# EAGLE schematic debug_backplane (EAGLE 8.3.1), part 1 of 2
AUTHOR: Joshua Adkins and Pat Pannuto; REV: D; TITLE: Signpost Debug Backplane

## Sheet 1 of 18: Controller Module & Misc
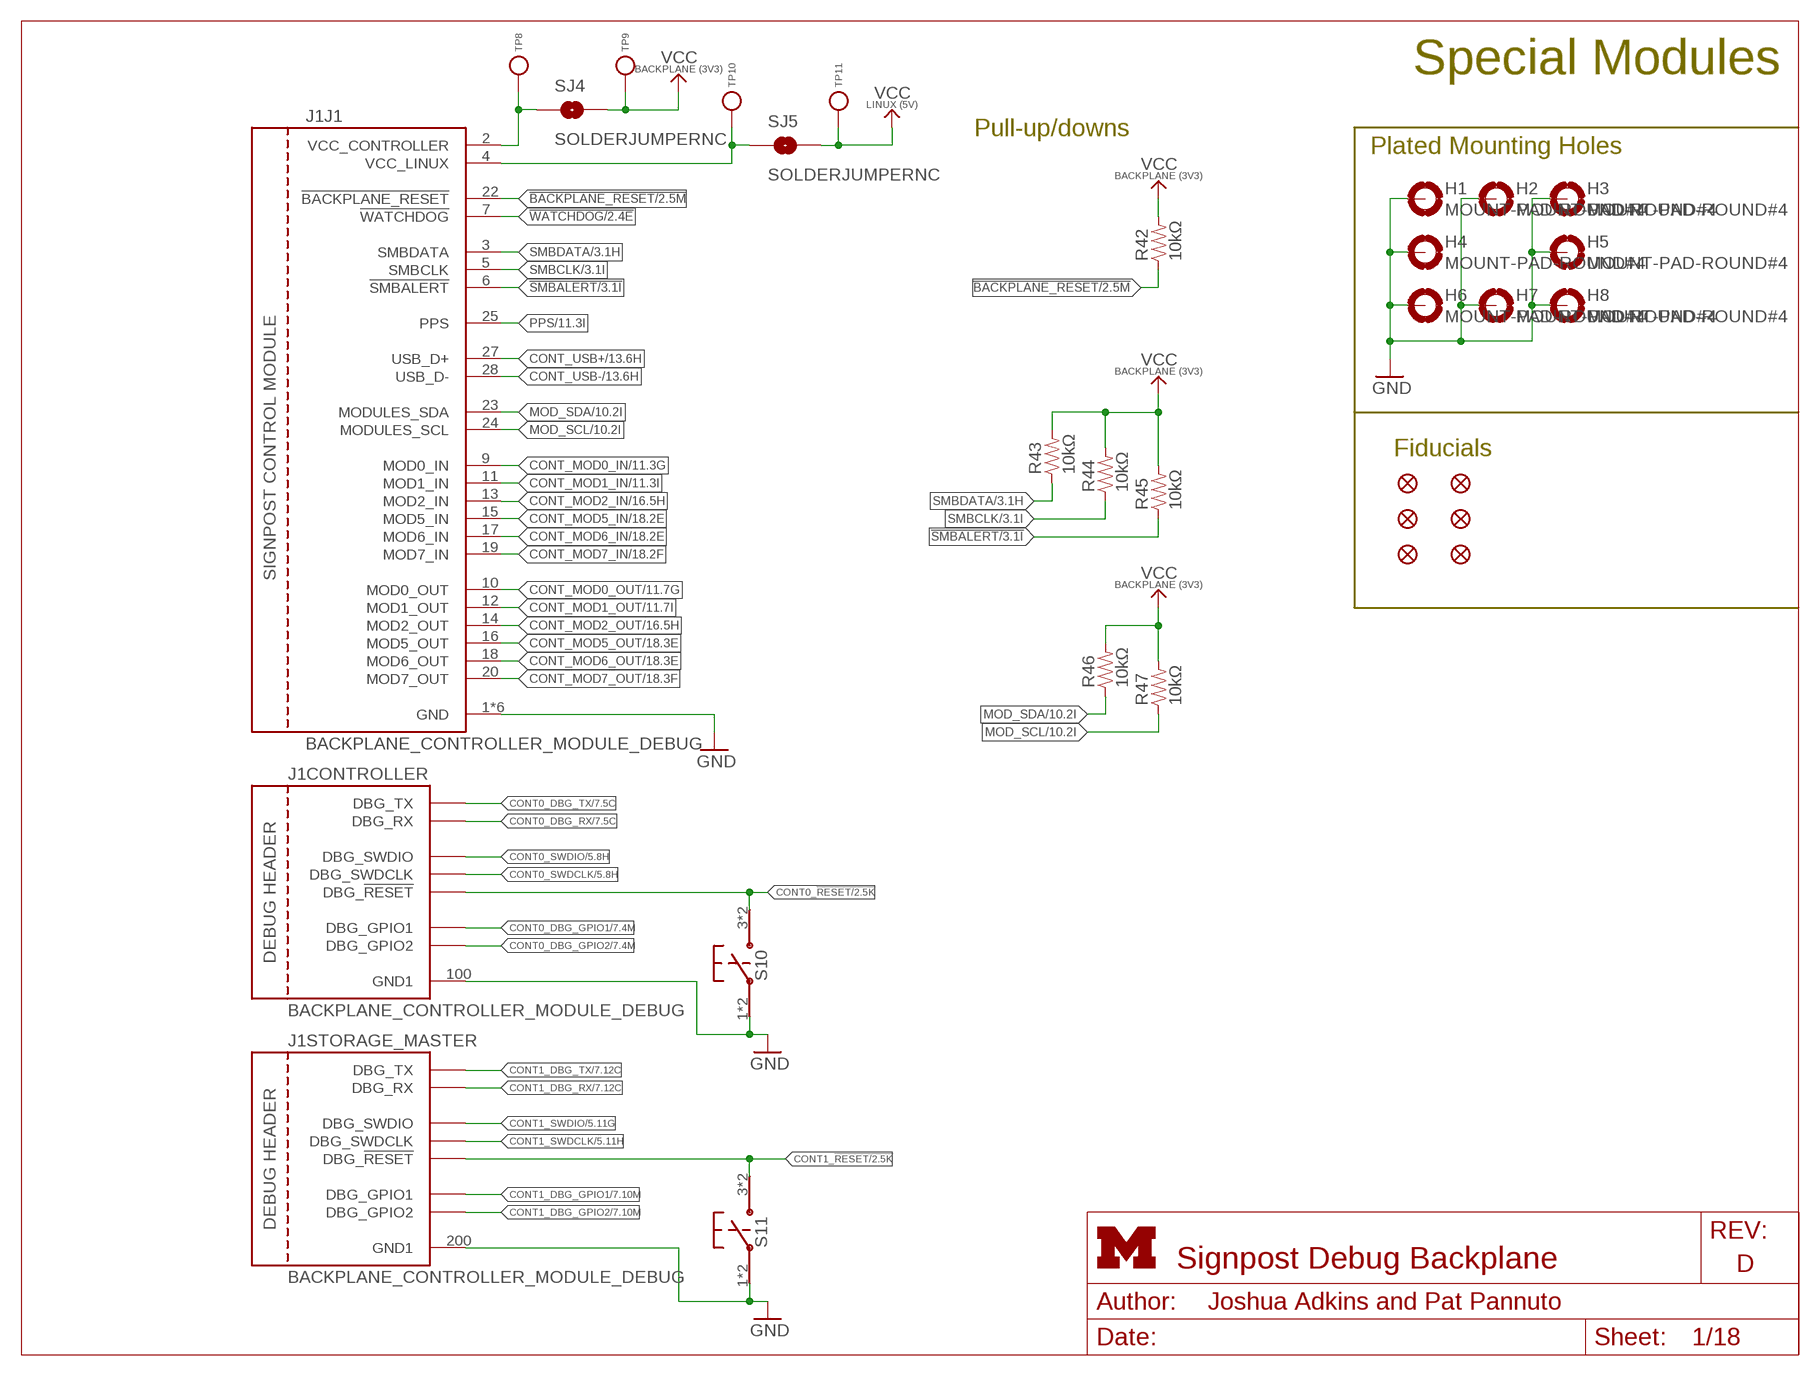
[diagram p0: schematic, sheet 1]
FRAME1 (LETTER_L_UMICH): HEIGHT: 8.5in; WIDTH: 11in

### Parts
H1  MOUNT-PAD-ROUND#4  [#4-PAD]
H2  MOUNT-PAD-ROUND#4  [#4-PAD]
H3  MOUNT-PAD-ROUND#4  [#4-PAD]
H4  MOUNT-PAD-ROUND#4  [#4-PAD]
H5  MOUNT-PAD-ROUND#4  [#4-PAD]
H6  MOUNT-PAD-ROUND#4  [#4-PAD]
H7  MOUNT-PAD-ROUND#4  [#4-PAD]
H8  MOUNT-PAD-ROUND#4  [#4-PAD]
J1  BACKPLANE_CONTROLLER_MODULE_DEBUG  [BACKPLANE_MODULE_20PIN_10PIN_DEBUG]
JP15  FIDUCIAL1X2  [FIDUCIAL-1X2]
JP21  FIDUCIAL1X2  [FIDUCIAL-1X2]
JP22  FIDUCIAL1X2  [FIDUCIAL-1X2]
JP23  FIDUCIAL1X2  [FIDUCIAL-1X2]
JP24  FIDUCIAL1X2  [FIDUCIAL-1X2]
JP25  FIDUCIAL1X2  [FIDUCIAL-1X2]
R42  10kΩ  RESISTOR0603_RES  [0603-RES]
R43  10kΩ  RESISTOR0603_RES  [0603-RES]
R44  10kΩ  RESISTOR0603_RES  [0603-RES]
R45  10kΩ  RESISTOR0603_RES  [0603-RES]
R46  10kΩ  RESISTOR0603_RES  [0603-RES]
R47  10kΩ  RESISTOR0603_RES  [0603-RES]
S10  PTS645SM43SMTR92  [PTS645]
S11  PTS645SM43SMTR92  [PTS645]
SJ4  SOLDERJUMPERNC  [SJ_2S]
SJ5  SOLDERJUMPERNC  [SJ_2S]
TP8  TEST_POINT_0.040IN  [TESTPOINT_0.040IN]
TP9  TEST_POINT_0.040IN  [TESTPOINT_0.040IN]
TP10  TEST_POINT_0.040IN  [TESTPOINT_0.040IN]
TP11  TEST_POINT_0.040IN  [TESTPOINT_0.040IN]

### Nets
!BACKPLANE_RESET: J1.22(J1:!BACKPLANE_RESET) R42.1 ; also sheet 2,9,12,18
!SMBALERT: J1.6(J1:!SMBALERT) R45.1 ; also sheet 3,18
!WATCHDOG: J1.7(J1:!WATCHDOG) ; also sheet 2,18
CONT0_!RESET: J1.105(CONTROLLER:DBG_!RESET) S10.3 S10.4 ; also sheet 2,5,18
CONT0_DBG_GPIO1: J1.101(CONTROLLER:DBG_GPIO1) ; also sheet 7,18
CONT0_DBG_GPIO2: J1.104(CONTROLLER:DBG_GPIO2) ; also sheet 7,18
CONT0_DBG_RX: J1.103(CONTROLLER:DBG_RX) ; also sheet 7,18
CONT0_DBG_TX: J1.102(CONTROLLER:DBG_TX) ; also sheet 7,18
CONT0_SWDCLK: J1.106(CONTROLLER:DBG_SWDCLK) ; also sheet 5
CONT0_SWDIO: J1.107(CONTROLLER:DBG_SWDIO) ; also sheet 5
CONT1_!RESET: J1.205(STORAGE_MASTER:DBG_!RESET) S11.3 S11.4 ; also sheet 2,5,18
CONT1_DBG_GPIO1: J1.201(STORAGE_MASTER:DBG_GPIO1) ; also sheet 7,18
CONT1_DBG_GPIO2: J1.204(STORAGE_MASTER:DBG_GPIO2) ; also sheet 7,18
CONT1_DBG_RX: J1.203(STORAGE_MASTER:DBG_RX) ; also sheet 7,18
CONT1_DBG_TX: J1.202(STORAGE_MASTER:DBG_TX) ; also sheet 7,18
CONT1_SWDCLK: J1.206(STORAGE_MASTER:DBG_SWDCLK) ; also sheet 5
CONT1_SWDIO: J1.207(STORAGE_MASTER:DBG_SWDIO) ; also sheet 5
CONT_MOD0_IN: J1.9(J1:MOD0_IN) ; also sheet 11,18
CONT_MOD0_OUT: J1.10(J1:MOD0_OUT) ; also sheet 11,18
CONT_MOD1_IN: J1.11(J1:MOD1_IN) ; also sheet 11,18
CONT_MOD1_OUT: J1.12(J1:MOD1_OUT) ; also sheet 11,18
CONT_MOD2_IN: J1.13(J1:MOD2_IN) ; also sheet 16,18
CONT_MOD2_OUT: J1.14(J1:MOD2_OUT) ; also sheet 16,18
CONT_MOD5_IN: J1.15(J1:MOD5_IN) ; also sheet 18
CONT_MOD5_OUT: J1.16(J1:MOD5_OUT) ; also sheet 18
CONT_MOD6_IN: J1.17(J1:MOD6_IN) ; also sheet 18
CONT_MOD6_OUT: J1.18(J1:MOD6_OUT) ; also sheet 18
CONT_MOD7_IN: J1.19(J1:MOD7_IN) ; also sheet 18
CONT_MOD7_OUT: J1.20(J1:MOD7_OUT) ; also sheet 18
CONT_USB+: J1.27(J1:USB_D+) ; also sheet 13
CONT_USB-: J1.28(J1:USB_D-) ; also sheet 13
GND: H1.B#4(MOUNT) H2.B#4(MOUNT) H3.B#4(MOUNT) H4.B#4(MOUNT) H5.B#4(MOUNT) H6.B#4(MOUNT) H7.B#4(MOUNT) H8.B#4(MOUNT) J1.1(J1:GND) J1.21(J1:GND) J1.100(CONTROLLER:GND1) J1.200(STORAGE_MASTER:GND1) J1.MNT1(J1:GND) J1.MNT2(J1:GND) J1.MNT3(J1:GND) J1.MNT4(J1:GND) S10.1 S10.2 S11.1 S11.2 ; also sheet 2,3,4,5,6,7,8,9,10,11,12,13,14,15,16,17,18
MOD_SCL: J1.24(J1:MODULES_SCL) R47.1 ; also sheet 10,16,18
MOD_SDA: J1.23(J1:MODULES_SDA) R46.1 ; also sheet 10,16,18
PPS: J1.25(J1:PPS) ; also sheet 11,16,18
SMBCLK: J1.5(J1:SMBCLK) R44.1 ; also sheet 3,9,12,17,18
SMBDATA: J1.3(J1:SMBDATA) R43.1 ; also sheet 3,9,12,17,18
VCC_BACKPLANE: R42.2 R43.2 R44.2 R45.2 R46.2 R47.2 SJ4.2 TP9.TESTPOINT ; also sheet 3,7,9,10,11,12,14,15,17,18
VCC_CONTROLLER_HEADER: J1.2(J1:VCC_CONTROLLER) SJ4.1 TP8.TESTPOINT
VCC_LINUX: SJ5.2 TP11.TESTPOINT ; also sheet 3,18
VCC_LINUX_HEADER: J1.4(J1:VCC_LINUX) SJ5.1 TP10.TESTPOINT

### Notes on the sheet
- Special Modules
- Pull-up/downs
- Plated Mounting Holes
- Fiducials

## Sheet 2 of 18: Watchdog & Reset Network
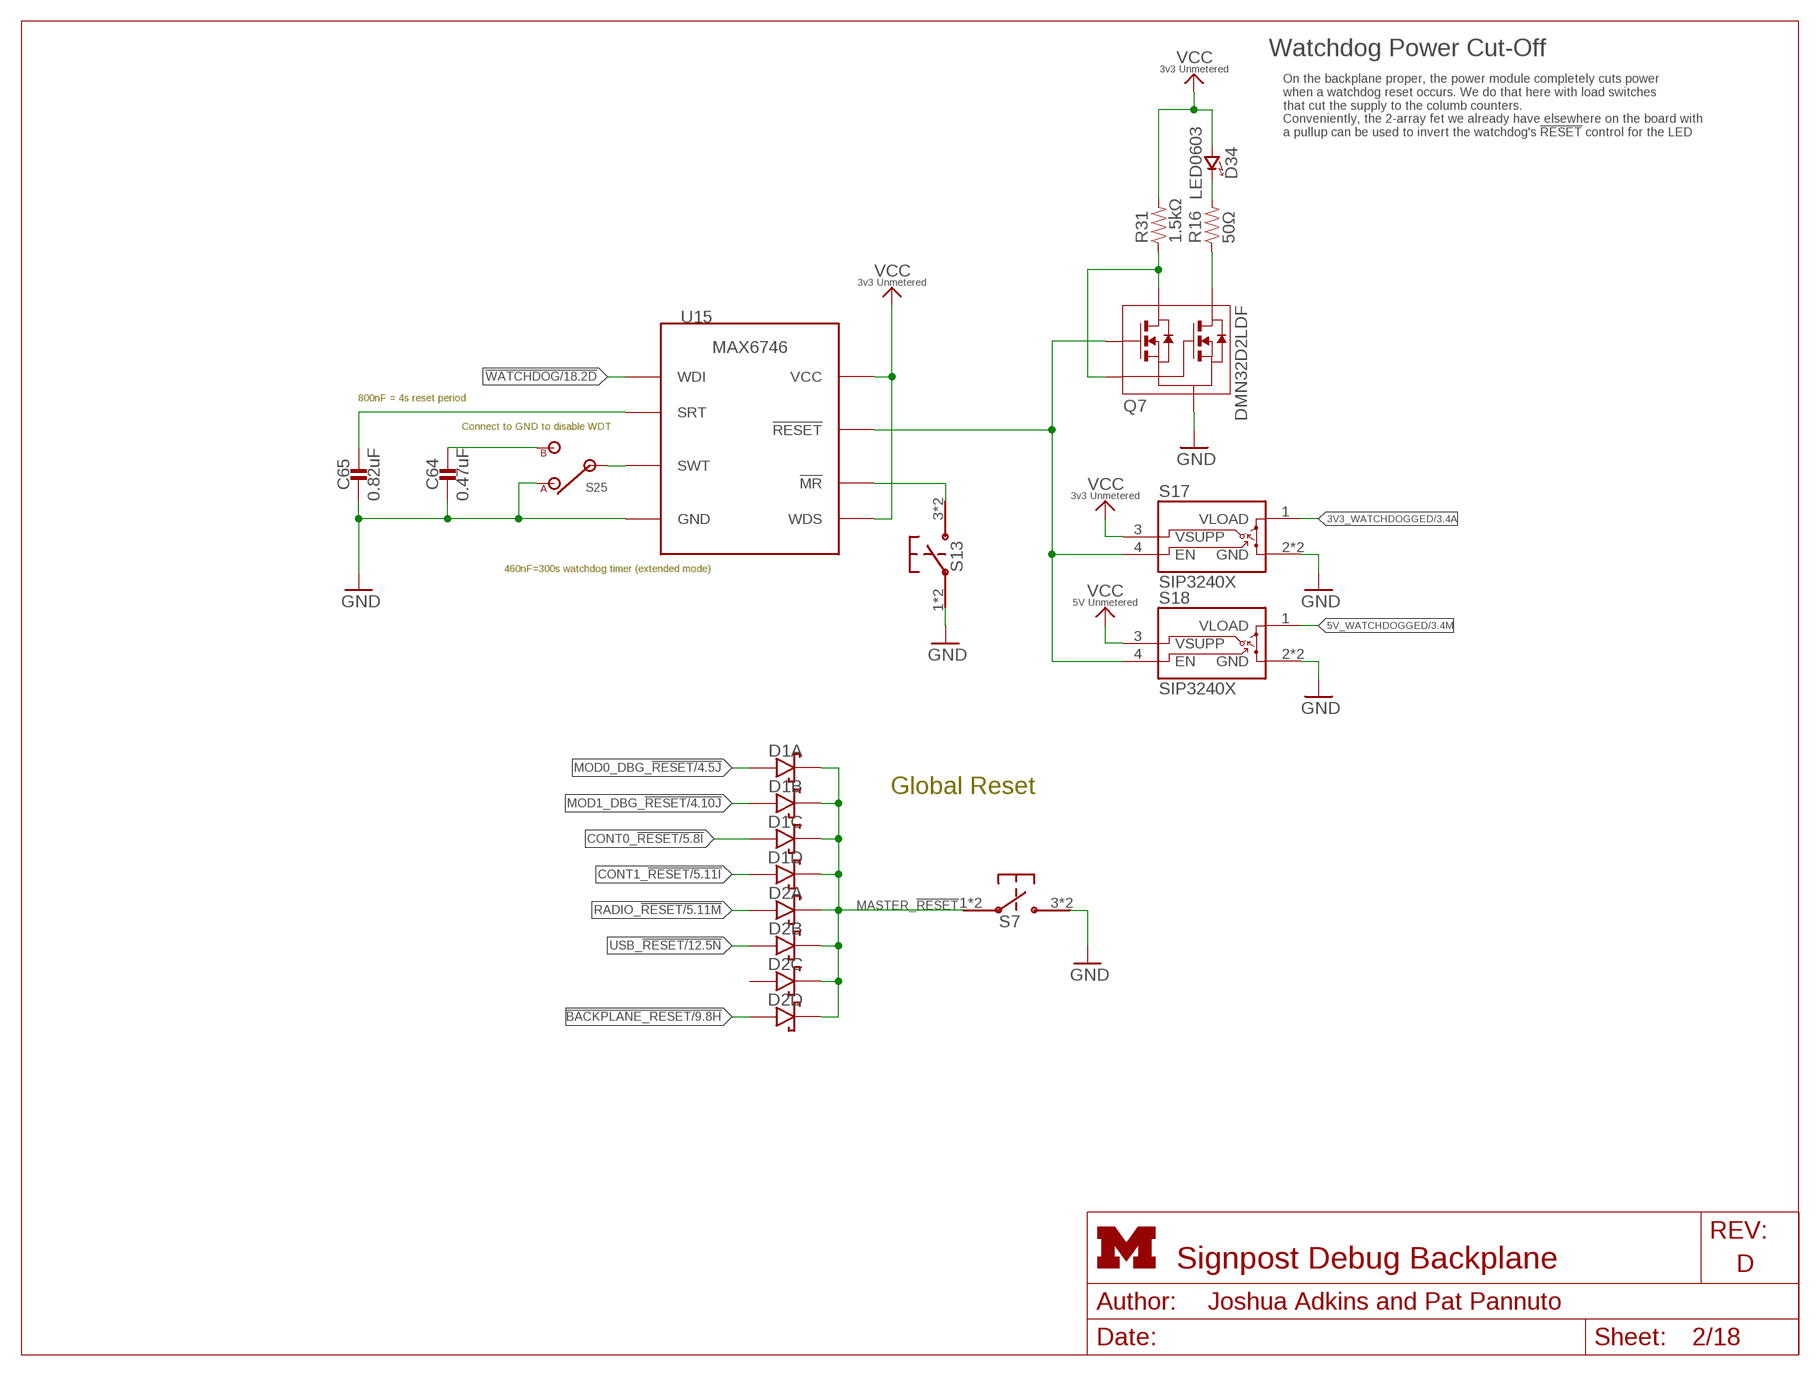
[diagram p1: schematic, sheet 2]
FRAME18 (LETTER_L_UMICH): HEIGHT: 8.5in; WIDTH: 11in

### Parts
C64  0.47uF  CAPACITOR0603_CAP  [0603_CAP]
C65  0.82uF  CAPACITOR0603_CAP  [0603_CAP]
D1  DIODE_SCHOTTKY_ARRAY-4HMD8  [HMD8]
D2  DIODE_SCHOTTKY_ARRAY-4HMD8  [HMD8]
D34  LED0603  [LED-0603]
Q7  DMN32D2LDF  [SOT353]
R16  50Ω  RESISTOR0603_RES  [0603-RES]
R31  1.5kΩ  RESISTOR0603_RES  [0603-RES]
S7  PTS645SM43SMTR92  [PTS645]
S13  PTS645SM43SMTR92  [PTS645]
S17  SIP3240X  [TDFN4]
S18  SIP3240X  [TDFN4]
S25  TE_SSA12/SPDT  [TE_SSA12/SPDT]
U15  MAX6746  [SOT-23-8]

### Nets
3V3_UNMETERED: D34.A(ANODE) R31.2 S17.3(VSUPP) U15.5(WDS) U15.8(VCC) ; supply symbol labelled VCC_3V3_UNMETERED ; also sheet 3,5,6,7,8,9,13,16,18
3V3_WATCHDOGGED: S17.1(VLOAD) ; also sheet 3
5V_UNMETERED: S18.3(VSUPP) ; supply symbol labelled VCC_5V_UNMETERED ; also sheet 3,6,7,16,18
5V_WATCHDOGGED: S18.1(VLOAD) ; also sheet 3
!BACKPLANE_RESET: D2.4A(D:ANODE) ; also sheet 1,9,12,18
!WATCHDOG: U15.6(WDI) ; also sheet 1,18
CONT0_!RESET: D1.3A(C:ANODE) ; also sheet 1,5,18
CONT1_!RESET: D1.4A(D:ANODE) ; also sheet 1,5,18
GND: C64.2 C65.2 Q7.S S7.3 S7.4 S13.1 S13.2 S17.2(GND) S17.PAD(GND) S18.2(GND) S18.PAD(GND) S25.1(A) U15.4(GND) ; also sheet 1,3,4,5,6,7,8,9,10,11,12,13,14,15,16,17,18
MASTER_!RESET: D1.1K(A:CATHODE) D1.2K(B:CATHODE) D1.3K(C:CATHODE) D1.4K(D:CATHODE) D2.1K(A:CATHODE) D2.2K(B:CATHODE) D2.3K(C:CATHODE) D2.4K(D:CATHODE) S7.1 S7.2
MOD0_DBG_!RESET: D1.1A(A:ANODE) ; also sheet 4,5,18
MOD1_DBG_!RESET: D1.2A(B:ANODE) ; also sheet 4,5,18
N$65: C65.1 U15.3(SRT)
N$78: Q7.D1 Q7.G2 R31.1
N$79: S13.3 S13.4 U15.1(!MR)
N$80: D34.C(CATHODE) R16.2
N$82: Q7.D2 R16.1
RADIO_!RESET: D2.1A(A:ANODE) ; also sheet 5,16
USB_!RESET: D2.2A(B:ANODE) ; also sheet 12,18
WATCHDOG_!RESET: Q7.G1 S17.4(EN) S18.4(EN) U15.7(!RESET)
WDT_CTRL: S25.IN U15.2(SWT)
WDT_ON: C64.1 S25.2(B)
Unconnected: D2.3A(C:ANODE)

### Notes on the sheet
- Watchdog Power Cut-Off
- On the backplane proper, the power module completely cuts power
  when a watchdog reset occurs. We do that here with load switches
  that cut the supply to the columb counters.
  Conveniently, the 2-array fet we already have elsewhere on the board with
  a pullup can be used to invert the watchdog's !RESET! control for the LED
- 800nF = 4s reset period
- Connect to GND to disable WDT
- 460nF=300s watchdog timer (extended mode)
- Global Reset

## Sheet 3 of 18: Power Module
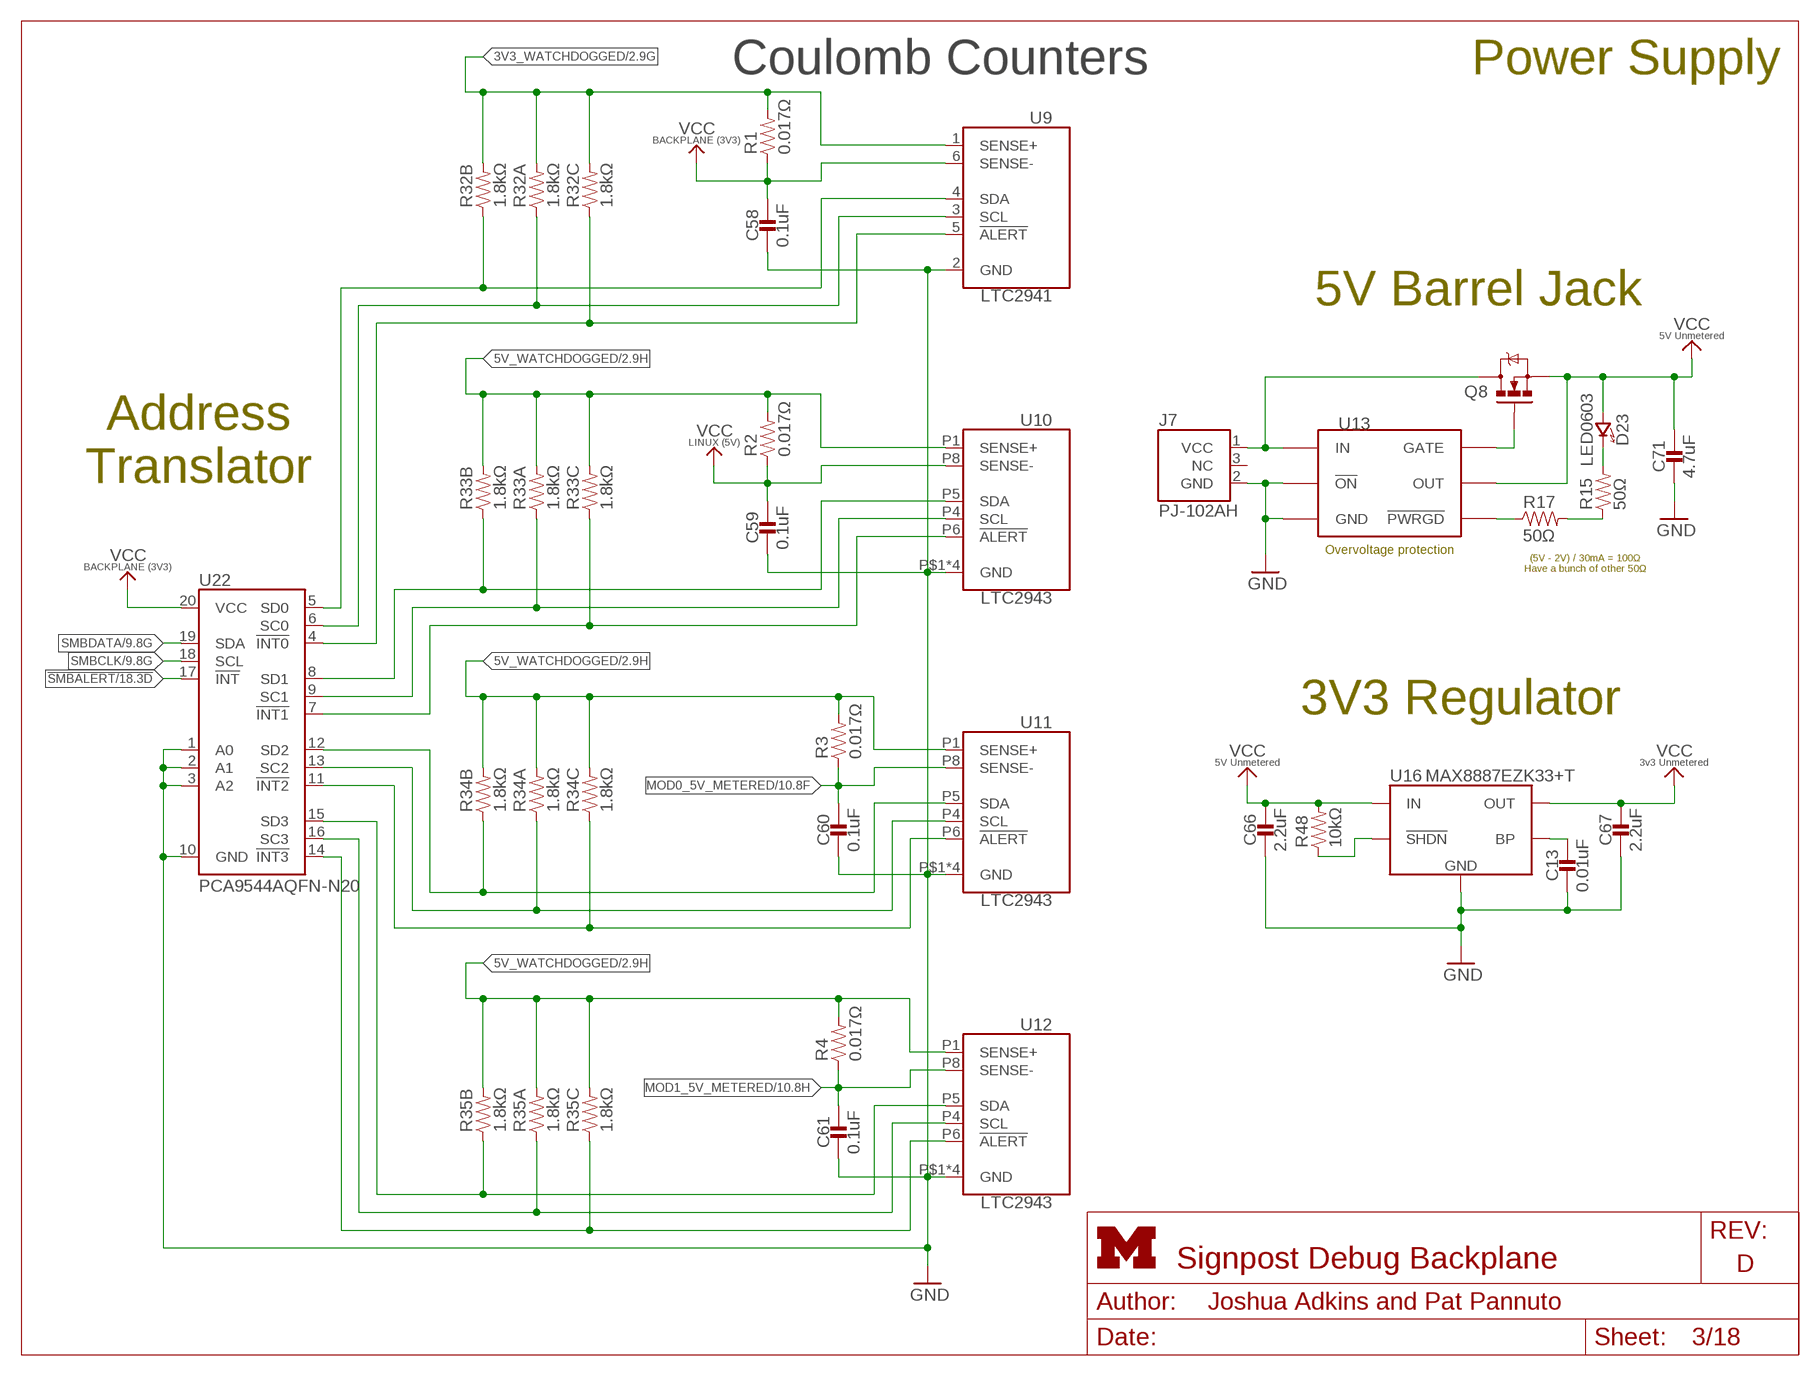
[diagram p2: schematic, sheet 3]
FRAME10 (LETTER_L_UMICH): HEIGHT: 8.5in; WIDTH: 11in

### Parts
C13  0.01uF  CAPACITOR0603_CAP  [0603_CAP]
C58  0.1uF  CAPACITOR0603_CAP  [0603_CAP]
C59  0.1uF  CAPACITOR0603_CAP  [0603_CAP]
C60  0.1uF  CAPACITOR0603_CAP  [0603_CAP]
C61  0.1uF  CAPACITOR0603_CAP  [0603_CAP]
C66  2.2uF  CAPACITOR0603_CAP  [0603_CAP]
C67  2.2uF  CAPACITOR0603_CAP  [0603_CAP]
C71  4.7uF  CAPACITOR0603_CAP  [0603_CAP]
D23  LED0603  [LED-0603]
J7  PJ-102AH  [PJ-102AH]
Q8  MOSFET-NCHANNELSMD  [SOT23-3]
R1  0.017Ω  RESISTOR0805_RES  [0805_RES]
R2  0.017Ω  RESISTOR0805_RES  [0805_RES]
R3  0.017Ω  RESISTOR0805_RES  [0805_RES]
R4  0.017Ω  RESISTOR0805_RES  [0805_RES]
R15  50Ω  RESISTOR0603_RES  [0603-RES]
R17  50Ω  RESISTOR0603_RES  [0603-RES]
R32  1.8kΩ  RESISTOR-ARRAY-41206  [ARRAY-CONVEX-0603-4]
R33  1.8kΩ  RESISTOR-ARRAY-41206  [ARRAY-CONVEX-0603-4]
R34  1.8kΩ  RESISTOR-ARRAY-41206  [ARRAY-CONVEX-0603-4]
R35  1.8kΩ  RESISTOR-ARRAY-41206  [ARRAY-CONVEX-0603-4]
R48  10kΩ  RESISTOR0603_RES  [0603-RES]
U9  LTC2941  [DFN-6-2MMX3MM]
U10  LTC2943  [DFN-8]
U11  LTC2943  [DFN-8]
U12  LTC2943  [DFN-8]
U13  LTC4360  [SC70-8]
U16  MAX8887EZK33+T  [SOT-23-5]
U22  PCA9544AQFN-N20  [QFN-N20]

### Nets
3V3_UNMETERED: C67.1 U16.5(OUT) ; supply symbol labelled VCC_3V3_UNMETERED ; also sheet 2,5,6,7,8,9,13,16,18
3V3_WATCHDOGGED: R1.2 R32.A2 R32.B2 R32.C2 U9.1(SENSE+) ; also sheet 2
5V_UNMETERED: C66.1 C71.1 D23.A(ANODE) Q8.2(S) R48.2 U13.7(OUT) U16.1(IN) ; supply symbol labelled VCC_5V_UNMETERED ; also sheet 2,6,7,16,18
5V_WATCHDOGGED: R2.2 R3.2 R4.2 R33.A2 R33.B2 R33.C2 R34.A2 R34.B2 R34.C2 R35.A2 R35.B2 R35.C2 U10.P1(SENSE+) U11.P1(SENSE+) U12.P1(SENSE+) ; also sheet 2
!SMBALERT: U22.17(!INT) ; also sheet 1,18
GND: C13.2 C58.2 C59.2 C60.2 C61.2 C66.2 C67.2 C71.2 J7.2(GND) U9.2(GND) U10.P2(GND) U10.P3(GND) U10.P7(GND) U10.P$1(GND) U11.P2(GND) U11.P3(GND) U11.P7(GND) U11.P$1(GND) U12.P2(GND) U12.P3(GND) U12.P7(GND) U12.P$1(GND) U13.2(GND) U13.3(GND) U13.4(GND) U13.6(!ON) U16.2(GND) U22.1(A0) U22.2(A1) U22.3(A2) U22.10(GND) ; also sheet 1,2,4,5,6,7,8,9,10,11,12,13,14,15,16,17,18
MOD0_5V_METERED: C60.1 R3.1 U11.P8(SENSE-) ; also sheet 10,15,18
MOD1_5V_METERED: C61.1 R4.1 U12.P8(SENSE-) ; also sheet 10,15,18
N$4: R48.1 U16.3(!SHDN)
N$7: C13.1 U16.4(BP)
N$43: R32.B1 U9.4(SDA) U22.5(SD0)
N$47: R32.A1 U9.3(SCL) U22.6(SC0)
N$52: R34.B1 U11.P5(SDA) U22.12(SD2)
N$53: R34.A1 U11.P4(SCL) U22.13(SC2)
N$54: R34.C1 U11.P6(!ALERT) U22.11(!INT2)
N$55: R35.B1 U12.P5(SDA) U22.15(SD3)
N$56: R35.A1 U12.P4(SCL) U22.16(SC3)
N$57: R35.C1 U12.P6(!ALERT) U22.14(!INT3)
N$67: R32.C1 U9.5(!ALERT) U22.4(!INT0)
N$68: R33.B1 U10.P5(SDA) U22.8(SD1)
N$70: R33.A1 U10.P4(SCL) U22.9(SC1)
N$71: R33.C1 U10.P6(!ALERT) U22.7(!INT1)
N$83: R17.1 U13.5(!PWRGD)
N$84: R15.1 R17.2
N$85: D23.C(CATHODE) R15.2
OVERVOLT_PROT_CTL: Q8.1(G) U13.8(GATE)
SMBCLK: U22.18(SCL) ; also sheet 1,9,12,17,18
SMBDATA: U22.19(SDA) ; also sheet 1,9,12,17,18
VCC_BACKPLANE: C58.1 R1.1 U9.6(SENSE-) U22.20(VCC) ; also sheet 1,7,9,10,11,12,14,15,17,18
VCC_BARRELJACK: J7.1(VCC) Q8.3(D) U13.1(IN)
VCC_LINUX: C59.1 R2.1 U10.P8(SENSE-) ; also sheet 1,18
Unconnected: J7.3(NC) R32.D1 R32.D2 R33.D1 R33.D2 R34.D1 R34.D2 R35.D1 R35.D2

### Notes on the sheet
- Power Supply
- Coulomb Counters
- 5V Barrel Jack
- Address
  Translator
- Overvoltage protection
- (5V - 2V) / 30mA = 100Ω
  Have a bunch of other 50Ω
- 3V3 Regulator

## Sheet 4 of 18: Generic Module Headers
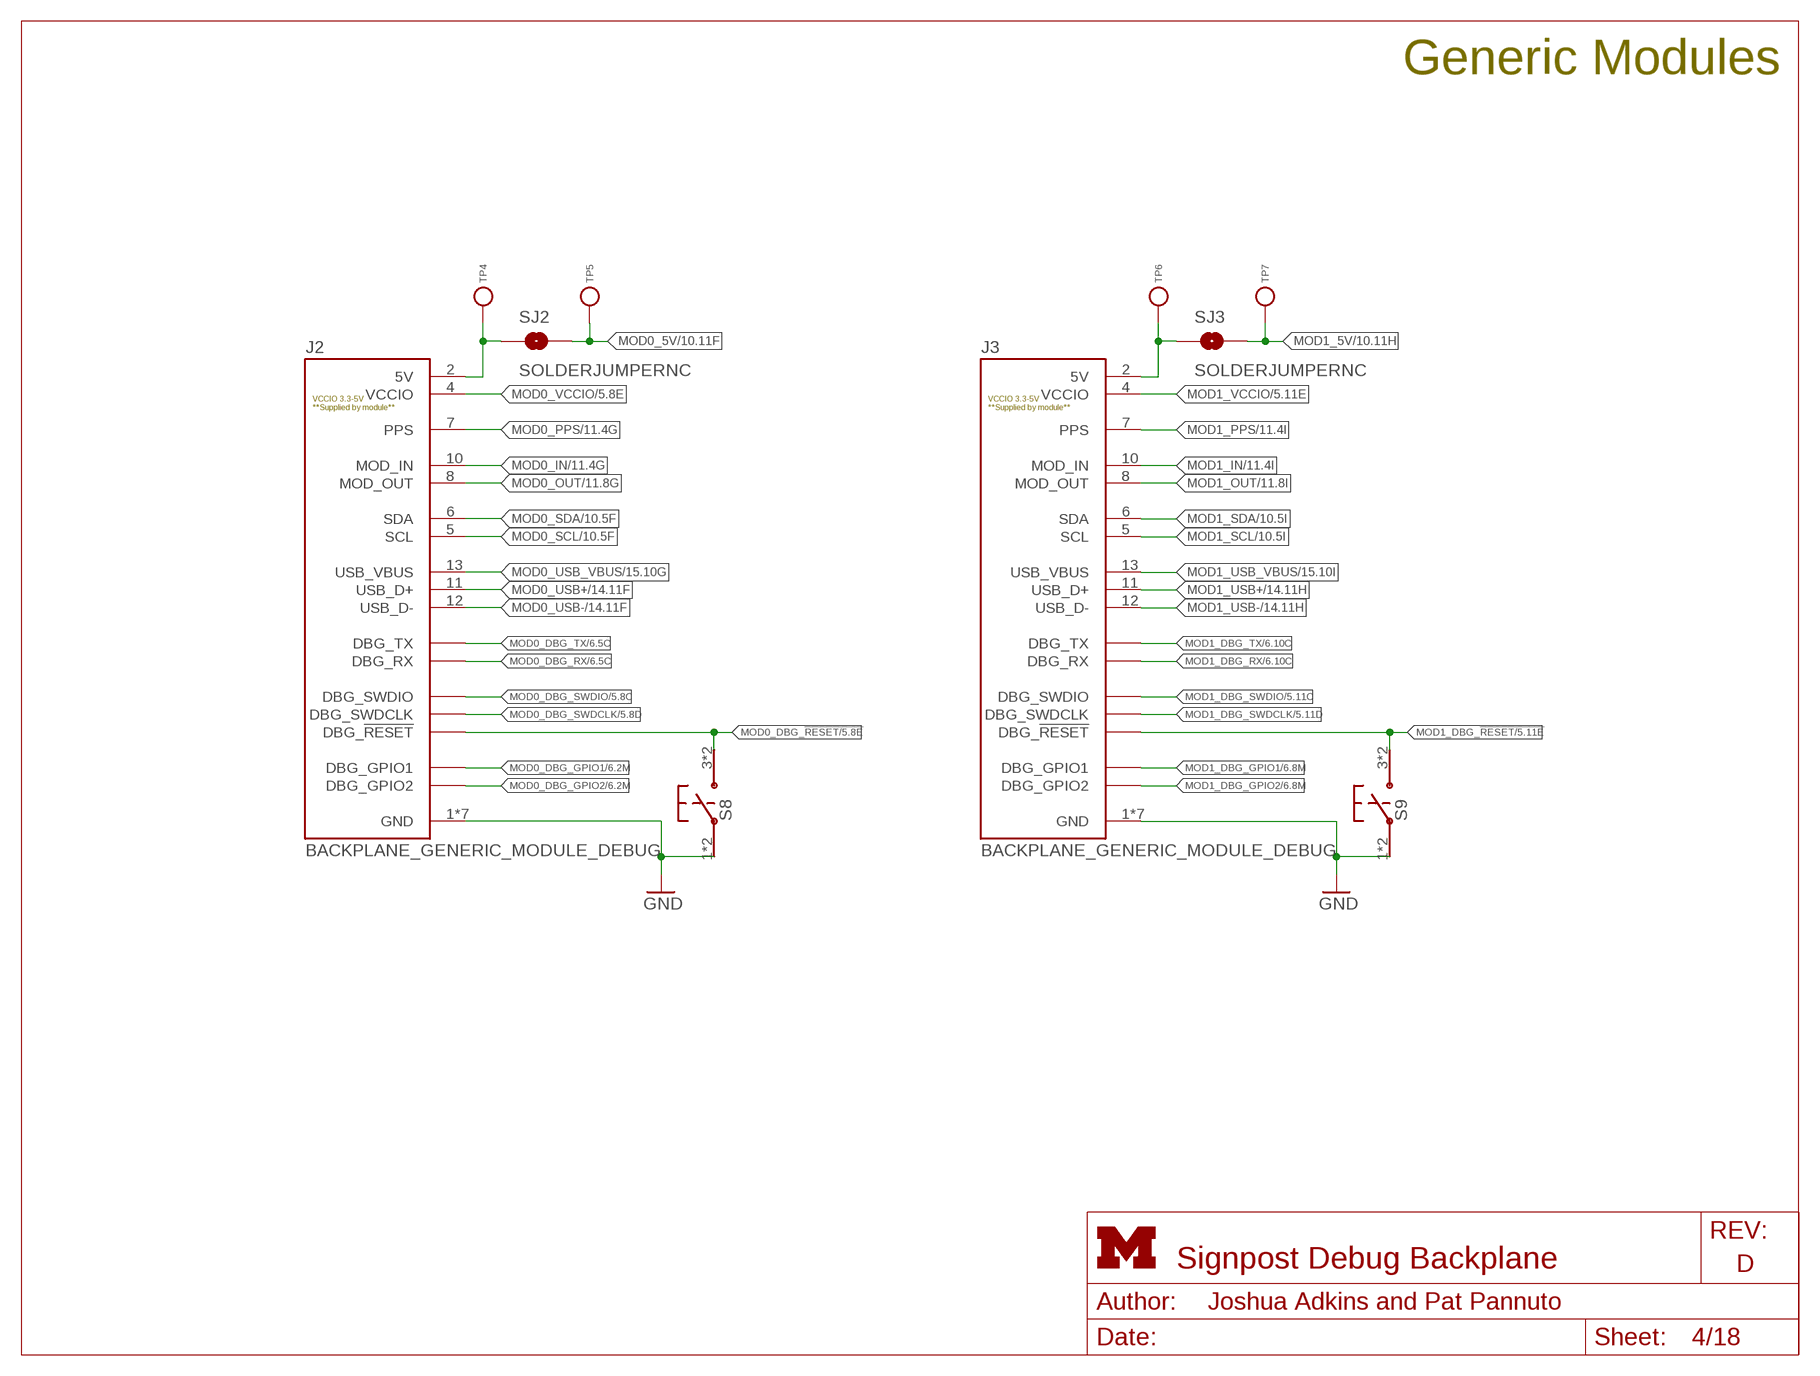
[diagram p3: schematic, sheet 4]
FRAME2 (LETTER_L_UMICH): HEIGHT: 8.5in; WIDTH: 11in

### Parts
J2  BACKPLANE_GENERIC_MODULE_DEBUG  [BACKPLANE_MODULE_14PIN_8PIN]
J3  BACKPLANE_GENERIC_MODULE_DEBUG  [BACKPLANE_MODULE_14PIN_8PIN]
S8  PTS645SM43SMTR92  [PTS645]
S9  PTS645SM43SMTR92  [PTS645]
SJ2  SOLDERJUMPERNC  [SJ_2S]
SJ3  SOLDERJUMPERNC  [SJ_2S]
TP4  TEST_POINT_0.040IN  [TESTPOINT_0.040IN]
TP5  TEST_POINT_0.040IN  [TESTPOINT_0.040IN]
TP6  TEST_POINT_0.040IN  [TESTPOINT_0.040IN]
TP7  TEST_POINT_0.040IN  [TESTPOINT_0.040IN]

### Nets
GND: J2.1(GND) J2.14(GND) J2.15(GND) J2.MNT1(GND) J2.MNT2(GND) J2.MNT3(GND) J2.MNT4(GND) J3.1(GND) J3.14(GND) J3.15(GND) J3.MNT1(GND) J3.MNT2(GND) J3.MNT3(GND) J3.MNT4(GND) S8.1 S8.2 S9.1 S9.2 ; also sheet 1,2,3,5,6,7,8,9,10,11,12,13,14,15,16,17,18
MOD0_5V: SJ2.2 TP5.TESTPOINT ; also sheet 10,18
MOD0_5V_HEADER: J2.2(5V) SJ2.1 TP4.TESTPOINT
MOD0_DBG_!RESET: J2.20(DBG_!RESET) S8.3 S8.4 ; also sheet 2,5,18
MOD0_DBG_GPIO1: J2.16(DBG_GPIO1) ; also sheet 6,18
MOD0_DBG_GPIO2: J2.19(DBG_GPIO2) ; also sheet 6,18
MOD0_DBG_RX: J2.18(DBG_RX) ; also sheet 6,18
MOD0_DBG_SWDCLK: J2.21(DBG_SWDCLK) ; also sheet 5
MOD0_DBG_SWDIO: J2.22(DBG_SWDIO) ; also sheet 5
MOD0_DBG_TX: J2.17(DBG_TX) ; also sheet 6,18
MOD0_IN: J2.10(MOD_IN) ; also sheet 11,18
MOD0_OUT: J2.8(MOD_OUT) ; also sheet 11,18
MOD0_PPS: J2.7(PPS) ; also sheet 11,18
MOD0_SCL: J2.5(SCL) ; also sheet 10,18
MOD0_SDA: J2.6(SDA) ; also sheet 10,18
MOD0_USB+: J2.11(USB_D+) ; also sheet 14
MOD0_USB-: J2.12(USB_D-) ; also sheet 14
MOD0_USB_VBUS: J2.13(USB_VBUS) ; also sheet 15,18
MOD0_VCCIO: J2.4(VCCIO) ; also sheet 5,6,10,11,18
MOD1_5V: SJ3.2 TP7.TESTPOINT ; also sheet 10,18
MOD1_5V_HEADER: J3.2(5V) SJ3.1 TP6.TESTPOINT
MOD1_DBG_!RESET: J3.20(DBG_!RESET) S9.3 S9.4 ; also sheet 2,5,18
MOD1_DBG_GPIO1: J3.16(DBG_GPIO1) ; also sheet 6,18
MOD1_DBG_GPIO2: J3.19(DBG_GPIO2) ; also sheet 6,18
MOD1_DBG_RX: J3.18(DBG_RX) ; also sheet 6,18
MOD1_DBG_SWDCLK: J3.21(DBG_SWDCLK) ; also sheet 5
MOD1_DBG_SWDIO: J3.22(DBG_SWDIO) ; also sheet 5
MOD1_DBG_TX: J3.17(DBG_TX) ; also sheet 6,18
MOD1_IN: J3.10(MOD_IN) ; also sheet 11,18
MOD1_OUT: J3.8(MOD_OUT) ; also sheet 11,18
MOD1_PPS: J3.7(PPS) ; also sheet 11,18
MOD1_SCL: J3.5(SCL) ; also sheet 10,18
MOD1_SDA: J3.6(SDA) ; also sheet 10,18
MOD1_USB+: J3.11(USB_D+) ; also sheet 14
MOD1_USB-: J3.12(USB_D-) ; also sheet 14
MOD1_USB_VBUS: J3.13(USB_VBUS) ; also sheet 15,18
MOD1_VCCIO: J3.4(VCCIO) ; also sheet 5,6,10,11,18

### Notes on the sheet
- Generic Modules

## Sheet 5 of 18: Octo-Prog
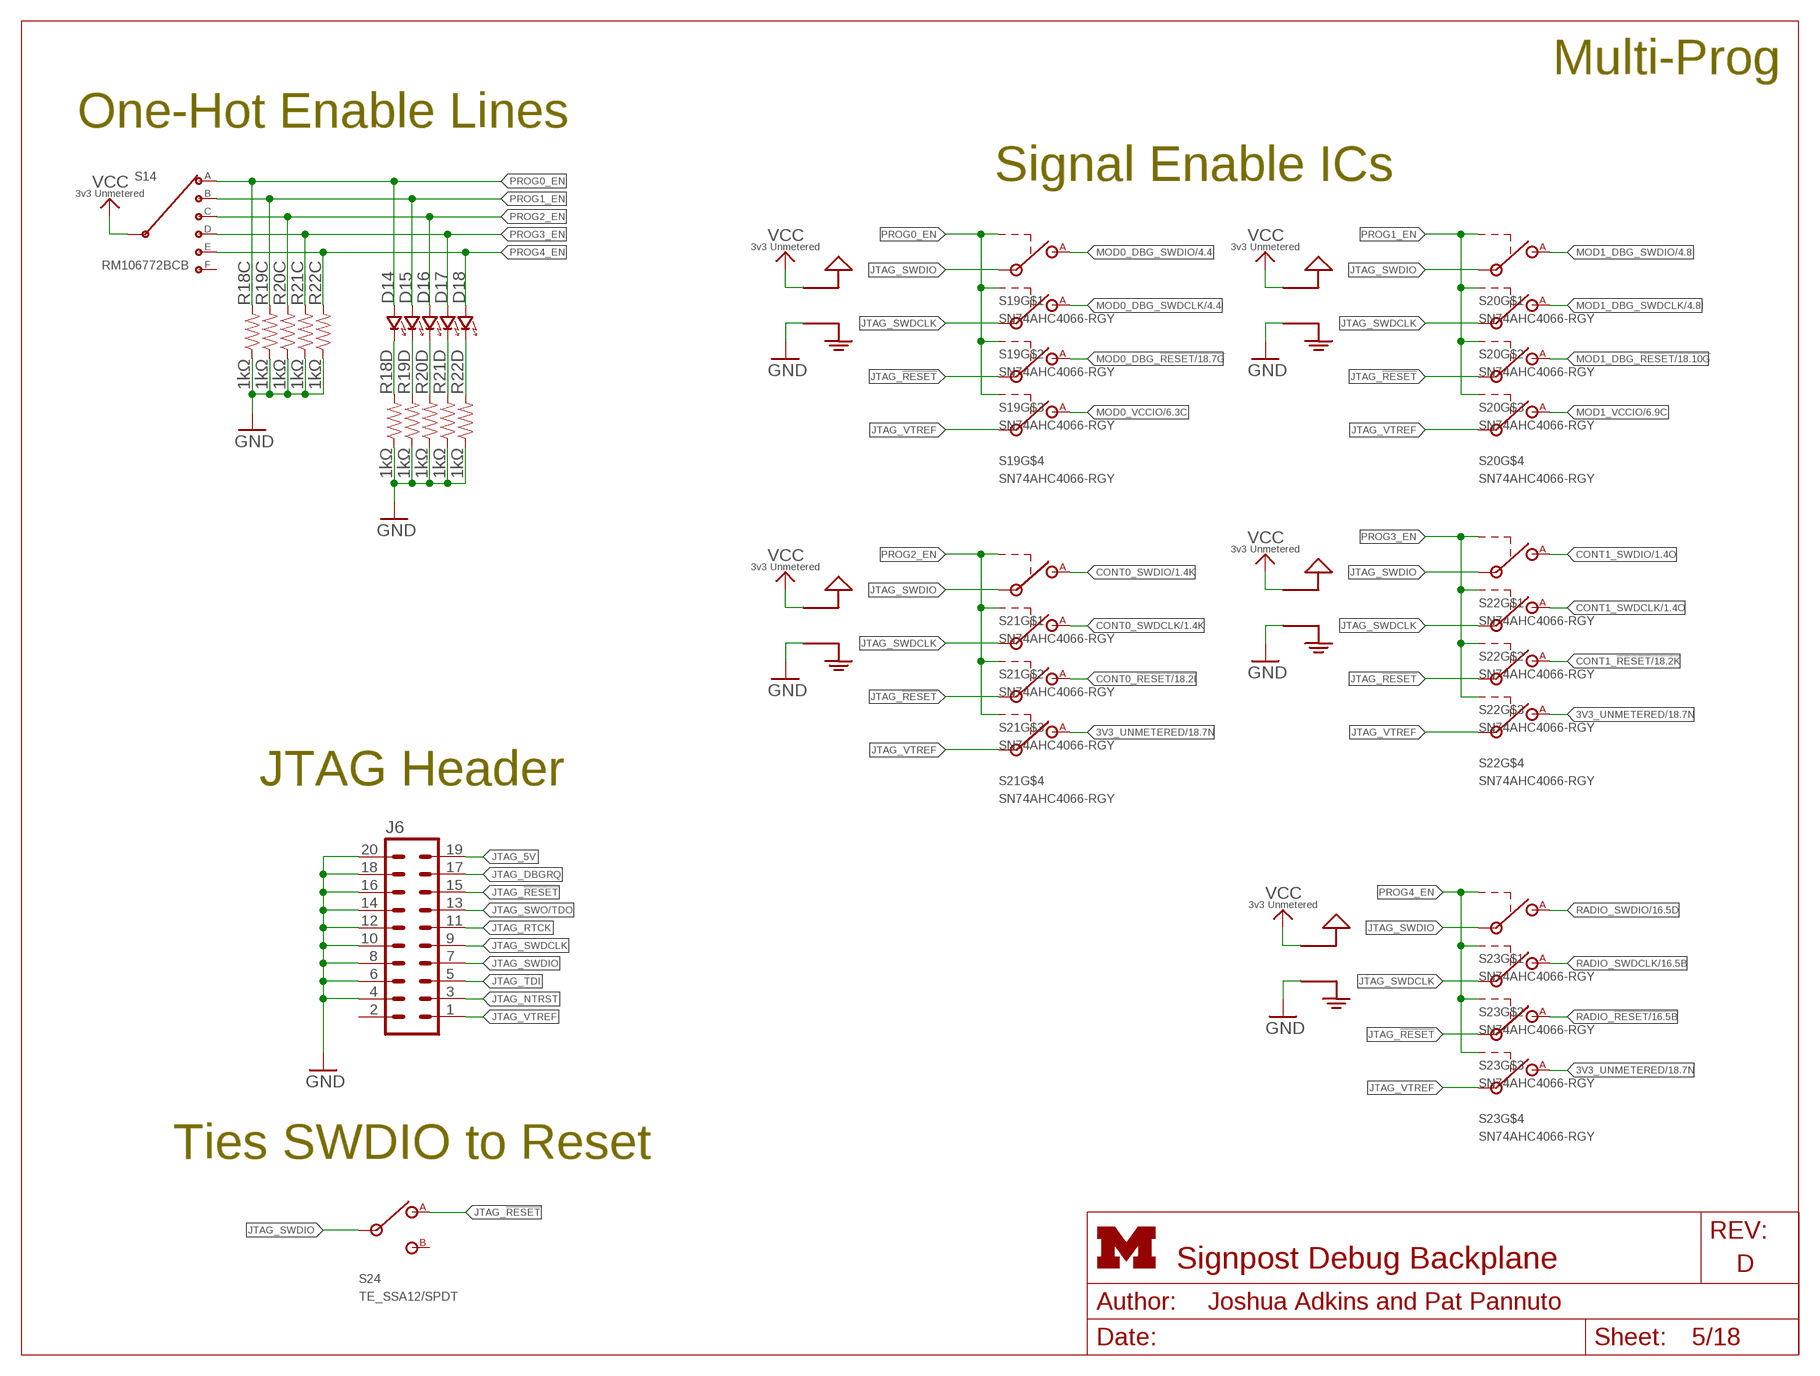
[diagram p4: schematic, sheet 5]
FRAME15 (LETTER_L_UMICH): HEIGHT: 8.5in; WIDTH: 11in

### Parts
D14  LED0603  [LED-0603]
D15  LED0603  [LED-0603]
D16  LED0603  [LED-0603]
D17  LED0603  [LED-0603]
D18  LED0603  [LED-0603]
J6  ML20  [ML20]
R18  1kΩ  RESISTOR-ARRAY-41206  [ARRAY-CONVEX-0603-4]
R19  1kΩ  RESISTOR-ARRAY-41206  [ARRAY-CONVEX-0603-4]
R20  1kΩ  RESISTOR-ARRAY-41206  [ARRAY-CONVEX-0603-4]
R21  1kΩ  RESISTOR-ARRAY-41206  [ARRAY-CONVEX-0603-4]
R22  1kΩ  RESISTOR-ARRAY-41206  [ARRAY-CONVEX-0603-4]
S14  RM106772BCB  [RM-SWITCH]
S19  SN74AHC4066-RGY  [S-PVQFN-N14-3.5MM]
S20  SN74AHC4066-RGY  [S-PVQFN-N14-3.5MM]
S21  SN74AHC4066-RGY  [S-PVQFN-N14-3.5MM]
S22  SN74AHC4066-RGY  [S-PVQFN-N14-3.5MM]
S23  SN74AHC4066-RGY  [S-PVQFN-N14-3.5MM]
S24  TE_SSA12/SPDT  [TE_SSA12/SPDT]

### Nets
3V3_UNMETERED: S14.C(INPUT) S19.14(VCC) S20.14(VCC) S21.10(A) S21.14(VCC) S22.10(A) S22.14(VCC) S23.10(A) S23.14(VCC) ; supply symbol labelled VCC_3V3_UNMETERED ; also sheet 2,3,6,7,8,9,13,16,18
CONT0_!RESET: S21.9(A) ; also sheet 1,2,18
CONT0_SWDCLK: S21.3(A) ; also sheet 1
CONT0_SWDIO: S21.2(A) ; also sheet 1
CONT1_!RESET: S22.9(A) ; also sheet 1,2,18
CONT1_SWDCLK: S22.3(A) ; also sheet 1
CONT1_SWDIO: S22.2(A) ; also sheet 1
GND: J6.4 J6.6 J6.8 J6.10 J6.12 J6.14 J6.16 J6.18 J6.20 R18.C1 R18.D1 R19.C1 R19.D1 R20.C1 R20.D1 R21.C1 R21.D1 R22.C1 R22.D1 S19.7(GND) S20.7(GND) S21.7(GND) S22.7(GND) S23.7(GND) ; also sheet 1,2,3,4,6,7,8,9,10,11,12,13,14,15,16,17,18
JTAG_5V: J6.19
JTAG_!RESET: J6.15 S19.8(IN) S20.8(IN) S21.8(IN) S22.8(IN) S23.8(IN) S24.1(A)
JTAG_DBGRQ: J6.17
JTAG_NTRST: J6.3
JTAG_RTCK: J6.11
JTAG_SWDCLK: J6.9 S19.4(IN) S20.4(IN) S21.4(IN) S22.4(IN) S23.4(IN)
JTAG_SWDIO: J6.7 S19.1(IN) S20.1(IN) S21.1(IN) S22.1(IN) S23.1(IN) S24.IN
JTAG_SWO/TDO: J6.13
JTAG_TDI: J6.5
JTAG_VTREF: J6.1 S19.11(IN) S20.11(IN) S21.11(IN) S22.11(IN) S23.11(IN)
MOD0_DBG_!RESET: S19.9(A) ; also sheet 2,4,18
MOD0_DBG_SWDCLK: S19.3(A) ; also sheet 4
MOD0_DBG_SWDIO: S19.2(A) ; also sheet 4
MOD0_VCCIO: S19.10(A) ; also sheet 4,6,10,11,18
MOD1_DBG_!RESET: S20.9(A) ; also sheet 2,4,18
MOD1_DBG_SWDCLK: S20.3(A) ; also sheet 4
MOD1_DBG_SWDIO: S20.2(A) ; also sheet 4
MOD1_VCCIO: S20.10(A) ; also sheet 4,6,10,11,18
N$28: D14.C(CATHODE) R18.D2
N$32: D15.C(CATHODE) R19.D2
N$35: D16.C(CATHODE) R20.D2
N$36: D17.C(CATHODE) R21.D2
N$42: D18.C(CATHODE) R22.D2
PROG0_EN: D14.A(ANODE) R18.C2 S14.1(A) S19.5(CTRL) S19.6(CTRL) S19.12(CTRL) S19.13(CTRL)
PROG1_EN: D15.A(ANODE) R19.C2 S14.2(B) S20.5(CTRL) S20.6(CTRL) S20.12(CTRL) S20.13(CTRL)
PROG2_EN: D16.A(ANODE) R20.C2 S14.3(C) S21.5(CTRL) S21.6(CTRL) S21.12(CTRL) S21.13(CTRL)
PROG3_EN: D17.A(ANODE) R21.C2 S14.4(D) S22.5(CTRL) S22.6(CTRL) S22.12(CTRL) S22.13(CTRL)
PROG4_EN: D18.A(ANODE) R22.C2 S14.5(E) S23.5(CTRL) S23.6(CTRL) S23.12(CTRL) S23.13(CTRL)
RADIO_!RESET: S23.9(A) ; also sheet 2,16
RADIO_SWDCLK: S23.3(A) ; also sheet 16
RADIO_SWDIO: S23.2(A) ; also sheet 16
Unconnected: J6.2 S14.6(F) S24.2(B)

### Notes on the sheet
- Multi-Prog
- One-Hot Enable Lines
- Signal Enable ICs
- JTAG Header
- Ties SWDIO to Reset

## Sheet 6 of 18: Module FTDI & Debug
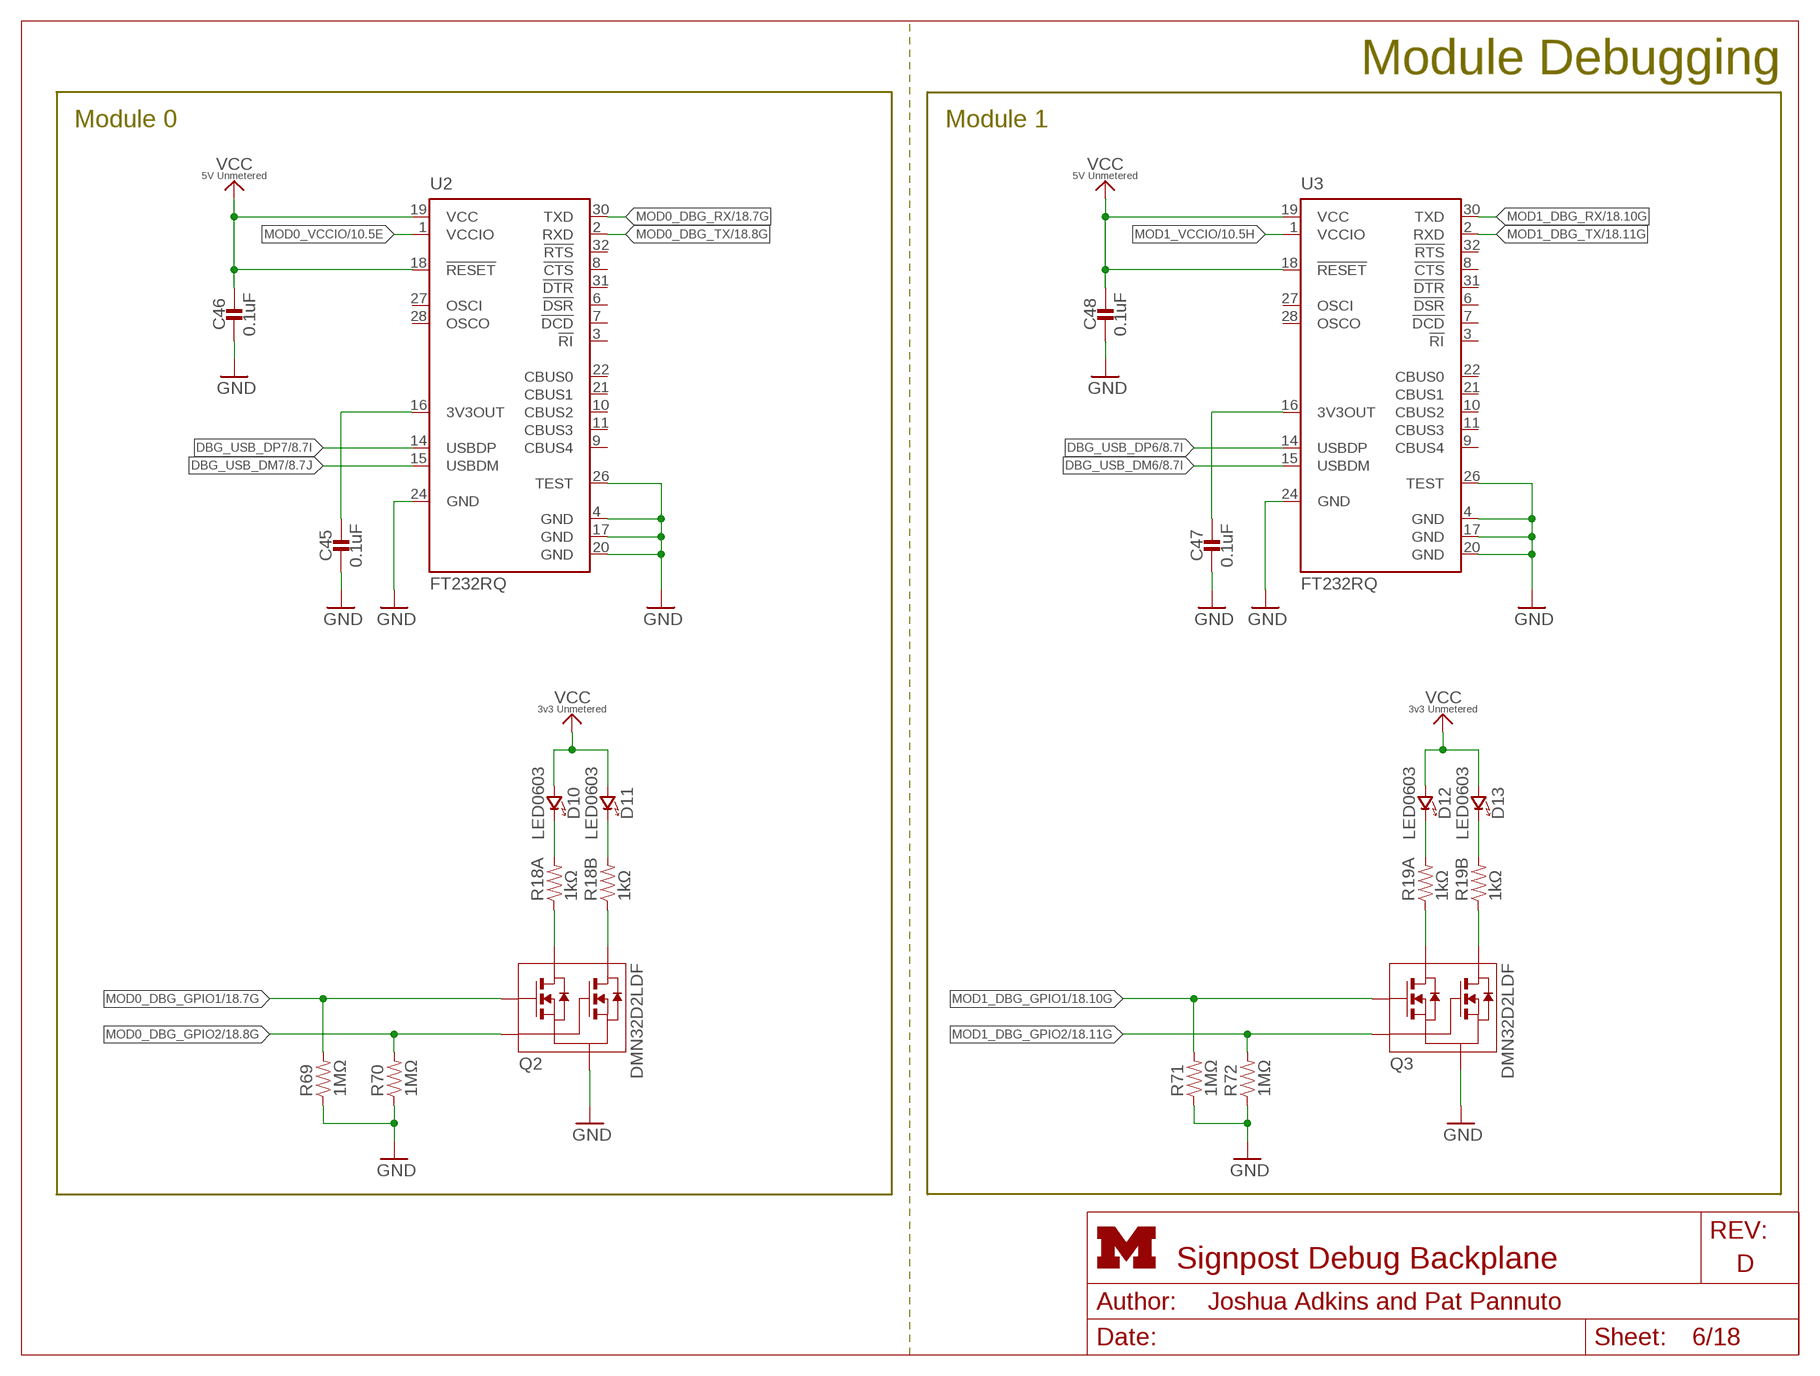
[diagram p5: schematic, sheet 6]
FRAME12 (LETTER_L_UMICH): HEIGHT: 8.5in; WIDTH: 11in

### Parts
C45  0.1uF  CAPACITOR0603_CAP  [0603_CAP]
C46  0.1uF  CAPACITOR0603_CAP  [0603_CAP]
C47  0.1uF  CAPACITOR0603_CAP  [0603_CAP]
C48  0.1uF  CAPACITOR0603_CAP  [0603_CAP]
D10  LED0603  [LED-0603]
D11  LED0603  [LED-0603]
D12  LED0603  [LED-0603]
D13  LED0603  [LED-0603]
Q2  DMN32D2LDF  [SOT353]
Q3  DMN32D2LDF  [SOT353]
R69  1MΩ  RESISTOR0603_RES  [0603-RES]
R70  1MΩ  RESISTOR0603_RES  [0603-RES]
R71  1MΩ  RESISTOR0603_RES  [0603-RES]
R72  1MΩ  RESISTOR0603_RES  [0603-RES]
U2  FT232RQ  [QFN32]
U3  FT232RQ  [QFN32]

### Nets
3V3_UNMETERED: D10.A(ANODE) D11.A(ANODE) D12.A(ANODE) D13.A(ANODE) ; supply symbol labelled VCC_3V3_UNMETERED ; also sheet 2,3,5,7,8,9,13,16,18
5V_UNMETERED: C46.1 C48.1 U2.18(!RESET) U2.19(VCC) U3.18(!RESET) U3.19(VCC) ; supply symbol labelled VCC_5V_UNMETERED ; also sheet 2,3,7,16,18
DBG_USB_DM6: U3.15(USBDM) ; also sheet 8
DBG_USB_DM7: U2.15(USBDM) ; also sheet 8
DBG_USB_DP6: U3.14(USBDP) ; also sheet 8
DBG_USB_DP7: U2.14(USBDP) ; also sheet 8
GND: C45.2 C46.2 C47.2 C48.2 Q2.S Q3.S R69.1 R70.1 R71.1 R72.1 U2.4(GND) U2.17(GND) U2.20(GND) U2.24(GND) U2.26(TEST) U3.4(GND) U3.17(GND) U3.20(GND) U3.24(GND) U3.26(TEST) ; also sheet 1,2,3,4,5,7,8,9,10,11,12,13,14,15,16,17,18
MOD0_DBG_GPIO1: Q2.G1 R69.2 ; also sheet 4,18
MOD0_DBG_GPIO2: Q2.G2 R70.2 ; also sheet 4,18
MOD0_DBG_RX: U2.30(TXD) ; also sheet 4,18
MOD0_DBG_TX: U2.2(RXD) ; also sheet 4,18
MOD0_VCCIO: U2.1(VCCIO) ; also sheet 4,5,10,11,18
MOD1_DBG_GPIO1: Q3.G1 R71.2 ; also sheet 4,18
MOD1_DBG_GPIO2: Q3.G2 R72.2 ; also sheet 4,18
MOD1_DBG_RX: U3.30(TXD) ; also sheet 4,18
MOD1_DBG_TX: U3.2(RXD) ; also sheet 4,18
MOD1_VCCIO: U3.1(VCCIO) ; also sheet 4,5,10,11,18
N$5: D10.C(CATHODE) R18.A2
N$6: D11.C(CATHODE) R18.B2
N$8: Q2.D1 R18.A1
N$9: Q2.D2 R18.B1
N$15: D12.C(CATHODE) R19.A2
N$16: D13.C(CATHODE) R19.B2
N$18: Q3.D1 R19.A1
N$19: Q3.D2 R19.B1
N$34: C45.1 U2.16(3V3OUT)
N$51: C47.1 U3.16(3V3OUT)
Unconnected: U2.3(!RI) U2.6(!DSR) U2.7(!DCD) U2.8(!CTS) U2.9(CBUS4) U2.10(CBUS2) U2.11(CBUS3) U2.21(CBUS1) U2.22(CBUS0) U2.27(OSCI) U2.28(OSCO) U2.31(!DTR) U2.32(!RTS) U3.3(!RI) U3.6(!DSR) U3.7(!DCD) U3.8(!CTS) U3.9(CBUS4) U3.10(CBUS2) U3.11(CBUS3) U3.21(CBUS1) U3.22(CBUS0) U3.27(OSCI) U3.28(OSCO) U3.31(!DTR) U3.32(!RTS)

### Notes on the sheet
- Module Debugging
- Module 0 | Module 1

## Sheet 7 of 18: Controller FTDI & Debug
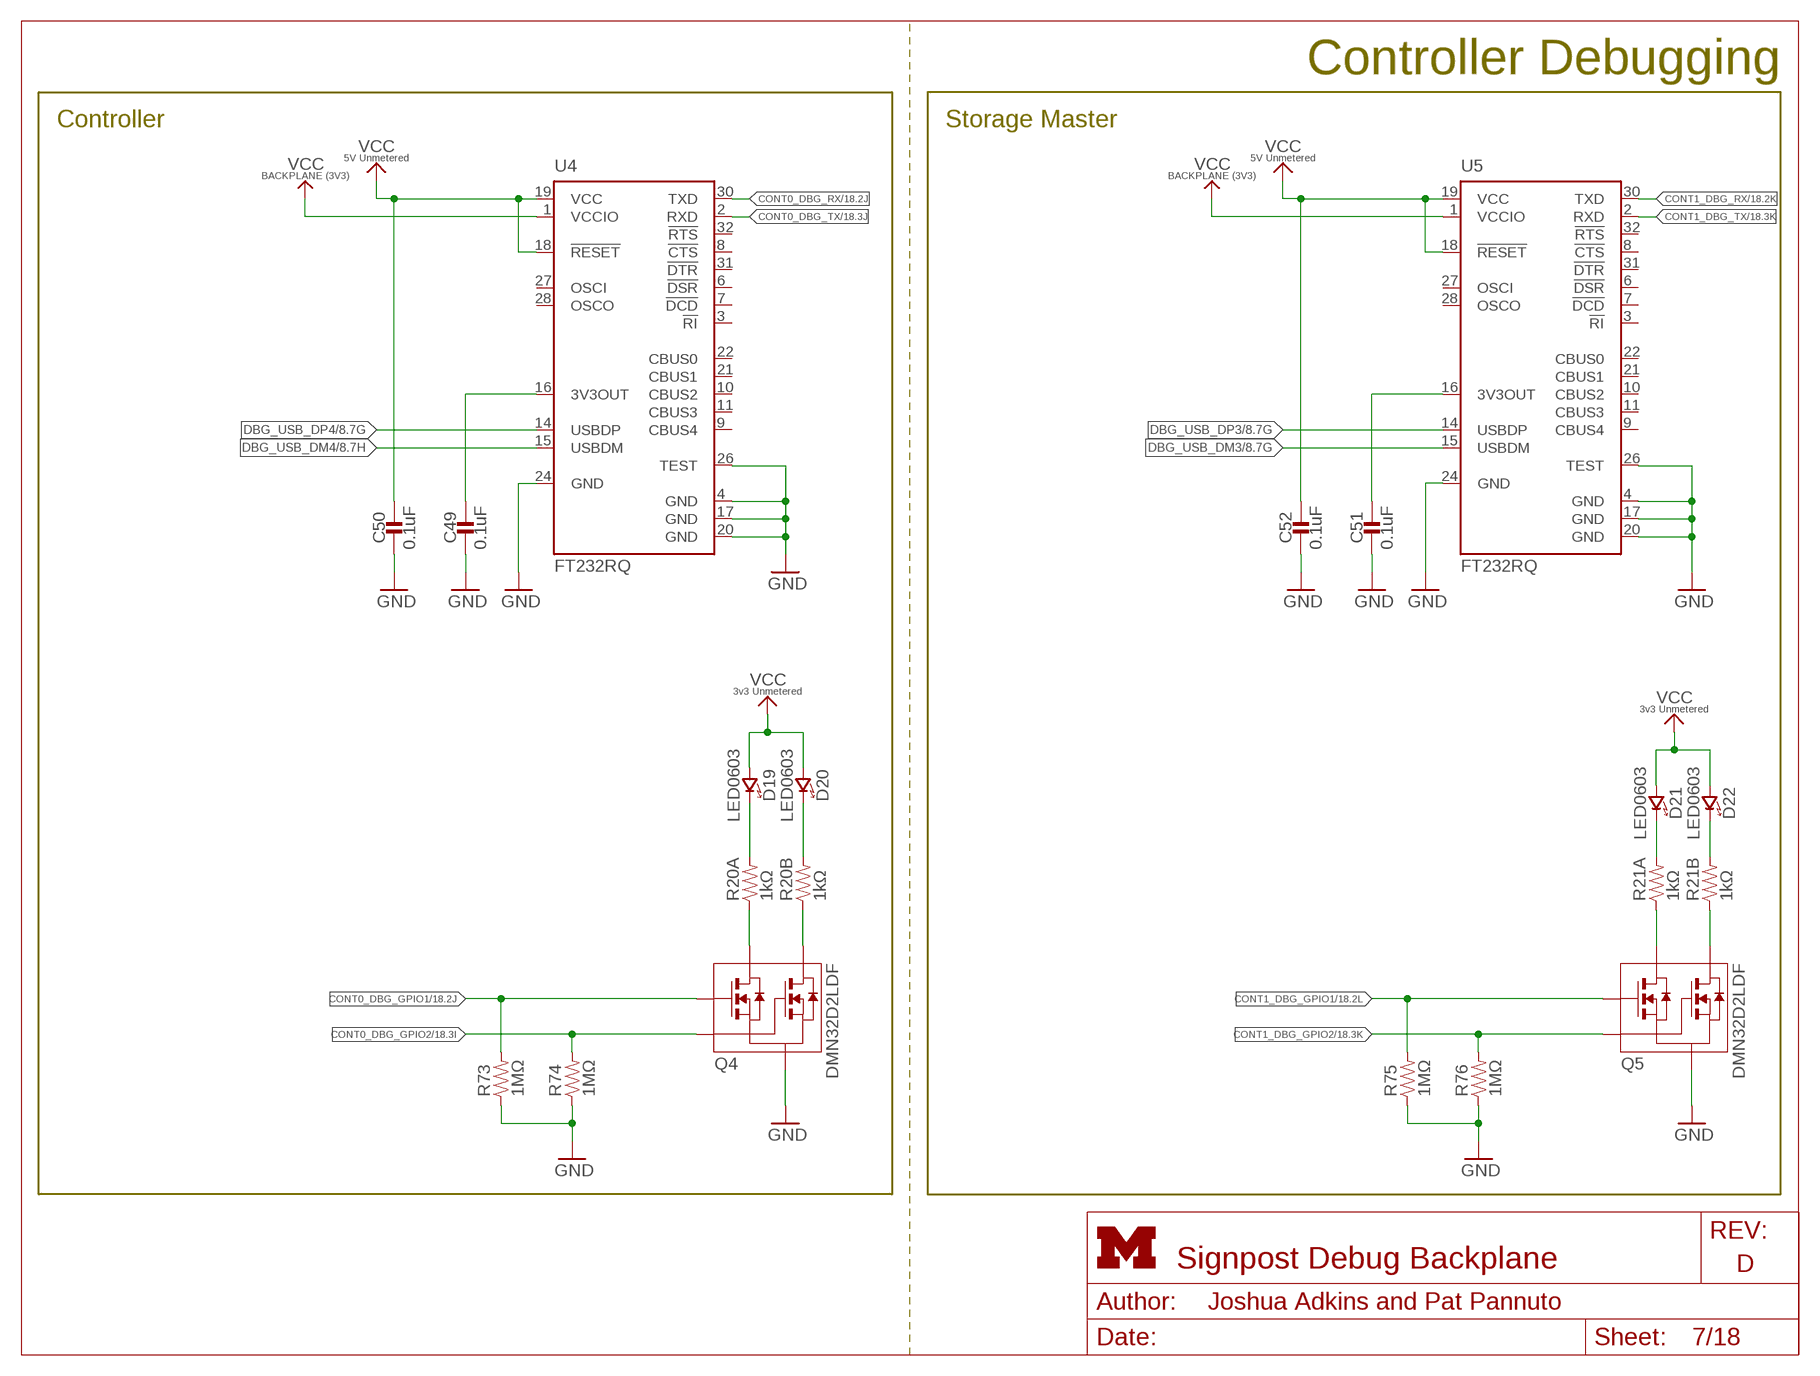
[diagram p6: schematic, sheet 7]
FRAME13 (LETTER_L_UMICH): HEIGHT: 8.5in; WIDTH: 11in

### Parts
C49  0.1uF  CAPACITOR0603_CAP  [0603_CAP]
C50  0.1uF  CAPACITOR0603_CAP  [0603_CAP]
C51  0.1uF  CAPACITOR0603_CAP  [0603_CAP]
C52  0.1uF  CAPACITOR0603_CAP  [0603_CAP]
D19  LED0603  [LED-0603]
D20  LED0603  [LED-0603]
D21  LED0603  [LED-0603]
D22  LED0603  [LED-0603]
Q4  DMN32D2LDF  [SOT353]
Q5  DMN32D2LDF  [SOT353]
R73  1MΩ  RESISTOR0603_RES  [0603-RES]
R74  1MΩ  RESISTOR0603_RES  [0603-RES]
R75  1MΩ  RESISTOR0603_RES  [0603-RES]
R76  1MΩ  RESISTOR0603_RES  [0603-RES]
U4  FT232RQ  [QFN32]
U5  FT232RQ  [QFN32]

### Nets
3V3_UNMETERED: D19.A(ANODE) D20.A(ANODE) D21.A(ANODE) D22.A(ANODE) ; supply symbol labelled VCC_3V3_UNMETERED ; also sheet 2,3,5,6,8,9,13,16,18
5V_UNMETERED: C50.1 C52.1 U4.18(!RESET) U4.19(VCC) U5.18(!RESET) U5.19(VCC) ; supply symbol labelled VCC_5V_UNMETERED ; also sheet 2,3,6,16,18
CONT0_DBG_GPIO1: Q4.G1 R73.2 ; also sheet 1,18
CONT0_DBG_GPIO2: Q4.G2 R74.2 ; also sheet 1,18
CONT0_DBG_RX: U4.30(TXD) ; also sheet 1,18
CONT0_DBG_TX: U4.2(RXD) ; also sheet 1,18
CONT0_VCCIO: C49.1 U4.16(3V3OUT)
CONT1_DBG_GPIO1: Q5.G1 R75.2 ; also sheet 1,18
CONT1_DBG_GPIO2: Q5.G2 R76.2 ; also sheet 1,18
CONT1_DBG_RX: U5.30(TXD) ; also sheet 1,18
CONT1_DBG_TX: U5.2(RXD) ; also sheet 1,18
CONT1_VCCIO: C51.1 U5.16(3V3OUT)
DBG_USB_DM3: U5.15(USBDM) ; also sheet 8
DBG_USB_DM4: U4.15(USBDM) ; also sheet 8
DBG_USB_DP3: U5.14(USBDP) ; also sheet 8
DBG_USB_DP4: U4.14(USBDP) ; also sheet 8
GND: C49.2 C50.2 C51.2 C52.2 Q4.S Q5.S R73.1 R74.1 R75.1 R76.1 U4.4(GND) U4.17(GND) U4.20(GND) U4.24(GND) U4.26(TEST) U5.4(GND) U5.17(GND) U5.20(GND) U5.24(GND) U5.26(TEST) ; also sheet 1,2,3,4,5,6,8,9,10,11,12,13,14,15,16,17,18
N$20: Q4.D1 R20.A1
N$22: Q4.D2 R20.B1
N$23: D21.C(CATHODE) R21.A2
N$24: D22.C(CATHODE) R21.B2
N$29: Q5.D1 R21.A1
N$30: Q5.D2 R21.B1
N$69: D19.C(CATHODE) R20.A2
N$72: D20.C(CATHODE) R20.B2
VCC_BACKPLANE: U4.1(VCCIO) U5.1(VCCIO) ; also sheet 1,3,9,10,11,12,14,15,17,18
Unconnected: U4.3(!RI) U4.6(!DSR) U4.7(!DCD) U4.8(!CTS) U4.9(CBUS4) U4.10(CBUS2) U4.11(CBUS3) U4.21(CBUS1) U4.22(CBUS0) U4.27(OSCI) U4.28(OSCO) U4.31(!DTR) U4.32(!RTS) U5.3(!RI) U5.6(!DSR) U5.7(!DCD) U5.8(!CTS) U5.9(CBUS4) U5.10(CBUS2) U5.11(CBUS3) U5.21(CBUS1) U5.22(CBUS0) U5.27(OSCI) U5.28(OSCO) U5.31(!DTR) U5.32(!RTS)

### Notes on the sheet
- Controller Debugging
- Controller | Storage Master

## Sheet 8 of 18: Debug USB Hub
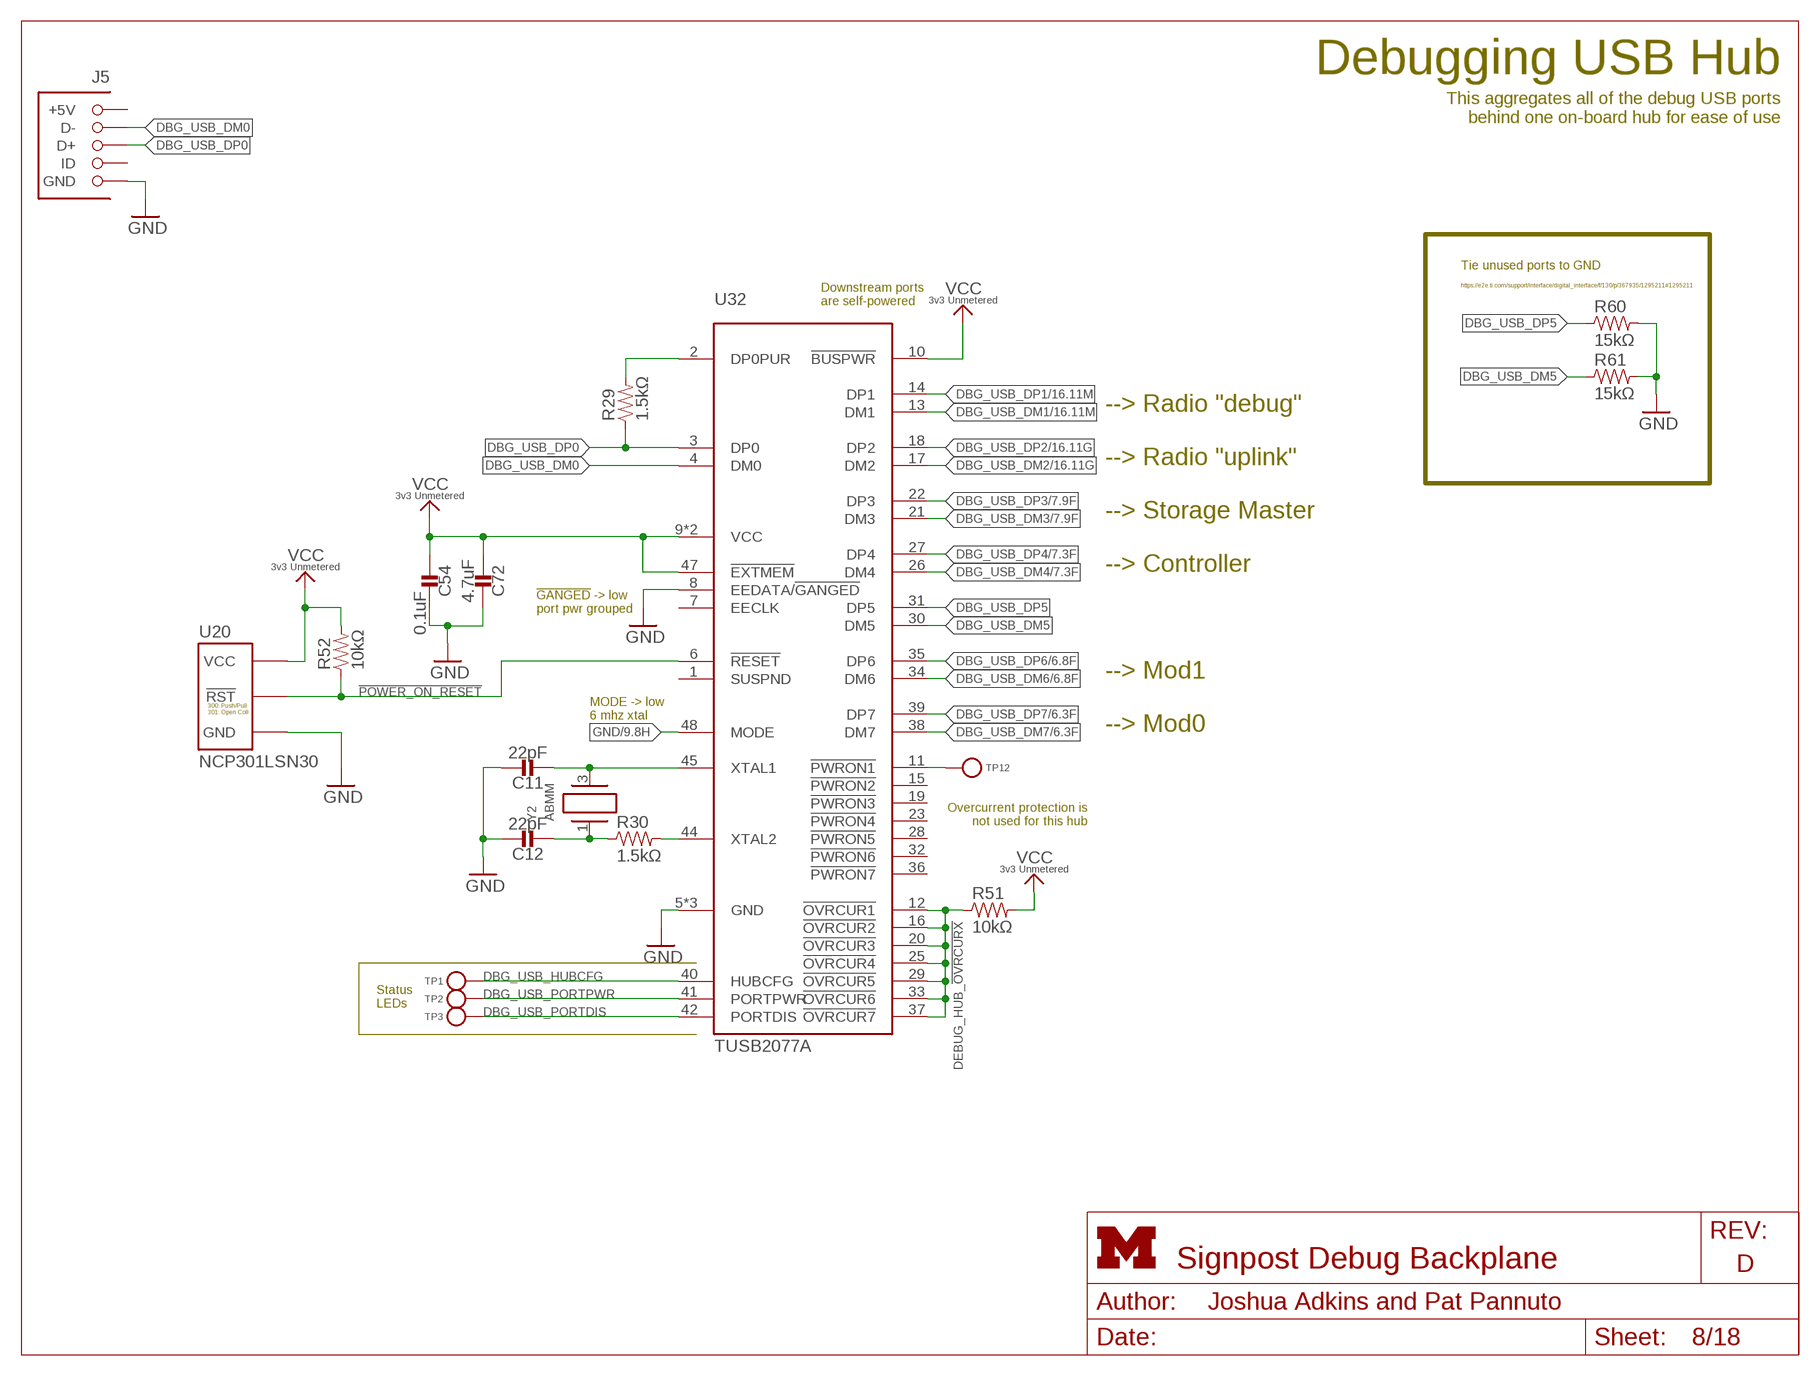
[diagram p7: schematic, sheet 8]
FRAME16 (LETTER_L_UMICH): HEIGHT: 8.5in; WIDTH: 11in

### Parts
C11  22pF  CAPACITOR0603_CAP  [0603_CAP]
C12  22pF  CAPACITOR0603_CAP  [0603_CAP]
C54  0.1uF  CAPACITOR0603_CAP  [0603_CAP]
C72  4.7uF  CAPACITOR0603_CAP  [0603_CAP]
J5  MICRO_USB_B_HIROSE_ZX62R-B-5P  [USB_MICRO_B-HIROSE-ZX62R-B-5P]
R29  1.5kΩ  RESISTOR0603_RES  [0603-RES]
R30  1.5kΩ  RESISTOR0603_RES  [0603-RES]
R51  10kΩ  RESISTOR0603_RES  [0603-RES]
R52  10kΩ  RESISTOR0603_RES  [0603-RES]
R60  15kΩ  RESISTOR0603_RES  [0603-RES]
R61  15kΩ  RESISTOR0603_RES  [0603-RES]
TP1  TEST_POINT_0.040IN  [TESTPOINT_0.040IN]
TP2  TEST_POINT_0.040IN  [TESTPOINT_0.040IN]
TP3  TEST_POINT_0.040IN  [TESTPOINT_0.040IN]
TP12  TEST_POINT_0.040IN  [TESTPOINT_0.040IN]
U20  NCP301LSN30  [SOT23-5]
U32  TUSB2077A  [LQFP-48]
Y2  ABMM  [ABMM]

### Nets
3V3_UNMETERED: C54.2 C72.2 R51.2 R52.2 U20.2(VCC) U32.9(VCC) U32.10(!BUSPWR) U32.46(VCC) U32.47(!EXTMEM) ; supply symbol labelled VCC_3V3_UNMETERED ; also sheet 2,3,5,6,7,9,13,16,18
!POWER_ON_RESET: R52.1 U20.1(!RST) U32.6(!RESET)
DBG_USB_!PWRON: TP12.TESTPOINT U32.11(!PWRON1)
DBG_USB_DM0: J5.2(D-) U32.4(DM0)
DBG_USB_DM1: U32.13(DM1) ; also sheet 16
DBG_USB_DM2: U32.17(DM2) ; also sheet 16
DBG_USB_DM3: U32.21(DM3) ; also sheet 7
DBG_USB_DM4: U32.26(DM4) ; also sheet 7
DBG_USB_DM5: R61.1 U32.30(DM5)
DBG_USB_DM6: U32.34(DM6) ; also sheet 6
DBG_USB_DM7: U32.38(DM7) ; also sheet 6
DBG_USB_DP0: J5.3(D+) R29.1 U32.3(DP0)
DBG_USB_DP1: U32.14(DP1) ; also sheet 16
DBG_USB_DP2: U32.18(DP2) ; also sheet 16
DBG_USB_DP3: U32.22(DP3) ; also sheet 7
DBG_USB_DP4: U32.27(DP4) ; also sheet 7
DBG_USB_DP5: R60.1 U32.31(DP5)
DBG_USB_DP6: U32.35(DP6) ; also sheet 6
DBG_USB_DP7: U32.39(DP7) ; also sheet 6
DBG_USB_HUBCFG: TP1.TESTPOINT U32.40(HUBCFG)
DBG_USB_PORTDIS: TP3.TESTPOINT U32.42(PORTDIS)
DBG_USB_PORTPWR: TP2.TESTPOINT U32.41(PORTPWR)
DBG_USB_XTAL1: C11.2 U32.45(XTAL1) Y2.3
DBG_USB_XTAL2: R30.2 U32.44(XTAL2)
DEBUG_HUB_!OVRCURX: R51.1 U32.12(!OVRCUR1) U32.16(!OVRCUR2) U32.20(!OVRCUR3) U32.25(!OVRCUR4) U32.29(!OVRCUR5) U32.33(!OVRCUR6) U32.37(!OVRCUR7)
GND: C11.1 C12.1 C54.1 C72.1 J5.5(GND) R60.2 R61.2 U20.3(GND) U32.5(GND) U32.8(EEDATA/!GANGED) U32.24(GND) U32.43(GND) U32.48(MODE) ; also sheet 1,2,3,4,5,6,7,9,10,11,12,13,14,15,16,17,18
N$86: R29.2 U32.2(DP0PUR)
N$89: C12.2 R30.1 Y2.1
Unconnected: J5.1(+5V) J5.4(ID) U32.1(SUSPND) U32.7(EECLK) U32.15(!PWRON2) U32.19(!PWRON3) U32.23(!PWRON4) U32.28(!PWRON5) U32.32(!PWRON6) U32.36(!PWRON7)

### Notes on the sheet
- Debugging USB Hub
- This aggregates all of the debug USB ports
  behind one on-board hub for ease of use
- Tie unused ports to GND
- https://e2e.ti.com/support/interface/digital_interface/f/130/p/367935/1295211#1295211
- Downstream ports
  are self-powered
- --> Radio "debug"
- --> Radio "uplink"
- --> Storage Master
- --> Controller
- !GANGED! -> low
  port pwr grouped
- --> Mod1
- MODE -> low
  6 mhz xtal
- --> Mod0
- Overcurrent protection is
  not used for this hub
- Status
  LEDs

## Sheet 9 of 18: GPIO Extenders for Isolation
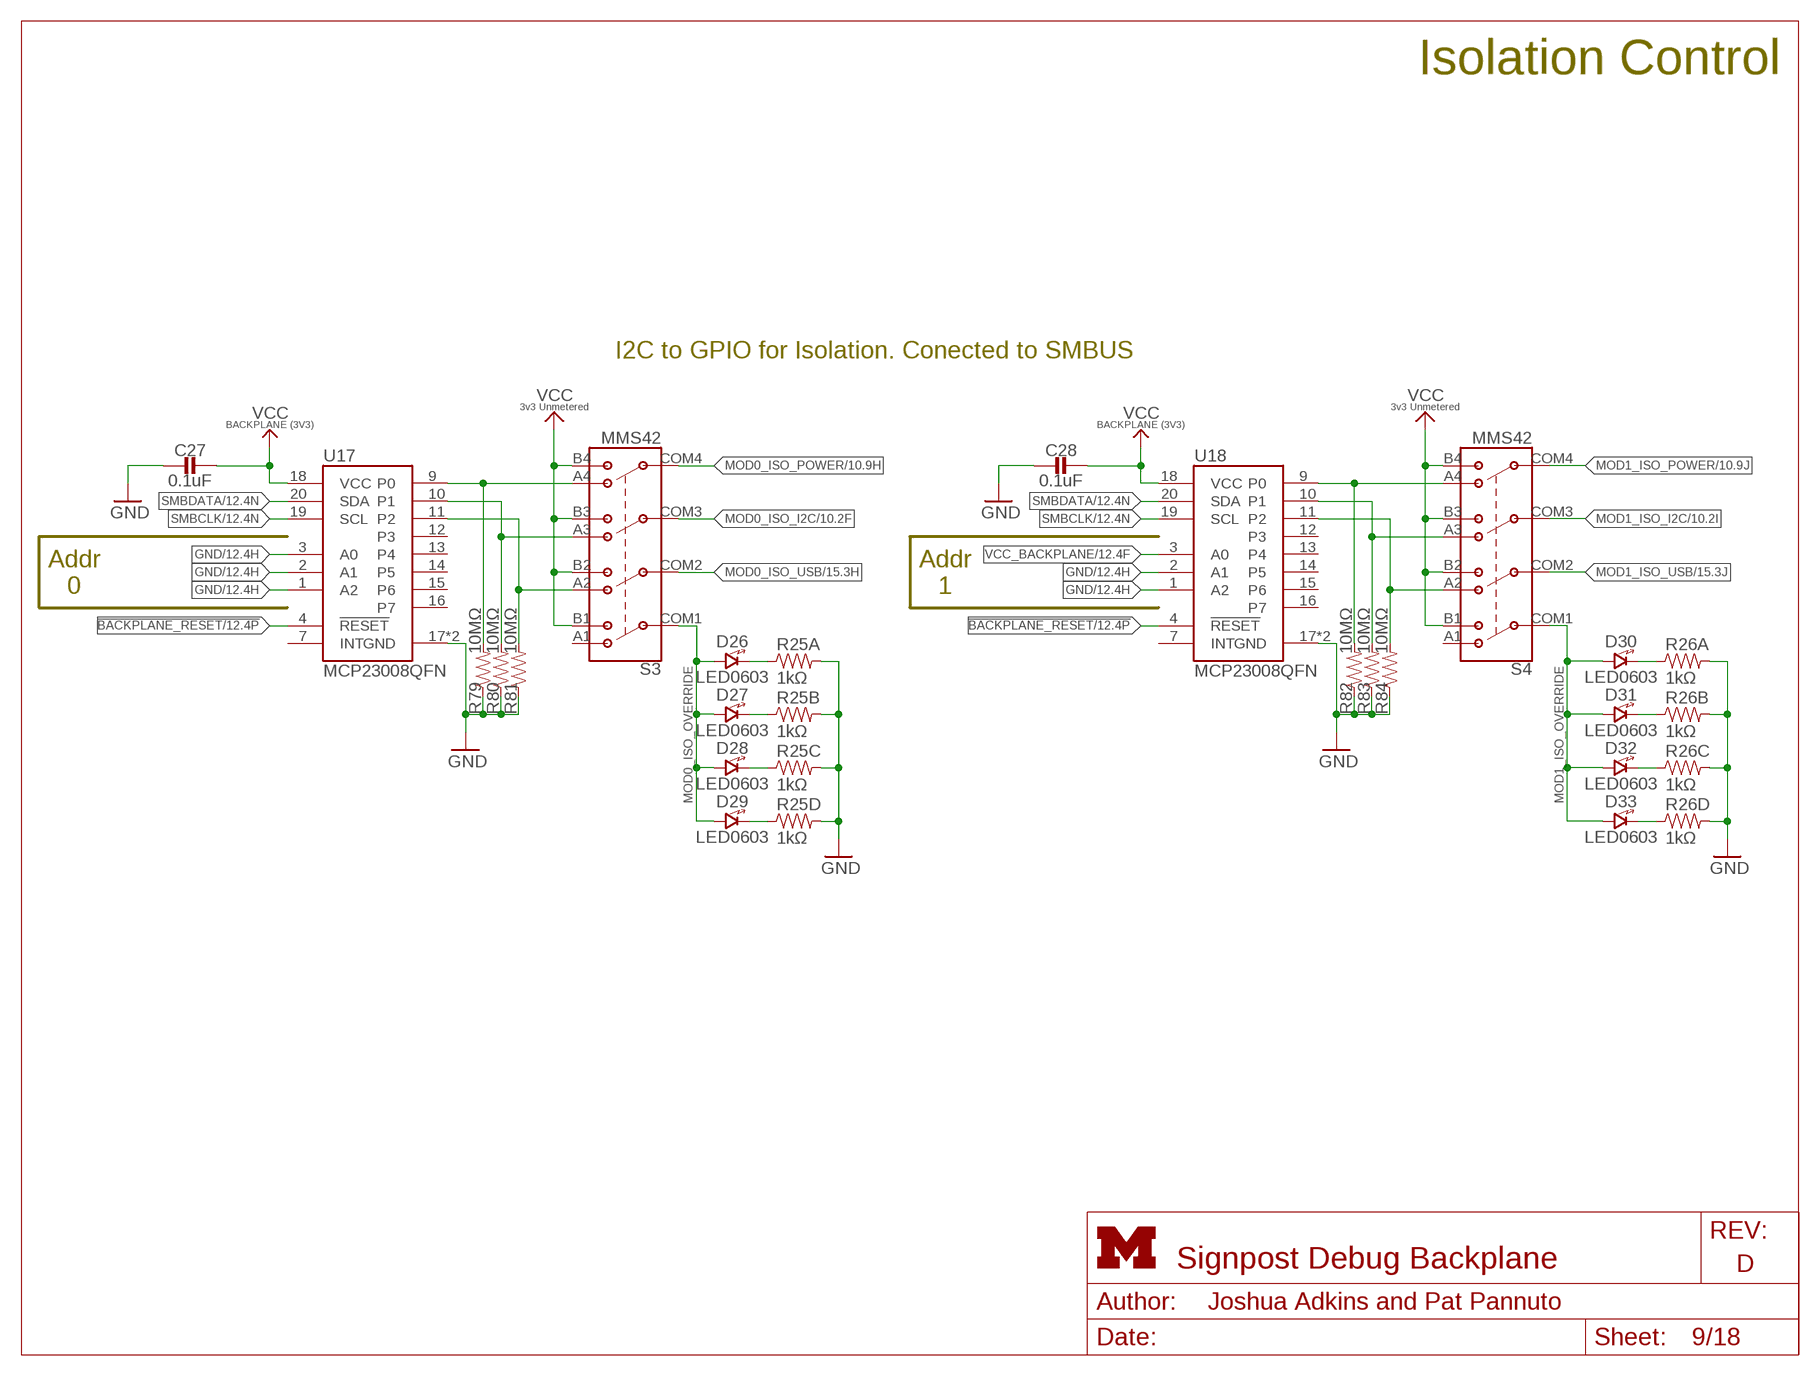
[diagram p8: schematic, sheet 9]
FRAME7 (LETTER_L_UMICH): HEIGHT: 8.5in; WIDTH: 11in

### Parts
C27  0.1uF  CAPACITOR0603_CAP  [0603_CAP]
C28  0.1uF  CAPACITOR0603_CAP  [0603_CAP]
D26  LED0603  [LED-0603]
D27  LED0603  [LED-0603]
D28  LED0603  [LED-0603]
D29  LED0603  [LED-0603]
D30  LED0603  [LED-0603]
D31  LED0603  [LED-0603]
D32  LED0603  [LED-0603]
D33  LED0603  [LED-0603]
R25  1kΩ  RESISTOR-ARRAY-41206  [ARRAY-CONVEX-0603-4]
R26  1kΩ  RESISTOR-ARRAY-41206  [ARRAY-CONVEX-0603-4]
R79  10MΩ  RESISTOR0603_RES  [0603-RES]
R80  10MΩ  RESISTOR0603_RES  [0603-RES]
R81  10MΩ  RESISTOR0603_RES  [0603-RES]
R82  10MΩ  RESISTOR0603_RES  [0603-RES]
R83  10MΩ  RESISTOR0603_RES  [0603-RES]
R84  10MΩ  RESISTOR0603_RES  [0603-RES]
S3  MMS42  [MMS42]
S4  MMS42  [MMS42]
U17  MCP23008QFN  [QFN-20-4MM]
U18  MCP23008QFN  [QFN-20-4MM]

### Nets
3V3_UNMETERED: S3.B1(1TB) S3.B2(2TB) S3.B3(3TB) S3.B4(4TB) S4.B1(1TB) S4.B2(2TB) S4.B3(3TB) S4.B4(4TB) ; supply symbol labelled VCC_3V3_UNMETERED ; also sheet 2,3,5,6,7,8,13,16,18
!BACKPLANE_RESET: U17.4(!RESET) U18.4(!RESET) ; also sheet 1,2,12,18
GND: C27.2 C28.2 R25.A2 R25.B2 R25.C2 R25.D2 R26.A2 R26.B2 R26.C2 R26.D2 R79.1 R80.1 R81.1 R82.1 R83.1 R84.1 U17.1(A2) U17.2(A1) U17.3(A0) U17.17(GND) U17.GND U18.1(A2) U18.2(A1) U18.17(GND) U18.GND ; also sheet 1,2,3,4,5,6,7,8,10,11,12,13,14,15,16,17,18
MOD0_ISO_I2C: S3.COM3(3P) ; also sheet 10,18
MOD0_ISO_OVERRIDE: D26.A(ANODE) D27.A(ANODE) D28.A(ANODE) D29.A(ANODE) S3.COM1(1P)
MOD0_ISO_P0: R79.2 S3.A4(4TA) U17.9(P0)
MOD0_ISO_P1: R80.2 S3.A3(3TA) U17.10(P1)
MOD0_ISO_P2: R81.2 S3.A2(2TA) U17.11(P2)
MOD0_ISO_POWER: S3.COM4(4P) ; also sheet 10,18
MOD0_ISO_USB: S3.COM2(2P) ; also sheet 15,18
MOD1_ISO_I2C: S4.COM3(3P) ; also sheet 10,18
MOD1_ISO_OVERRIDE: D30.A(ANODE) D31.A(ANODE) D32.A(ANODE) D33.A(ANODE) S4.COM1(1P)
MOD1_ISO_P0: R82.2 S4.A4(4TA) U18.9(P0)
MOD1_ISO_P1: R83.2 S4.A3(3TA) U18.10(P1)
MOD1_ISO_P2: R84.2 S4.A2(2TA) U18.11(P2)
MOD1_ISO_POWER: S4.COM4(4P) ; also sheet 10,18
MOD1_ISO_USB: S4.COM2(2P) ; also sheet 15,18
N$60: D29.C(CATHODE) R25.D1
N$61: D28.C(CATHODE) R25.C1
N$62: D27.C(CATHODE) R25.B1
N$63: D26.C(CATHODE) R25.A1
N$66: D30.C(CATHODE) R26.A1
N$75: D31.C(CATHODE) R26.B1
N$76: D32.C(CATHODE) R26.C1
N$77: D33.C(CATHODE) R26.D1
SMBCLK: U17.19(SCL) U18.19(SCL) ; also sheet 1,3,12,17,18
SMBDATA: U17.20(SDA) U18.20(SDA) ; also sheet 1,3,12,17,18
VCC_BACKPLANE: C27.1 C28.1 U17.18(VCC) U18.3(A0) U18.18(VCC) ; also sheet 1,3,7,10,11,12,14,15,17,18
Unconnected: S3.A1(1TA) S4.A1(1TA) U17.7(INT) U17.12(P3) U17.13(P4) U17.14(P5) U17.15(P6) U17.16(P7) U18.7(INT) U18.12(P3) U18.13(P4) U18.14(P5) U18.15(P6) U18.16(P7)

### Notes on the sheet
- Isolation Control
- I2C to GPIO for Isolation. Conected to SMBUS
- Addr
  0
- Addr
  1

## Sheet 10 of 18: I2C & Power Isolation
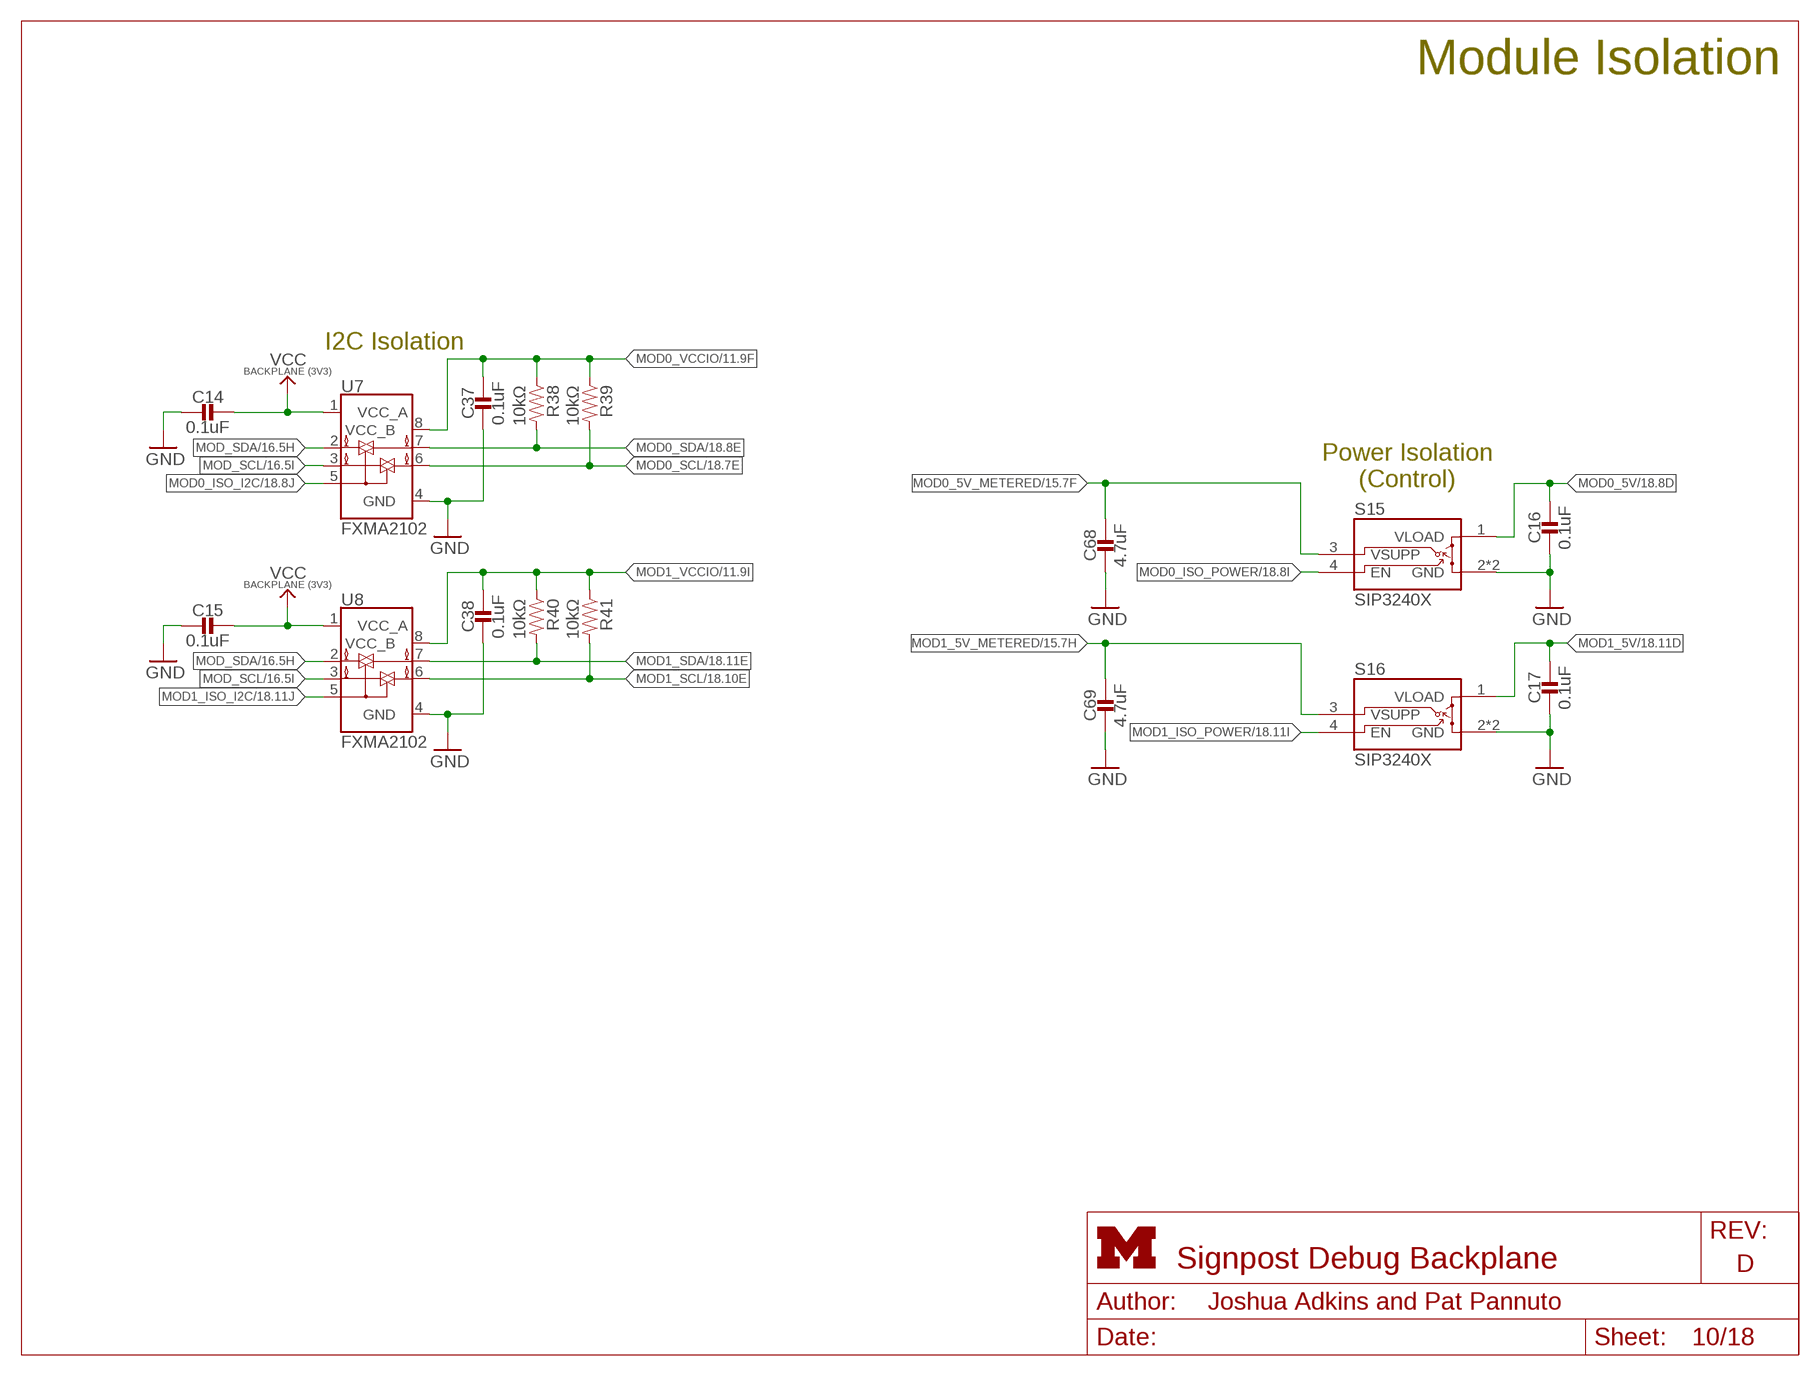
[diagram p9: schematic, sheet 10]
FRAME4 (LETTER_L_UMICH): HEIGHT: 8.5in; WIDTH: 11in

### Parts
C14  0.1uF  CAPACITOR0603_CAP  [0603_CAP]
C15  0.1uF  CAPACITOR0603_CAP  [0603_CAP]
C16  0.1uF  CAPACITOR0603_CAP  [0603_CAP]
C17  0.1uF  CAPACITOR0603_CAP  [0603_CAP]
C37  0.1uF  CAPACITOR0603_CAP  [0603_CAP]
C38  0.1uF  CAPACITOR0603_CAP  [0603_CAP]
C68  4.7uF  CAPACITOR0603_CAP  [0603_CAP]
C69  4.7uF  CAPACITOR0603_CAP  [0603_CAP]
R38  10kΩ  RESISTOR0603_RES  [0603-RES]
R39  10kΩ  RESISTOR0603_RES  [0603-RES]
R40  10kΩ  RESISTOR0603_RES  [0603-RES]
R41  10kΩ  RESISTOR0603_RES  [0603-RES]
S15  SIP3240X  [TDFN4]
S16  SIP3240X  [TDFN4]
U7  FXMA2102  [UMLP-8]
U8  FXMA2102  [UMLP-8]

### Nets
GND: C14.2 C15.2 C16.2 C17.2 C37.2 C38.2 C68.2 C69.2 S15.2(GND) S15.PAD(GND) S16.2(GND) S16.PAD(GND) U7.4(GND) U8.4(GND) ; also sheet 1,2,3,4,5,6,7,8,9,11,12,13,14,15,16,17,18
MOD0_5V: C16.1 S15.1(VLOAD) ; also sheet 4,18
MOD0_5V_METERED: C68.1 S15.3(VSUPP) ; also sheet 3,15,18
MOD0_ISO_I2C: U7.5(OE) ; also sheet 9,18
MOD0_ISO_POWER: S15.4(EN) ; also sheet 9,18
MOD0_SCL: R39.2 U7.6(B1) ; also sheet 4,18
MOD0_SDA: R38.2 U7.7(B0) ; also sheet 4,18
MOD0_VCCIO: C37.1 R38.1 R39.1 U7.8(VCC_B) ; also sheet 4,5,6,11,18
MOD1_5V: C17.1 S16.1(VLOAD) ; also sheet 4,18
MOD1_5V_METERED: C69.1 S16.3(VSUPP) ; also sheet 3,15,18
MOD1_ISO_I2C: U8.5(OE) ; also sheet 9,18
MOD1_ISO_POWER: S16.4(EN) ; also sheet 9,18
MOD1_SCL: R41.2 U8.6(B1) ; also sheet 4,18
MOD1_SDA: R40.2 U8.7(B0) ; also sheet 4,18
MOD1_VCCIO: C38.1 R40.1 R41.1 U8.8(VCC_B) ; also sheet 4,5,6,11,18
MOD_SCL: U7.3(A1) U8.3(A1) ; also sheet 1,16,18
MOD_SDA: U7.2(A0) U8.2(A0) ; also sheet 1,16,18
VCC_BACKPLANE: C14.1 C15.1 U7.1(VCC_A) U8.1(VCC_A) ; also sheet 1,3,7,9,11,12,14,15,17,18

### Notes on the sheet
- Module Isolation
- I2C Isolation
- Power Isolation
  (Control)

## Sheet 11 of 18: GPIO & PPS Isolation
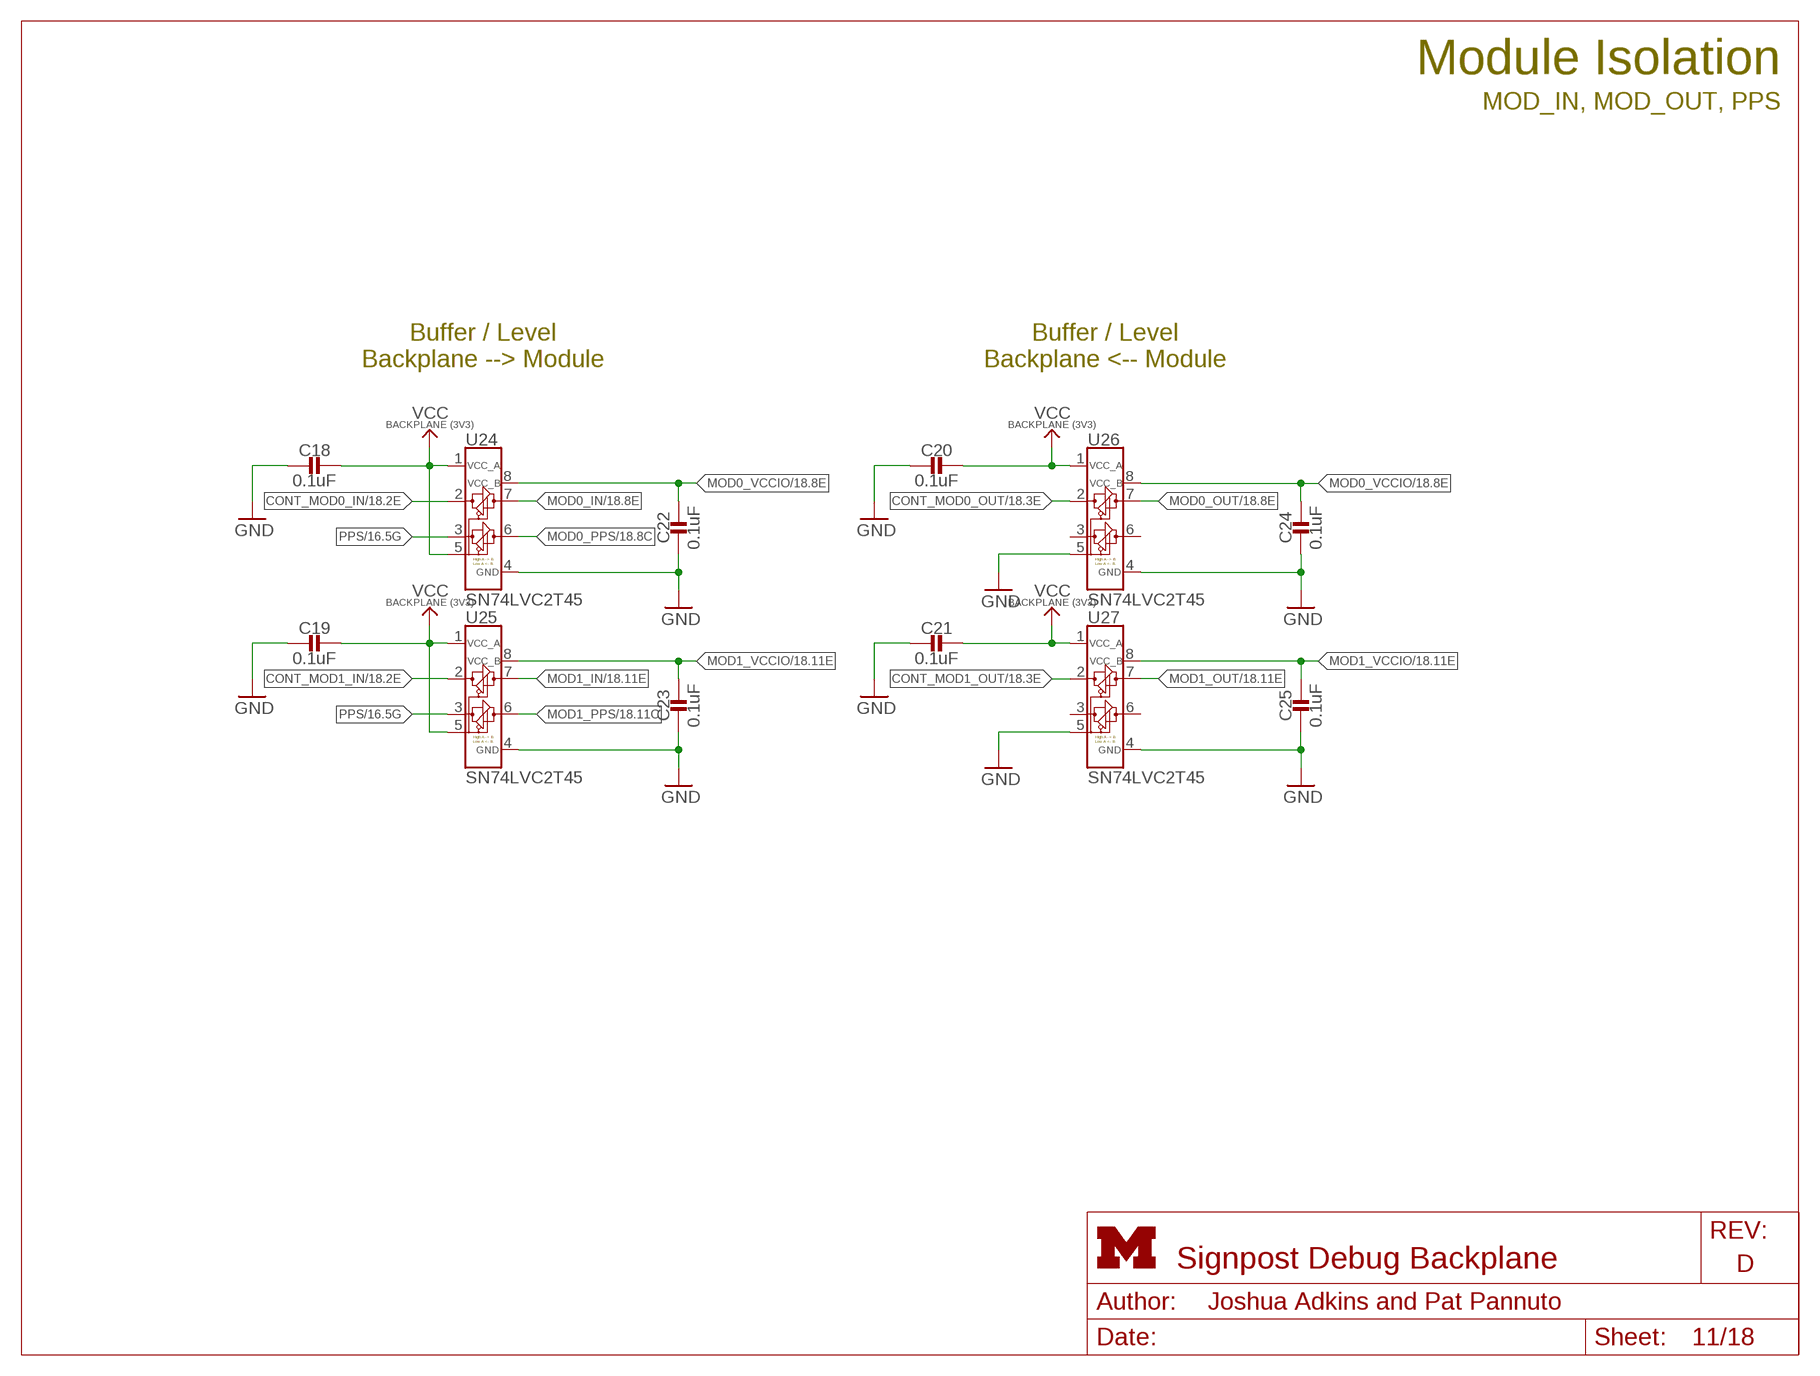
[diagram p10: schematic, sheet 11]
FRAME5 (LETTER_L_UMICH): HEIGHT: 8.5in; WIDTH: 11in

### Parts
C18  0.1uF  CAPACITOR0603_CAP  [0603_CAP]
C19  0.1uF  CAPACITOR0603_CAP  [0603_CAP]
C20  0.1uF  CAPACITOR0603_CAP  [0603_CAP]
C21  0.1uF  CAPACITOR0603_CAP  [0603_CAP]
C22  0.1uF  CAPACITOR0603_CAP  [0603_CAP]
C23  0.1uF  CAPACITOR0603_CAP  [0603_CAP]
C24  0.1uF  CAPACITOR0603_CAP  [0603_CAP]
C25  0.1uF  CAPACITOR0603_CAP  [0603_CAP]
U24  SN74LVC2T45  [VFSOP-8]
U25  SN74LVC2T45  [VFSOP-8]
U26  SN74LVC2T45  [VFSOP-8]
U27  SN74LVC2T45  [VFSOP-8]

### Nets
CONT_MOD0_IN: U24.2(A1) ; also sheet 1,18
CONT_MOD0_OUT: U26.2(A1) ; also sheet 1,18
CONT_MOD1_IN: U25.2(A1) ; also sheet 1,18
CONT_MOD1_OUT: U27.2(A1) ; also sheet 1,18
GND: C18.2 C19.2 C20.2 C21.2 C22.2 C23.2 C24.2 C25.2 U24.4(GND) U25.4(GND) U26.4(GND) U26.5(DIR) U27.4(GND) U27.5(DIR) ; also sheet 1,2,3,4,5,6,7,8,9,10,12,13,14,15,16,17,18
MOD0_IN: U24.7(B1) ; also sheet 4,18
MOD0_OUT: U26.7(B1) ; also sheet 4,18
MOD0_PPS: U24.6(B2) ; also sheet 4,18
MOD0_VCCIO: C22.1 C24.1 U24.8(VCC_B) U26.8(VCC_B) ; also sheet 4,5,6,10,18
MOD1_IN: U25.7(B1) ; also sheet 4,18
MOD1_OUT: U27.7(B1) ; also sheet 4,18
MOD1_PPS: U25.6(B2) ; also sheet 4,18
MOD1_VCCIO: C23.1 C25.1 U25.8(VCC_B) U27.8(VCC_B) ; also sheet 4,5,6,10,18
PPS: U24.3(A2) U25.3(A2) ; also sheet 1,16,18
VCC_BACKPLANE: C18.1 C19.1 C20.1 C21.1 U24.1(VCC_A) U24.5(DIR) U25.1(VCC_A) U25.5(DIR) U26.1(VCC_A) U27.1(VCC_A) ; also sheet 1,3,7,9,10,12,14,15,17,18
Unconnected: U26.3(A2) U26.6(B2) U27.3(A2) U27.6(B2)

### Notes on the sheet
- Module Isolation
- MOD_IN, MOD_OUT, PPS
- Buffer / Level
  Backplane --> Module
- Buffer / Level
  Backplane <-- Module

## Sheet 12 of 18: Module USB Hub
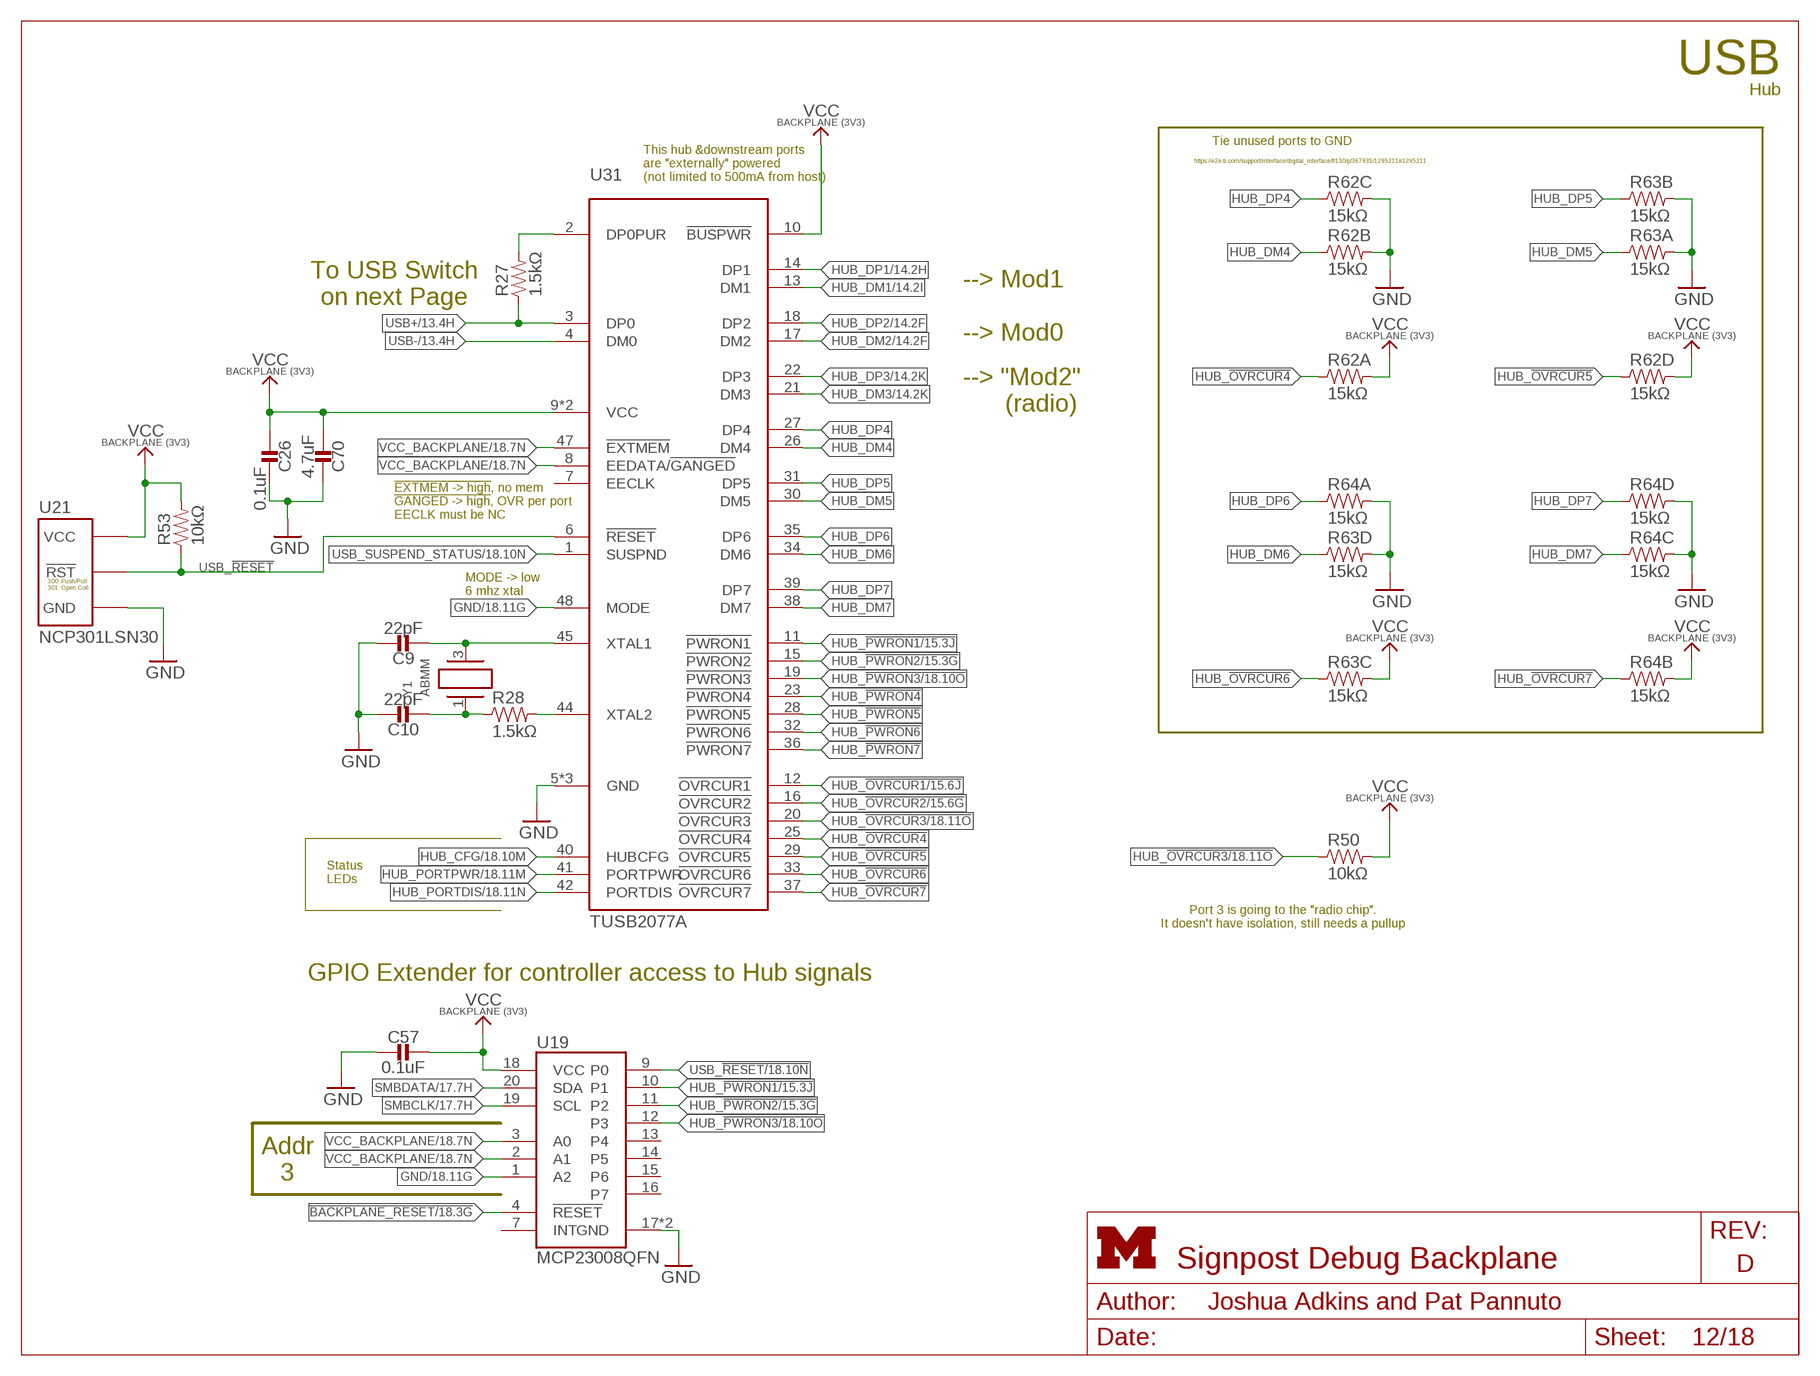
[diagram p11: schematic, sheet 12]
FRAME8 (LETTER_L_UMICH): HEIGHT: 8.5in; WIDTH: 11in

### Parts
C9  22pF  CAPACITOR0603_CAP  [0603_CAP]
C10  22pF  CAPACITOR0603_CAP  [0603_CAP]
C26  0.1uF  CAPACITOR0603_CAP  [0603_CAP]
C57  0.1uF  CAPACITOR0603_CAP  [0603_CAP]
C70  4.7uF  CAPACITOR0603_CAP  [0603_CAP]
R27  1.5kΩ  RESISTOR0603_RES  [0603-RES]
R28  1.5kΩ  RESISTOR0603_RES  [0603-RES]
R50  10kΩ  RESISTOR0603_RES  [0603-RES]
R53  10kΩ  RESISTOR0603_RES  [0603-RES]
R62  15kΩ  RESISTOR-ARRAY-41206  [ARRAY-CONVEX-0603-4]
R63  15kΩ  RESISTOR-ARRAY-41206  [ARRAY-CONVEX-0603-4]
R64  15kΩ  RESISTOR-ARRAY-41206  [ARRAY-CONVEX-0603-4]
U19  MCP23008QFN  [QFN-20-4MM]
U21  NCP301LSN30  [SOT23-5]
U31  TUSB2077A  [LQFP-48]
Y1  ABMM  [ABMM]

### Nets
!BACKPLANE_RESET: U19.4(!RESET) ; also sheet 1,2,9,18
GND: C9.1 C10.1 C26.1 C57.2 C70.1 R62.B2 R62.C2 R63.A2 R63.B2 R63.D2 R64.A2 R64.C2 R64.D2 U19.1(A2) U19.17(GND) U19.GND U21.3(GND) U31.5(GND) U31.24(GND) U31.43(GND) U31.48(MODE) ; also sheet 1,2,3,4,5,6,7,8,9,10,11,13,14,15,16,17,18
HUB_!OVRCUR1: U31.12(!OVRCUR1) ; also sheet 15,18
HUB_!OVRCUR2: U31.16(!OVRCUR2) ; also sheet 15,18
HUB_!OVRCUR3: R50.1 U31.20(!OVRCUR3) ; also sheet 18
HUB_!OVRCUR4: R62.A1 U31.25(!OVRCUR4)
HUB_!OVRCUR5: R62.D1 U31.29(!OVRCUR5)
HUB_!OVRCUR6: R63.C1 U31.33(!OVRCUR6)
HUB_!OVRCUR7: R64.B1 U31.37(!OVRCUR7)
HUB_!PWRON1: U19.10(P1) U31.11(!PWRON1) ; also sheet 15,18
HUB_!PWRON2: U19.11(P2) U31.15(!PWRON2) ; also sheet 15,18
HUB_!PWRON3: U19.12(P3) U31.19(!PWRON3) ; also sheet 18
HUB_!PWRON4: U31.23(!PWRON4)
HUB_!PWRON5: U31.28(!PWRON5)
HUB_!PWRON6: U31.32(!PWRON6)
HUB_!PWRON7: U31.36(!PWRON7)
HUB_CFG: U31.40(HUBCFG) ; also sheet 18
HUB_DM1: U31.13(DM1) ; also sheet 14
HUB_DM2: U31.17(DM2) ; also sheet 14
HUB_DM3: U31.21(DM3) ; also sheet 14
HUB_DM4: R62.B1 U31.26(DM4)
HUB_DM5: R63.A1 U31.30(DM5)
HUB_DM6: R63.D1 U31.34(DM6)
HUB_DM7: R64.C1 U31.38(DM7)
HUB_DP1: U31.14(DP1) ; also sheet 14
HUB_DP2: U31.18(DP2) ; also sheet 14
HUB_DP3: U31.22(DP3) ; also sheet 14
HUB_DP4: R62.C1 U31.27(DP4)
HUB_DP5: R63.B1 U31.31(DP5)
HUB_DP6: R64.A1 U31.35(DP6)
HUB_DP7: R64.D1 U31.39(DP7)
HUB_PORTDIS: U31.42(PORTDIS) ; also sheet 18
HUB_PORTPWR: U31.41(PORTPWR) ; also sheet 18
N$12: R27.2 U31.2(DP0PUR)
N$14: C10.2 R28.1 Y1.1
N$73: C9.2 U31.45(XTAL1) Y1.3
N$74: R28.2 U31.44(XTAL2)
SMBCLK: U19.19(SCL) ; also sheet 1,3,9,17,18
SMBDATA: U19.20(SDA) ; also sheet 1,3,9,17,18
USB+: R27.1 U31.3(DP0) ; also sheet 13
USB-: U31.4(DM0) ; also sheet 13
USB_!RESET: R53.1 U19.9(P0) U21.1(!RST) U31.6(!RESET) ; also sheet 2,18
USB_SUSPEND_STATUS: U31.1(SUSPND) ; also sheet 18
VCC_BACKPLANE: C26.2 C57.1 C70.2 R50.2 R53.2 R62.A2 R62.D2 R63.C2 R64.B2 U19.2(A1) U19.3(A0) U19.18(VCC) U21.2(VCC) U31.8(EEDATA/!GANGED) U31.9(VCC) U31.10(!BUSPWR) U31.46(VCC) U31.47(!EXTMEM) ; also sheet 1,3,7,9,10,11,14,15,17,18
Unconnected: U19.7(INT) U19.13(P4) U19.14(P5) U19.15(P6) U19.16(P7) U31.7(EECLK)

### Notes on the sheet
- USB
- Hub
- Tie unused ports to GND
- https://e2e.ti.com/support/interface/digital_interface/f/130/p/367935/1295211#1295211
- This hub &downstream ports
  are "externally" powered
  (not limited to 500mA from host)
- --> Mod1
- To USB Switch
  on next Page
- --> Mod0
- --> "Mod2"
        (radio)
- !EXTMEM -> high, no mem
  !GANGED -> high, OVR per port
  EECLK must be NC
- MODE -> low
  6 mhz xtal
- Status
  LEDs
- Port 3 is going to the "radio chip".
  It doesn't have isolation, still needs a pullup
- GPIO Extender for controller access to Hub signals
- Addr
  3

## Sheet 13 of 18: Module USB Override Switch
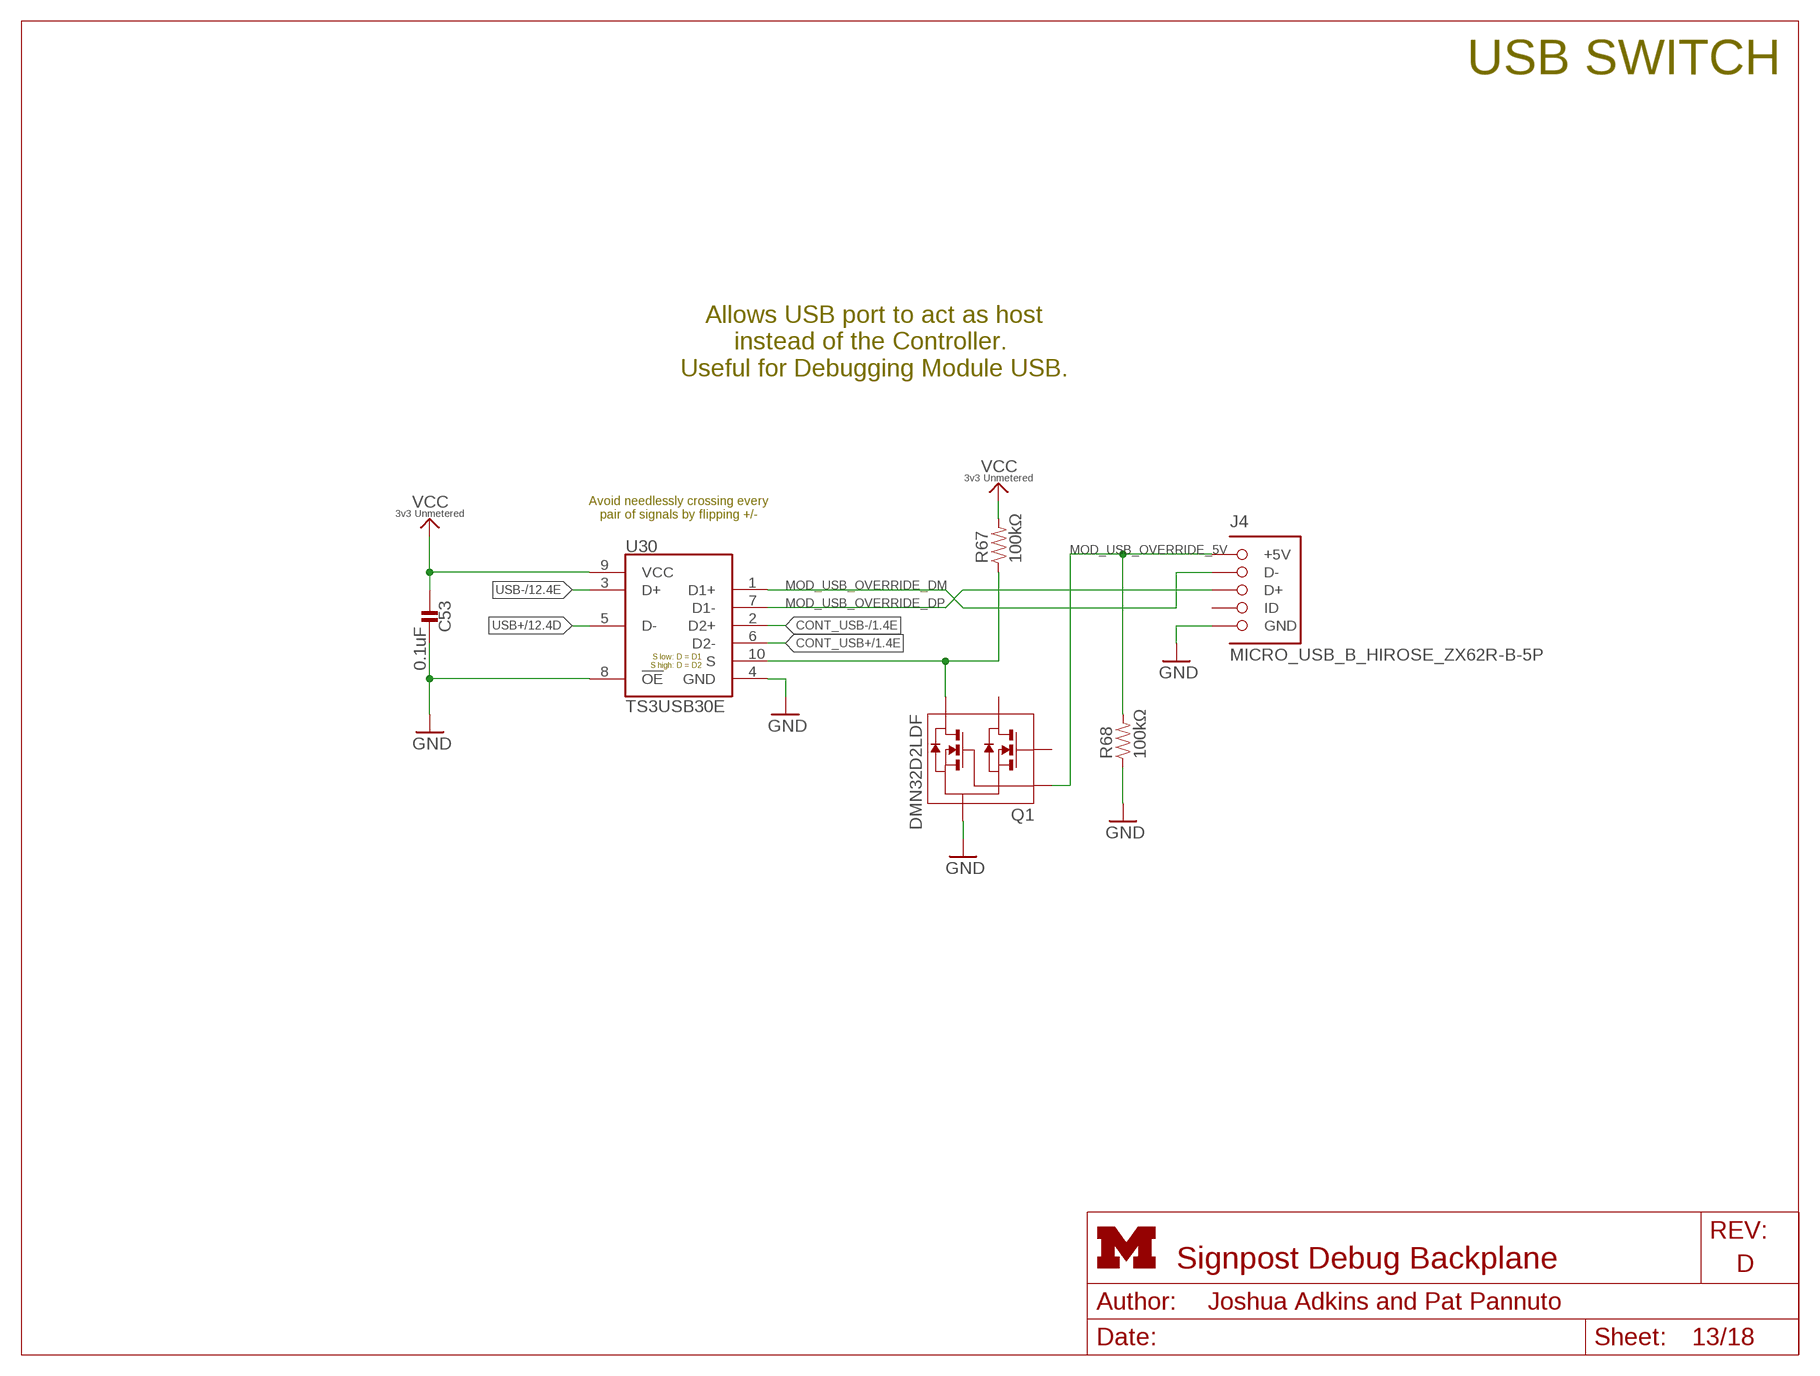
[diagram p12: schematic, sheet 13]
FRAME14 (LETTER_L_UMICH): HEIGHT: 8.5in; WIDTH: 11in

### Parts
C53  0.1uF  CAPACITOR0603_CAP  [0603_CAP]
J4  MICRO_USB_B_HIROSE_ZX62R-B-5P  [USB_MICRO_B-HIROSE-ZX62R-B-5P]
Q1  DMN32D2LDF  [SOT353]
R67  100kΩ  RESISTOR0603_RES  [0603-RES]
R68  100kΩ  RESISTOR0603_RES  [0603-RES]
U30  TS3USB30E  [UQFN-10]

### Nets
3V3_UNMETERED: C53.2 R67.2 U30.9(VCC) ; supply symbol labelled VCC_3V3_UNMETERED ; also sheet 2,3,5,6,7,8,9,16,18
CONT_USB+: U30.6(D2-) ; also sheet 1
CONT_USB-: U30.2(D2+) ; also sheet 1
GND: C53.1 J4.5(GND) Q1.S R68.1 U30.4(GND) U30.8(!OE) ; also sheet 1,2,3,4,5,6,7,8,9,10,11,12,14,15,16,17,18
MOD_USB_OVERRIDE_5V: J4.1(+5V) Q1.G2 R68.2
MOD_USB_OVERRIDE_DM: J4.2(D-) U30.1(D1+)
MOD_USB_OVERRIDE_DP: J4.3(D+) U30.7(D1-)
N$33: Q1.D2 R67.1 U30.10(S)
USB+: U30.5(D-) ; also sheet 12
USB-: U30.3(D+) ; also sheet 12
Unconnected: J4.4(ID) Q1.D1 Q1.G1

### Notes on the sheet
- USB SWITCH
- Allows USB port to act as host
  instead of the Controller. 
  Useful for Debugging Module USB.
- Avoid needlessly crossing every
  pair of signals by flipping +/-

## Sheet 14 of 18: Module USB Passives; Isolation
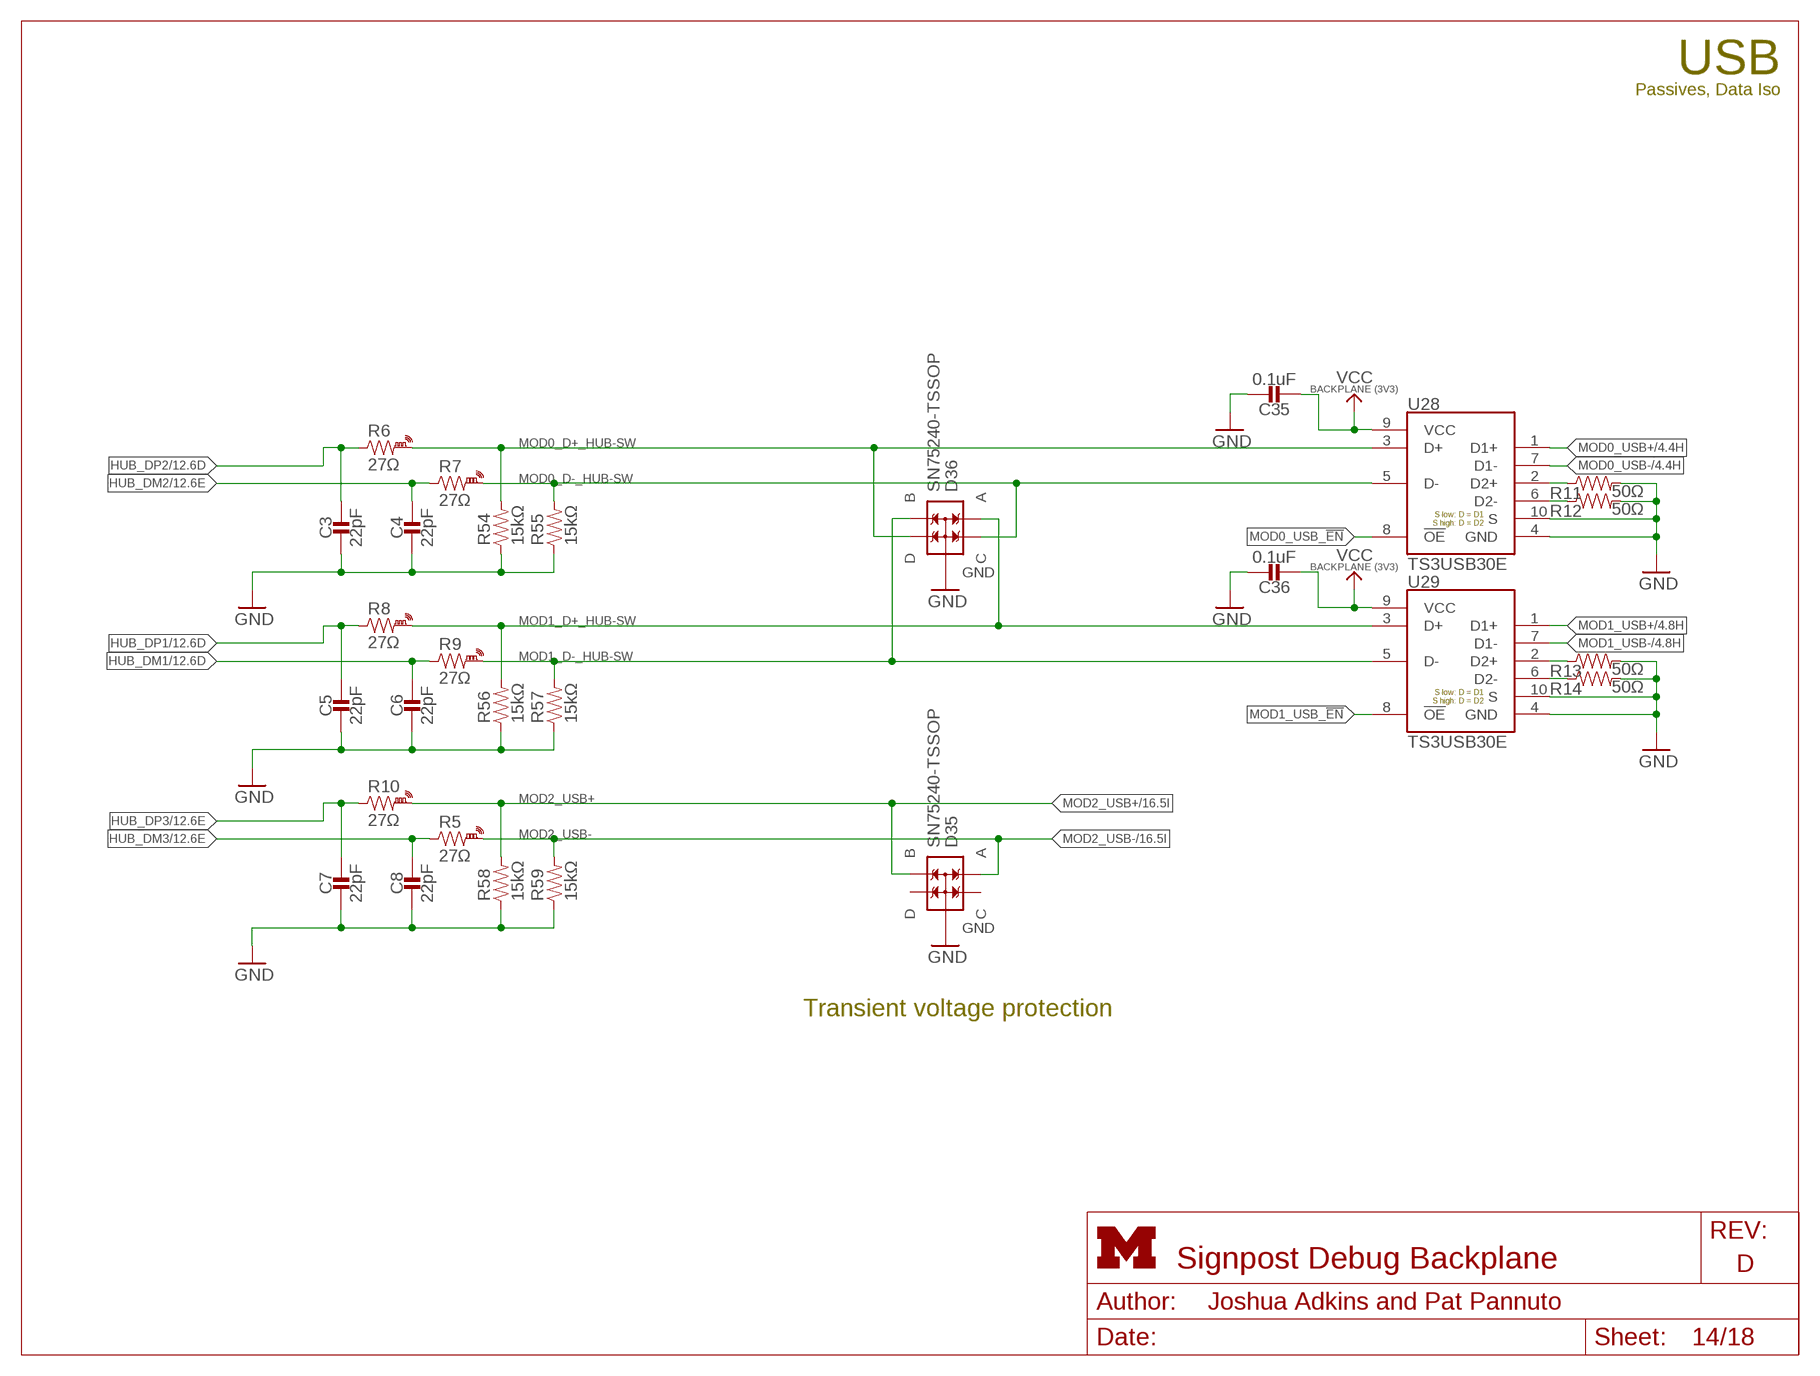
[diagram p13: schematic, sheet 14]
FRAME3 (LETTER_L_UMICH): HEIGHT: 8.5in; WIDTH: 11in

### Parts
C3  22pF  CAPACITOR0402_CAP  [0402_CAP]
C4  22pF  CAPACITOR0402_CAP  [0402_CAP]
C5  22pF  CAPACITOR0402_CAP  [0402_CAP]
C6  22pF  CAPACITOR0402_CAP  [0402_CAP]
C7  22pF  CAPACITOR0402_CAP  [0402_CAP]
C8  22pF  CAPACITOR0402_CAP  [0402_CAP]
C35  0.1uF  CAPACITOR0603_CAP  [0603_CAP]
C36  0.1uF  CAPACITOR0603_CAP  [0603_CAP]
D35  SN75240-TSSOP  [TSSOP-8]
D36  SN75240-TSSOP  [TSSOP-8]
R5  27Ω  RESISTOR-HIGH_SPEED0402  [0402_RES-HIGH_SPEED]
R6  27Ω  RESISTOR-HIGH_SPEED0402  [0402_RES-HIGH_SPEED]
R7  27Ω  RESISTOR-HIGH_SPEED0402  [0402_RES-HIGH_SPEED]
R8  27Ω  RESISTOR-HIGH_SPEED0402  [0402_RES-HIGH_SPEED]
R9  27Ω  RESISTOR-HIGH_SPEED0402  [0402_RES-HIGH_SPEED]
R10  27Ω  RESISTOR-HIGH_SPEED0402  [0402_RES-HIGH_SPEED]
R11  50Ω  RESISTOR0603_RES  [0603-RES]
R12  50Ω  RESISTOR0603_RES  [0603-RES]
R13  50Ω  RESISTOR0603_RES  [0603-RES]
R14  50Ω  RESISTOR0603_RES  [0603-RES]
R54  15kΩ  RESISTOR0603_RES  [0603-RES]
R55  15kΩ  RESISTOR0603_RES  [0603-RES]
R56  15kΩ  RESISTOR0603_RES  [0603-RES]
R57  15kΩ  RESISTOR0603_RES  [0603-RES]
R58  15kΩ  RESISTOR0603_RES  [0603-RES]
R59  15kΩ  RESISTOR0603_RES  [0603-RES]
U28  TS3USB30E  [UQFN-10]
U29  TS3USB30E  [UQFN-10]

### Nets
GND: C3.2 C4.2 C5.2 C6.2 C7.2 C8.2 C35.1 C36.1 D35.1(GND) D35.3(GND) D35.5(GND) D35.7(GND) D36.1(GND) D36.3(GND) D36.5(GND) D36.7(GND) R11.2 R12.2 R13.2 R14.2 R54.1 R55.1 R56.1 R57.1 R58.1 R59.1 U28.4(GND) U28.10(S) U29.4(GND) U29.10(S) ; also sheet 1,2,3,4,5,6,7,8,9,10,11,12,13,15,16,17,18
HUB_DM1: C6.1 R9.2 ; also sheet 12
HUB_DM2: C4.1 R7.2 ; also sheet 12
HUB_DM3: C8.1 R5.2 ; also sheet 12
HUB_DP1: C5.1 R8.2 ; also sheet 12
HUB_DP2: C3.1 R6.2 ; also sheet 12
HUB_DP3: C7.1 R10.2 ; also sheet 12
MOD0_D+_HUB-SW: D36.4(D) R6.1 R54.2 U28.3(D+)
MOD0_D-_HUB-SW: D36.2(C) R7.1 R55.2 U28.5(D-)
MOD0_USB+: U28.1(D1+) ; also sheet 4
MOD0_USB-: U28.7(D1-) ; also sheet 4
MOD0_USB_!EN: U28.8(!OE) ; also sheet 15
MOD1_D+_HUB-SW: D36.8(A) R8.1 R56.2 U29.3(D+)
MOD1_D-_HUB-SW: D36.6(B) R9.1 R57.2 U29.5(D-)
MOD1_USB+: U29.1(D1+) ; also sheet 4
MOD1_USB-: U29.7(D1-) ; also sheet 4
MOD1_USB_!EN: U29.8(!OE) ; also sheet 15
MOD2_USB+: D35.6(B) R10.1 R58.2 ; also sheet 16
MOD2_USB-: D35.8(A) R5.1 R59.2 ; also sheet 16
N$17: R11.1 U28.2(D2+)
N$26: R14.1 U29.6(D2-)
N$27: R13.1 U29.2(D2+)
N$31: R12.1 U28.6(D2-)
VCC_BACKPLANE: C35.2 C36.2 U28.9(VCC) U29.9(VCC) ; also sheet 1,3,7,9,10,11,12,15,17,18
Unconnected: D35.2(C) D35.4(D)

### Notes on the sheet
- USB
- Passives, Data Iso
- Transient voltage protection

## Sheet 15 of 18: Module USB Power Switches
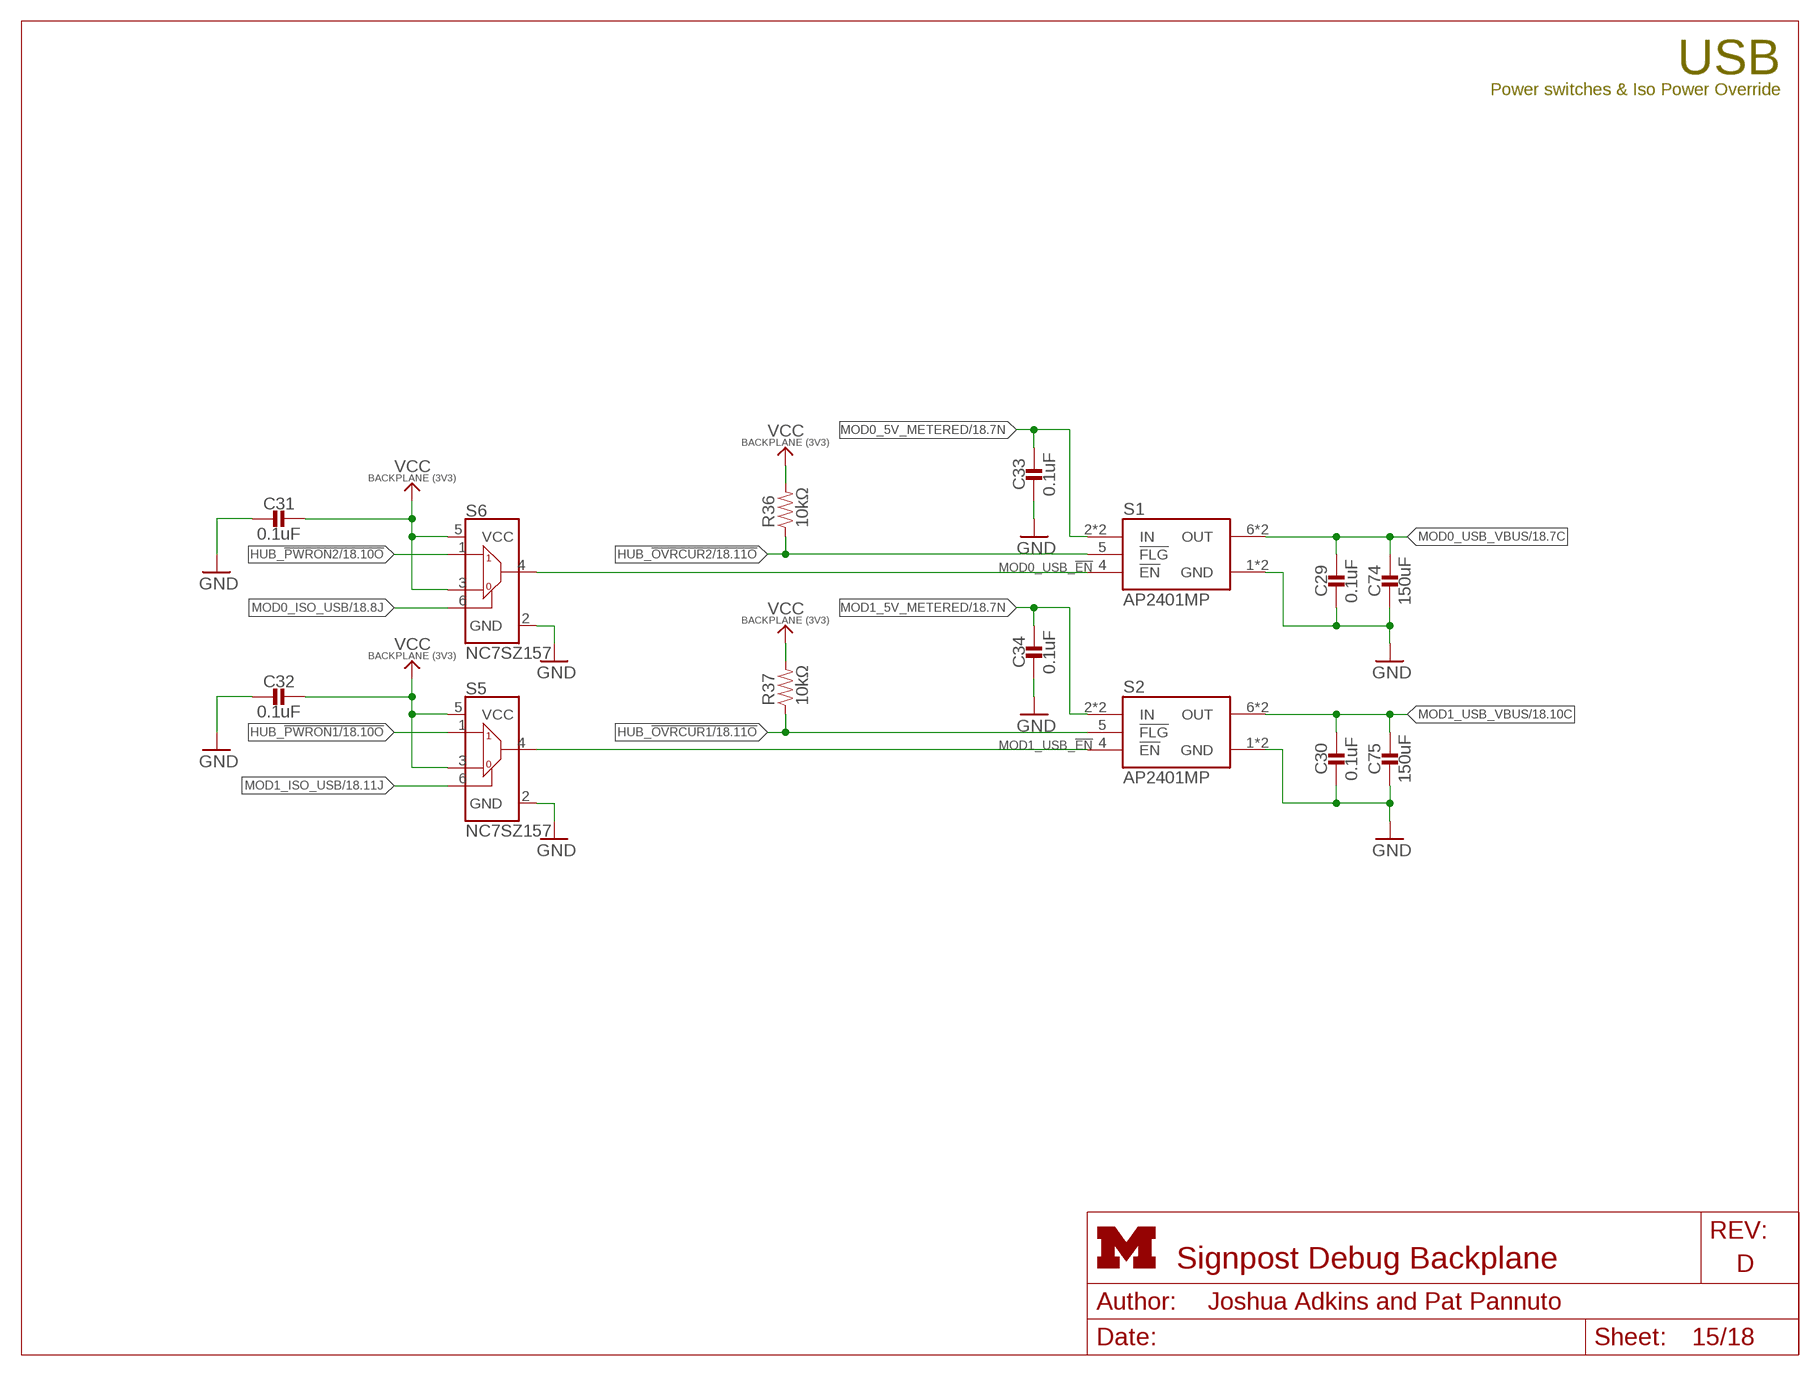
[diagram p14: schematic, sheet 15]
FRAME6 (LETTER_L_UMICH): HEIGHT: 8.5in; WIDTH: 11in

### Parts
C29  0.1uF  CAPACITOR0603_CAP  [0603_CAP]
C30  0.1uF  CAPACITOR0603_CAP  [0603_CAP]
C31  0.1uF  CAPACITOR0603_CAP  [0603_CAP]
C32  0.1uF  CAPACITOR0603_CAP  [0603_CAP]
C33  0.1uF  CAPACITOR0603_CAP  [0603_CAP]
C34  0.1uF  CAPACITOR0603_CAP  [0603_CAP]
C74  150uF  CAPACITOR1210_CAP  [1210_CAP]
C75  150uF  CAPACITOR1210_CAP  [1210_CAP]
R36  10kΩ  RESISTOR0603_RES  [0603-RES]
R37  10kΩ  RESISTOR0603_RES  [0603-RES]
S1  AP2401MP  [MSOP-8EP]
S2  AP2401MP  [MSOP-8EP]
S5  NC7SZ157  [SC70-6]
S6  NC7SZ157  [SC70-6]

### Nets
GND: C29.2 C30.2 C31.2 C32.2 C33.2 C34.2 C74.2 C75.2 S1.1(GND) S1.PAD(GND) S2.1(GND) S2.PAD(GND) S5.2(GND) S6.2(GND) ; also sheet 1,2,3,4,5,6,7,8,9,10,11,12,13,14,16,17,18
HUB_!OVRCUR1: R37.1 S2.5(!FLG) ; also sheet 12,18
HUB_!OVRCUR2: R36.1 S1.5(!FLG) ; also sheet 12,18
HUB_!PWRON1: S5.1(I1) ; also sheet 12,18
HUB_!PWRON2: S6.1(I1) ; also sheet 12,18
MOD0_5V_METERED: C33.1 S1.2(IN) S1.3(IN) ; also sheet 3,10,18
MOD0_ISO_USB: S6.6(S) ; also sheet 9,18
MOD0_USB_!EN: S1.4(!EN) S6.4(Z) ; also sheet 14
MOD0_USB_VBUS: C29.1 C74.1 S1.6(OUT) S1.7(OUT) ; also sheet 4,18
MOD1_5V_METERED: C34.1 S2.2(IN) S2.3(IN) ; also sheet 3,10,18
MOD1_ISO_USB: S5.6(S) ; also sheet 9,18
MOD1_USB_!EN: S2.4(!EN) S5.4(Z) ; also sheet 14
MOD1_USB_VBUS: C30.1 C75.1 S2.6(OUT) S2.7(OUT) ; also sheet 4,18
VCC_BACKPLANE: C31.1 C32.1 R36.2 R37.2 S5.3(I0) S5.5(VCC) S6.3(I0) S6.5(VCC) ; also sheet 1,3,7,9,10,11,12,14,17,18

### Notes on the sheet
- USB
- Power switches & Iso Power Override

## Sheet 16 of 18: Fake Radio Module
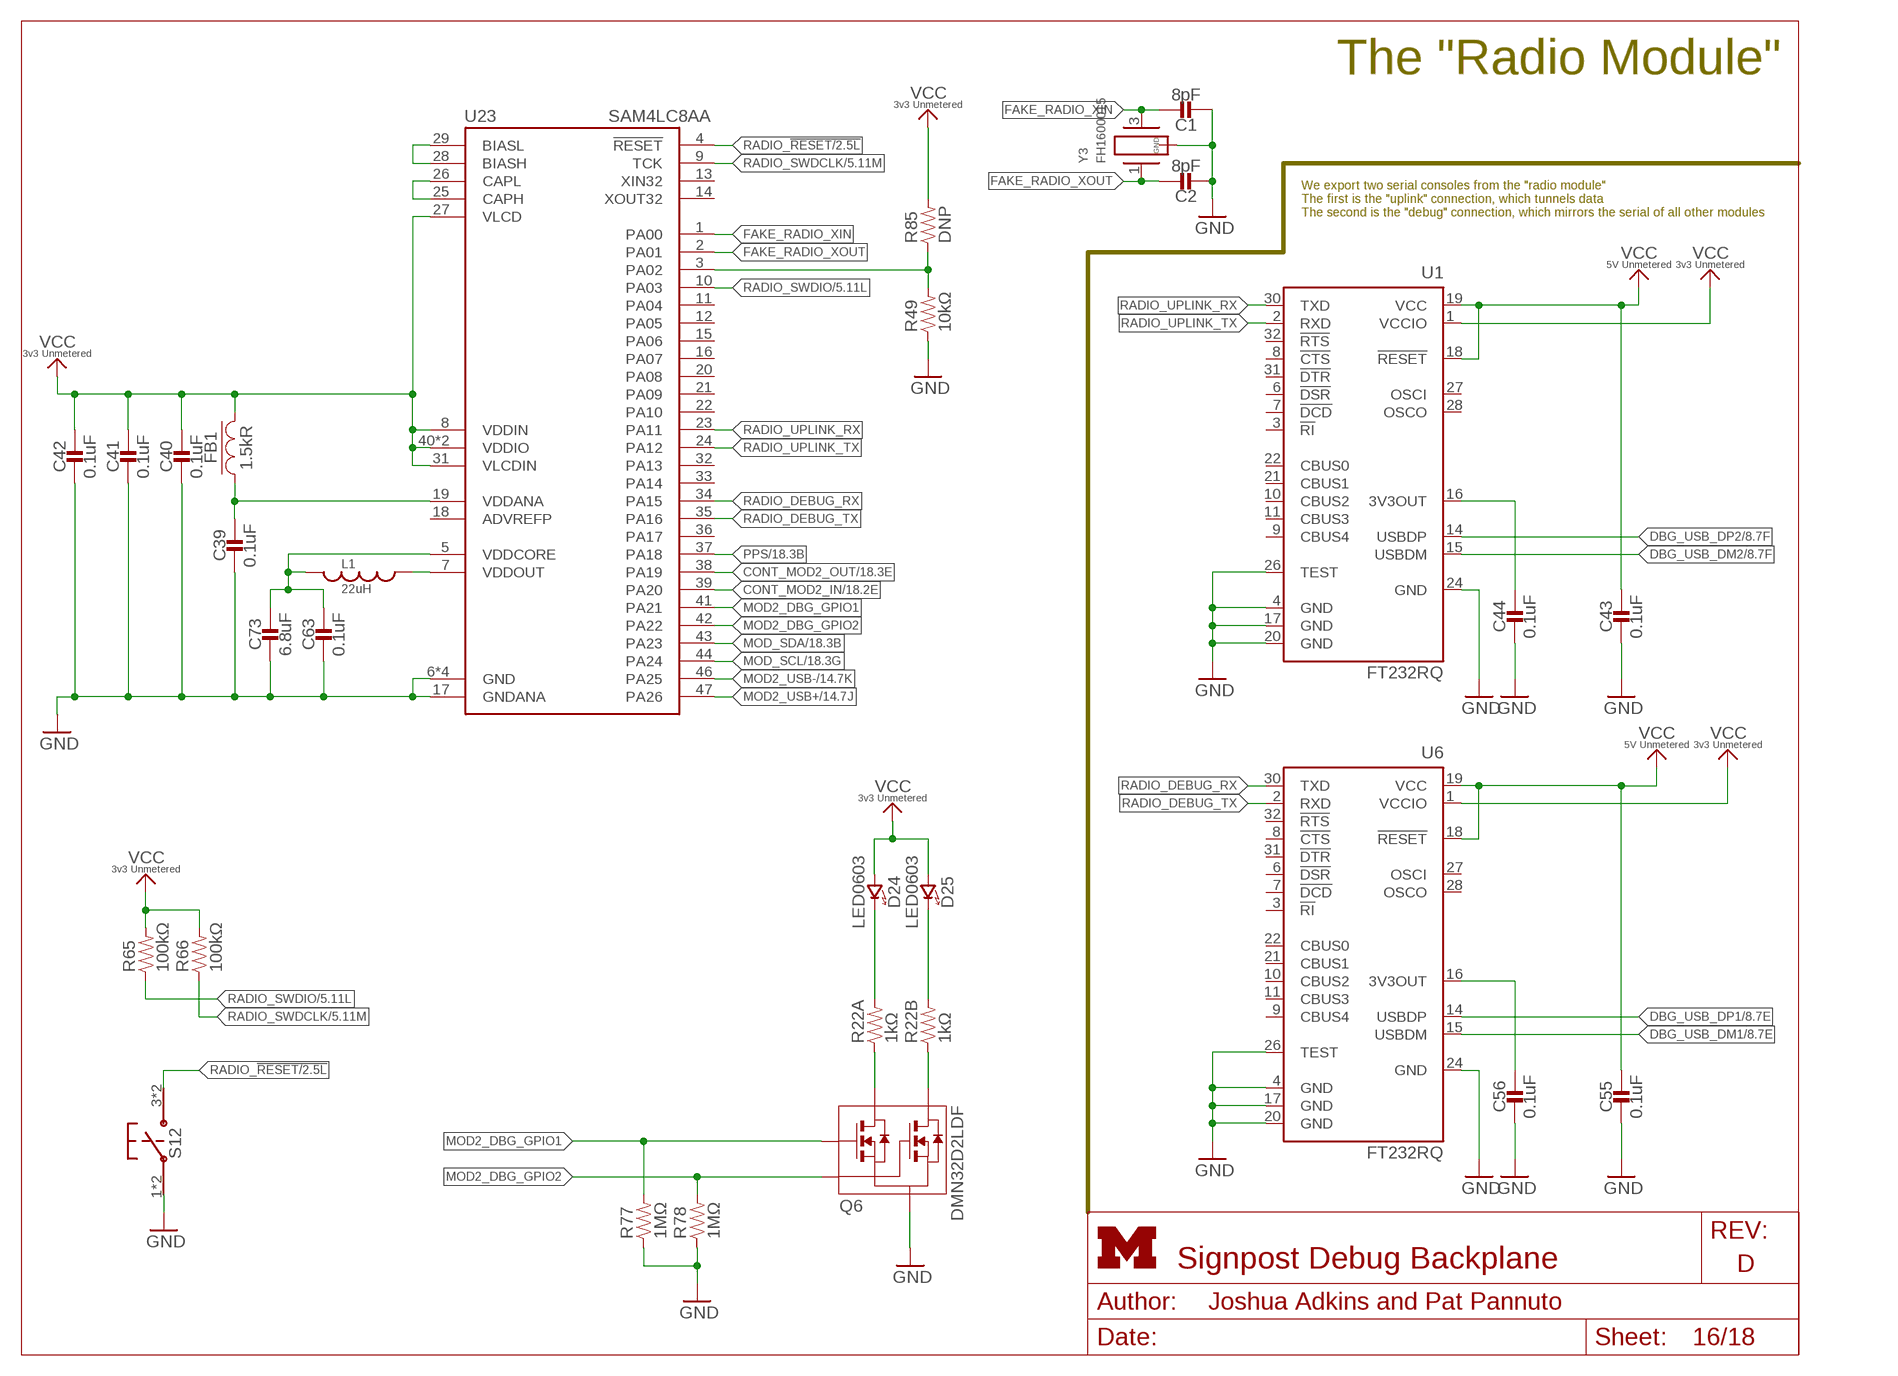
[diagram p15: schematic, sheet 16]
FRAME11 (LETTER_L_UMICH): HEIGHT: 8.5in; WIDTH: 11in

### Parts
C1  8pF  CAPACITOR0603_CAP  [0603_CAP]
C2  8pF  CAPACITOR0603_CAP  [0603_CAP]
C39  0.1uF  CAPACITOR0603_CAP  [0603_CAP]
C40  0.1uF  CAPACITOR0603_CAP  [0603_CAP]
C41  0.1uF  CAPACITOR0603_CAP  [0603_CAP]
C42  0.1uF  CAPACITOR0603_CAP  [0603_CAP]
C43  0.1uF  CAPACITOR0603_CAP  [0603_CAP]
C44  0.1uF  CAPACITOR0603_CAP  [0603_CAP]
C55  0.1uF  CAPACITOR0603_CAP  [0603_CAP]
C56  0.1uF  CAPACITOR0603_CAP  [0603_CAP]
C63  0.1uF  CAPACITOR0603_CAP  [0603_CAP]
C73  6.8uF  CAPACITOR0603_CAP  [0603_CAP]
D24  LED0603  [LED-0603]
D25  LED0603  [LED-0603]
FB1  1.5kR  FERRITE_BEAD0603  [0603_CAP]
L1  22uH  LHQ3NP  [1212]
Q6  DMN32D2LDF  [SOT353]
R49  10kΩ  RESISTOR0603_RES  [0603-RES]
R65  100kΩ  RESISTOR0603_RES  [0603-RES]
R66  100kΩ  RESISTOR0603_RES  [0603-RES]
R77  1MΩ  RESISTOR0603_RES  [0603-RES]
R78  1MΩ  RESISTOR0603_RES  [0603-RES]
R85  DNP  RESISTOR0603_RES  [0603-RES]
S12  PTS645SM43SMTR92  [PTS645]
U1  FT232RQ  [QFN32]
U6  FT232RQ  [QFN32]
U23  SAM4LC8AA  [QFN-48-7MM]
Y3  FH1600015  [FHXXX]

### Nets
3V3_UNMETERED: C40.1 C41.1 C42.1 D24.A(ANODE) D25.A(ANODE) FB1.2 R65.2 R66.2 R85.2 U1.1(VCCIO) U6.1(VCCIO) U23.8(VDDIN) U23.27(VLCD) U23.31(VLCDIN) U23.40(VDDIO) U23.45(VDDIO) ; supply symbol labelled VCC_3V3_UNMETERED ; also sheet 2,3,5,6,7,8,9,13,18
5V_UNMETERED: C43.1 C55.1 U1.18(!RESET) U1.19(VCC) U6.18(!RESET) U6.19(VCC) ; supply symbol labelled VCC_5V_UNMETERED ; also sheet 2,3,6,7,18
CONT_MOD2_IN: U23.39(PA20) ; also sheet 1,18
CONT_MOD2_OUT: U23.38(PA19) ; also sheet 1,18
CONTROLLER_BUCK/LDO_N: R49.2 R85.1 U23.3(PA02)
DBG_USB_DM1: U6.15(USBDM) ; also sheet 8
DBG_USB_DM2: U1.15(USBDM) ; also sheet 8
DBG_USB_DP1: U6.14(USBDP) ; also sheet 8
DBG_USB_DP2: U1.14(USBDP) ; also sheet 8
FAKE_RADIO_XIN: C1.1 U23.1(PA00) Y3.3
FAKE_RADIO_XOUT: C2.1 U23.2(PA01) Y3.1
GND: C1.2 C2.2 C39.2 C40.2 C41.2 C42.2 C43.2 C44.2 C55.2 C56.2 C63.2 C73.2 Q6.S R49.1 R77.1 R78.1 S12.1 S12.2 U1.4(GND) U1.17(GND) U1.20(GND) U1.24(GND) U1.26(TEST) U6.4(GND) U6.17(GND) U6.20(GND) U6.24(GND) U6.26(TEST) U23.6(GND) U23.17(GNDANA) U23.30(GND) U23.48(GND) U23.THERMAL(GND) Y3.2(GND) Y3.4(GND) ; also sheet 1,2,3,4,5,6,7,8,9,10,11,12,13,14,15,17,18
MOD2_DBG_GPIO1: Q6.G1 R77.2 U23.41(PA21)
MOD2_DBG_GPIO2: Q6.G2 R78.2 U23.42(PA22)
MOD2_USB+: U23.47(PA26) ; also sheet 14
MOD2_USB-: U23.46(PA25) ; also sheet 14
MOD_SCL: U23.44(PA24) ; also sheet 1,10,18
MOD_SDA: U23.43(PA23) ; also sheet 1,10,18
N$21: C56.1 U6.16(3V3OUT)
N$38: C39.1 FB1.1 U23.19(VDDANA)
N$40: U23.28(BIASH) U23.29(BIASL)
N$41: U23.25(CAPH) U23.26(CAPL)
N$46: D24.C(CATHODE) R22.A2
N$48: D25.C(CATHODE) R22.B2
N$49: C44.1 U1.16(3V3OUT)
N$58: Q6.D1 R22.A1
N$59: Q6.D2 R22.B1
PPS: U23.37(PA18) ; also sheet 1,11,18
RADIO_!RESET: S12.3 S12.4 U23.4(!RESET) ; also sheet 2,5
RADIO_DEBUG_RX: U6.30(TXD) U23.34(PA15)
RADIO_DEBUG_TX: U6.2(RXD) U23.35(PA16)
RADIO_SWDCLK: R66.1 U23.9(TCK) ; also sheet 5
RADIO_SWDIO: R65.1 U23.10(PA03) ; also sheet 5
RADIO_UPLINK_RX: U1.30(TXD) U23.23(PA11)
RADIO_UPLINK_TX: U1.2(RXD) U23.24(PA12)
RADIO_VDDCORE: C63.1 C73.1 L1.P$2 U23.5(VDDCORE)
RADIO_VDDOUT: L1.P$1 U23.7(VDDOUT)
Unconnected: U1.3(!RI) U1.6(!DSR) U1.7(!DCD) U1.8(!CTS) U1.9(CBUS4) U1.10(CBUS2) U1.11(CBUS3) U1.21(CBUS1) U1.22(CBUS0) U1.27(OSCI) U1.28(OSCO) U1.31(!DTR) U1.32(!RTS) U6.3(!RI) U6.6(!DSR) U6.7(!DCD) U6.8(!CTS) U6.9(CBUS4) U6.10(CBUS2) U6.11(CBUS3) U6.21(CBUS1) U6.22(CBUS0) U6.27(OSCI) U6.28(OSCO) U6.31(!DTR) U6.32(!RTS) U23.11(PA04) U23.12(PA05) U23.13(XIN32) U23.14(XOUT32) U23.15(PA06) U23.16(PA07) U23.18(ADVREFP) U23.20(PA08) U23.21(PA09) U23.22(PA10) U23.32(PA13) U23.33(PA14) U23.36(PA17)

### Notes on the sheet
- The "Radio Module"
- We export two serial consoles from the "radio module"
  The first is the "uplink" connection, which tunnels data
  The second is the "debug" connection, which mirrors the serial of all other modules

## Sheet 17 of 18: ID EEPROM
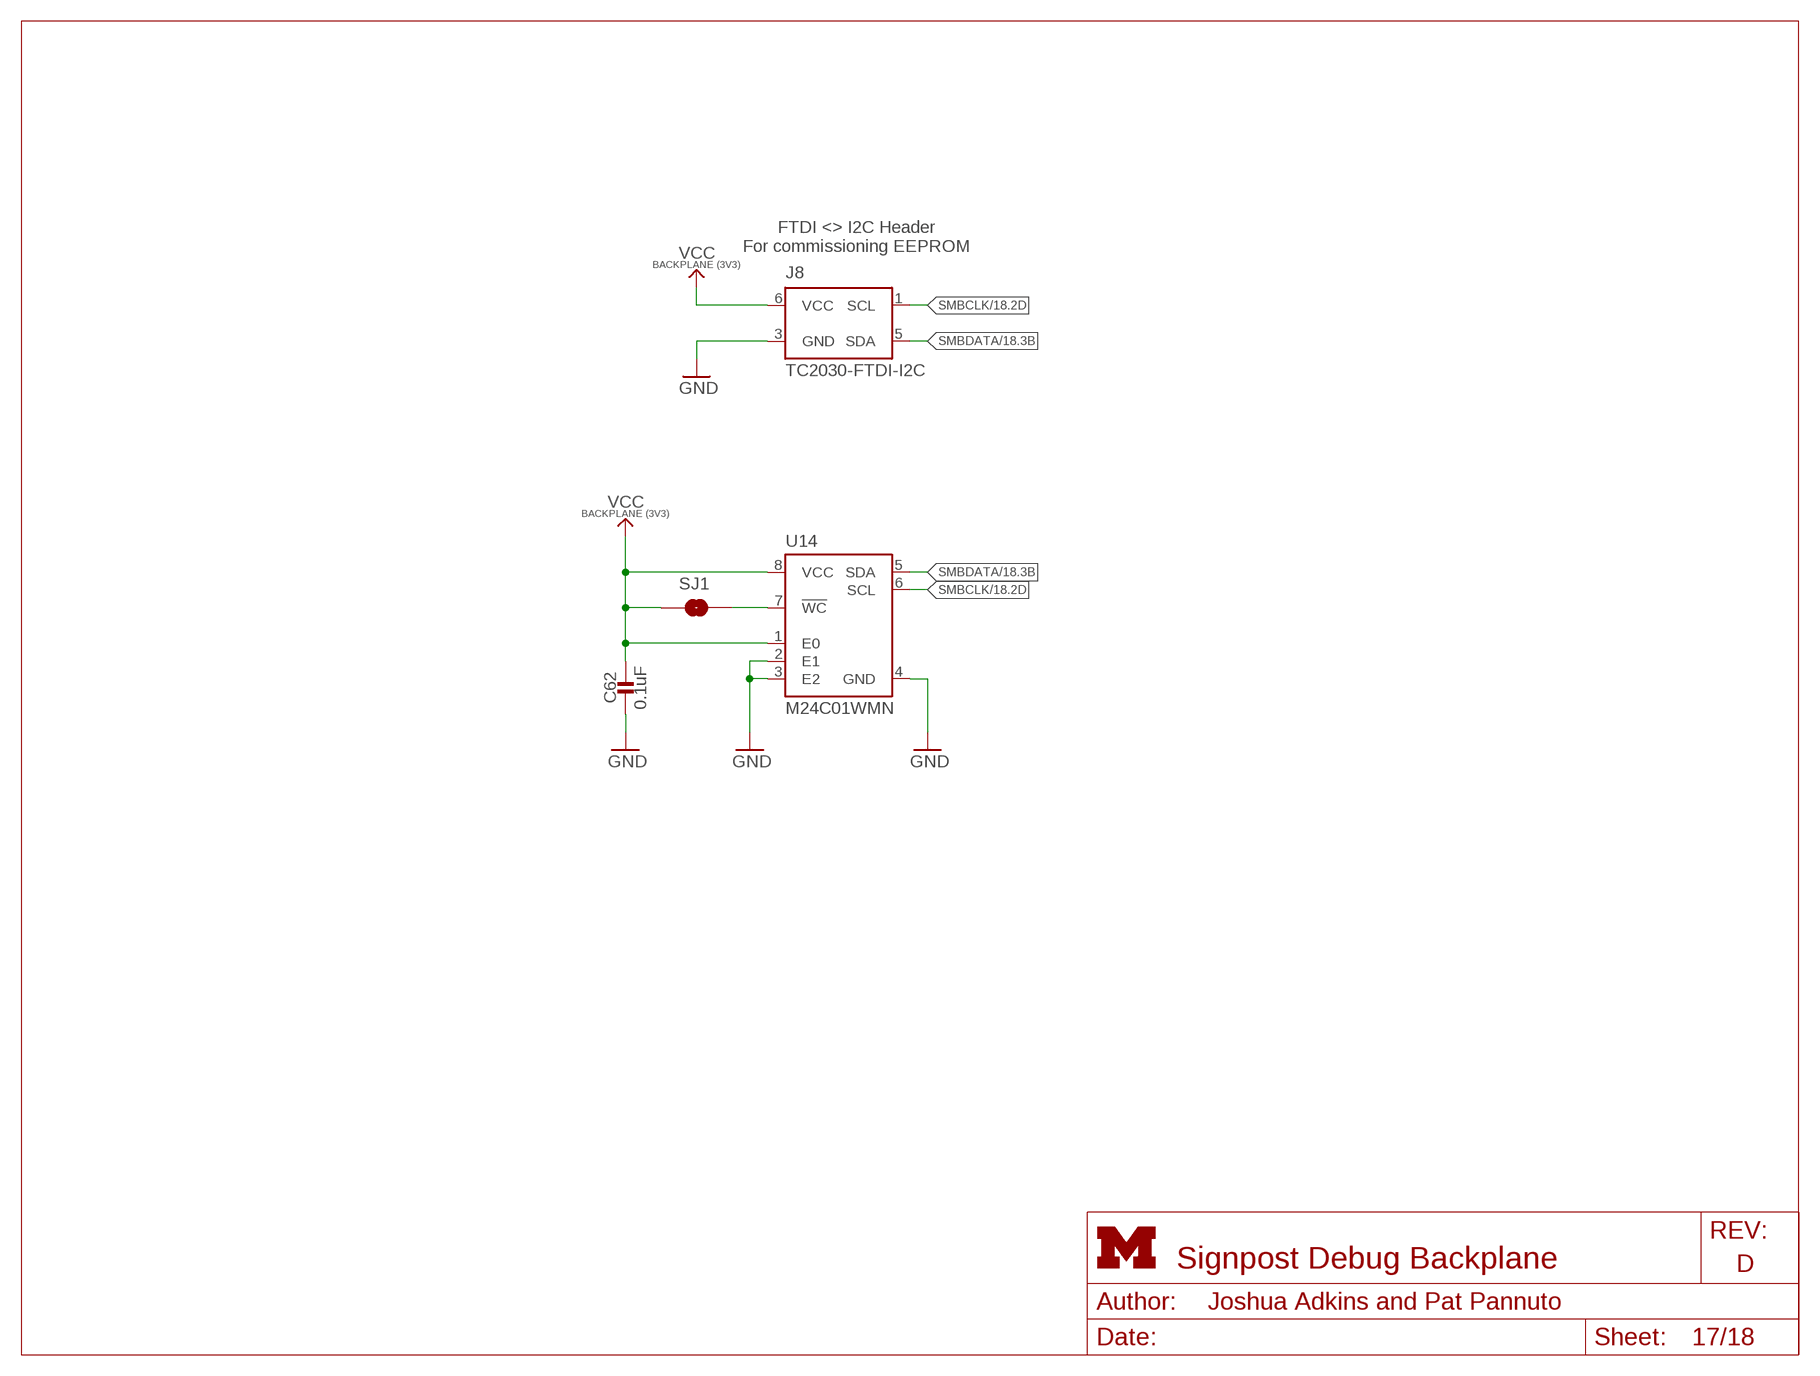
[diagram p16: schematic, sheet 17]
FRAME17 (LETTER_L_UMICH): HEIGHT: 8.5in; WIDTH: 11in

### Parts
C62  0.1uF  CAPACITOR0603_CAP  [0603_CAP]
J8  TC2030-FTDI-I2C  [TC2030-IDC-NL]
SJ1  SOLDERJUMPERNO  [SJ_2S-NO]
U14  M24C01WMN  [SOIC-8]

### Nets
GND: C62.2 J8.3(GND) U14.2(E1) U14.3(E2) U14.4(GND) ; also sheet 1,2,3,4,5,6,7,8,9,10,11,12,13,14,15,16,18
N$45: SJ1.2 U14.7(!WC)
SMBCLK: J8.1(SCL) U14.6(SCL) ; also sheet 1,3,9,12,18
SMBDATA: J8.5(SDA) U14.5(SDA) ; also sheet 1,3,9,12,18
VCC_BACKPLANE: C62.1 J8.6(VCC) SJ1.1 U14.1(E0) U14.8(VCC) ; also sheet 1,3,7,9,10,11,12,14,15,18

### Notes on the sheet
- FTDI <> I2C Header
  For commissioning EEPROM

## Sheet 18 of 18: Debugging Headers
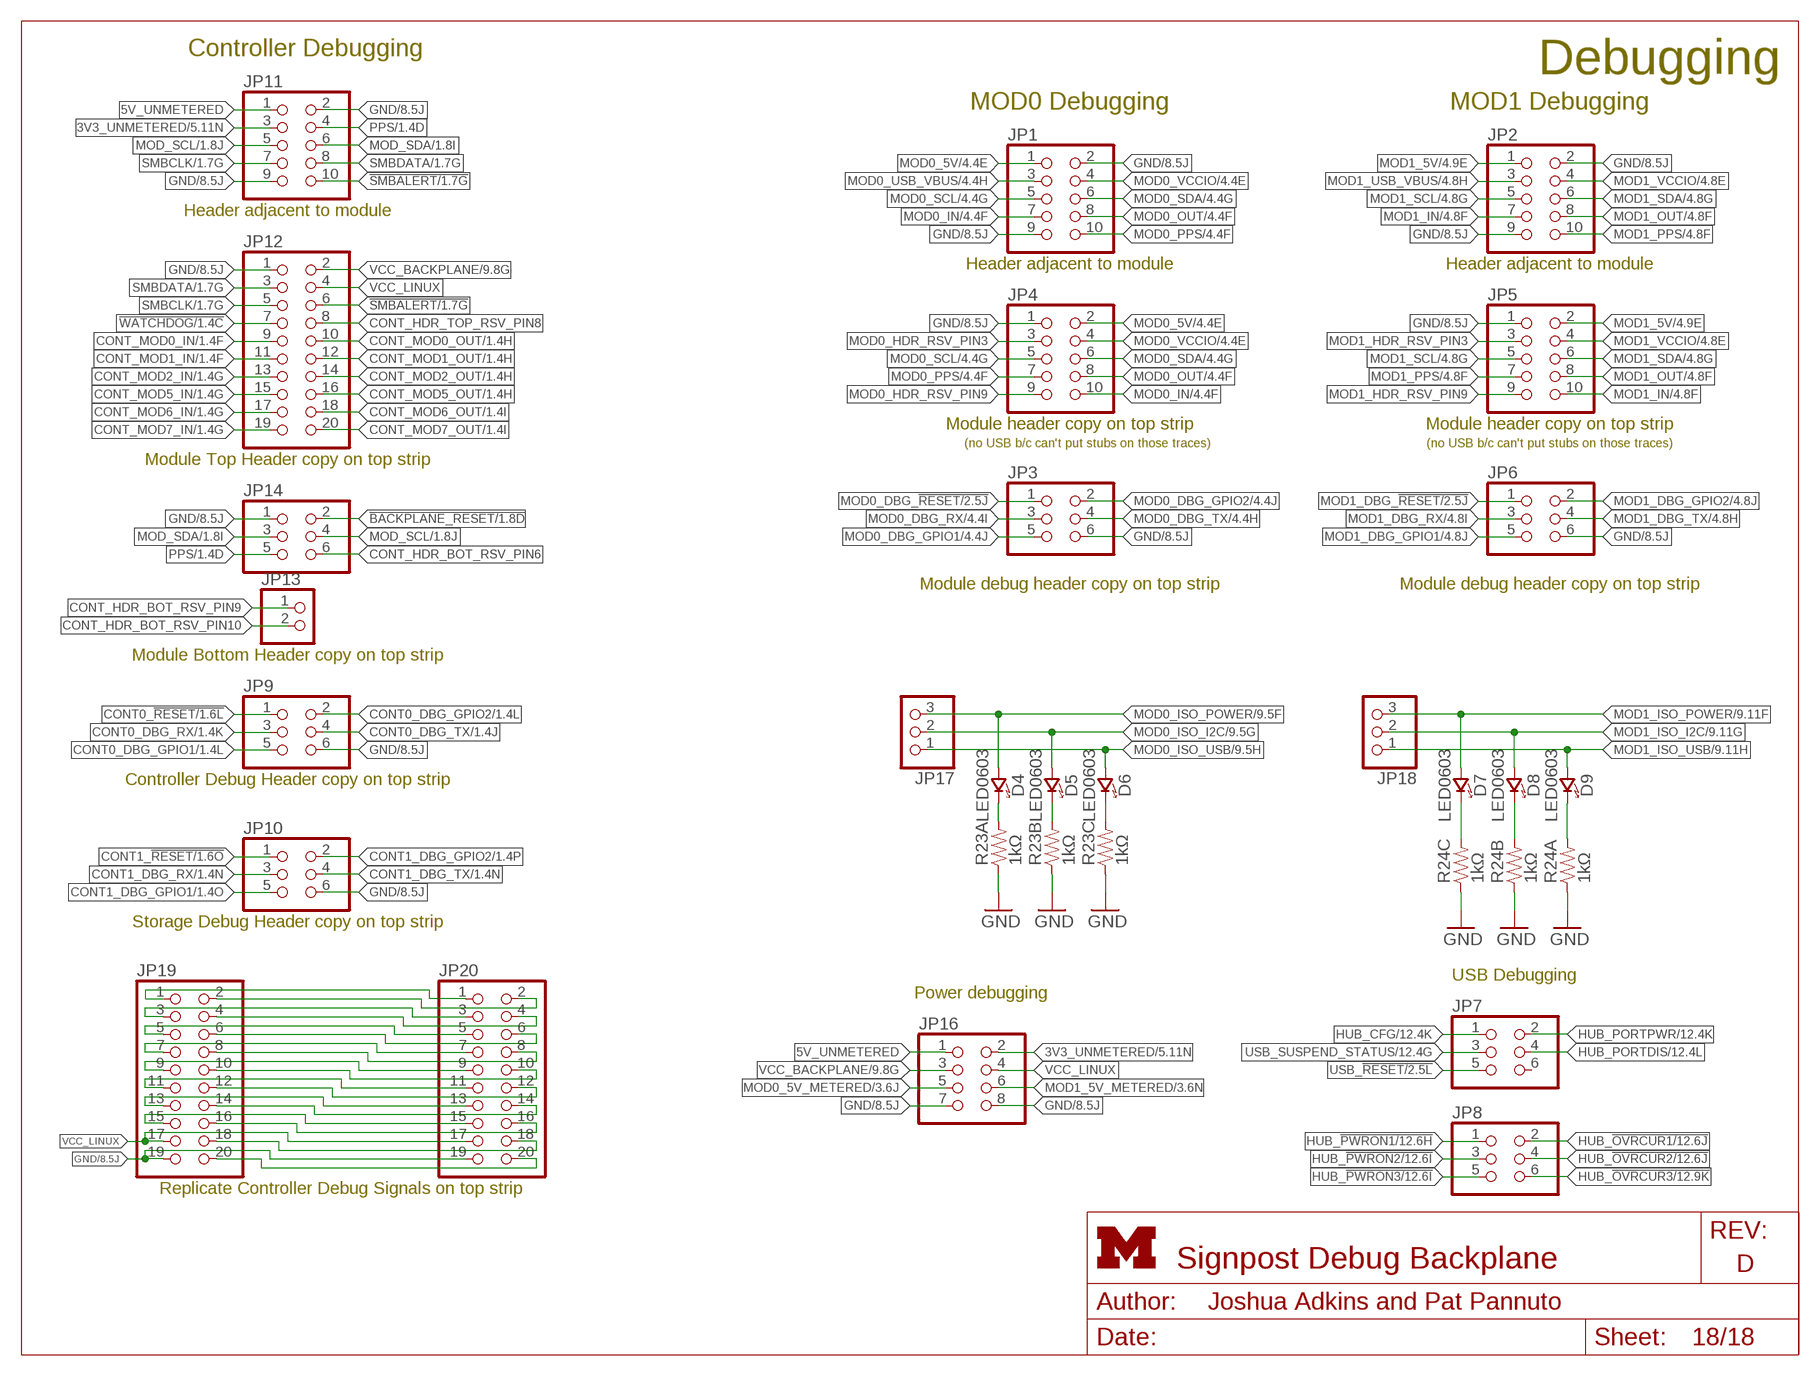
[diagram p17: schematic, sheet 18]
FRAME9 (LETTER_L_UMICH): HEIGHT: 8.5in; WIDTH: 11in

### Parts
D4  LED0603  [LED-0603]
D5  LED0603  [LED-0603]
D6  LED0603  [LED-0603]
D7  LED0603  [LED-0603]
D8  LED0603  [LED-0603]
D9  LED0603  [LED-0603]
JP1  PINHD-2X5  [2X05]
JP2  PINHD-2X5  [2X05]
JP3  PINHD-2X3  [2X03]
JP4  PINHD-2X5  [2X05]
JP5  PINHD-2X5  [2X05]
JP6  PINHD-2X3  [2X03]
JP7  PINHD-2X3  [2X03]
JP8  PINHD-2X3  [2X03]
JP9  PINHD-2X3  [2X03]
JP10  PINHD-2X3  [2X03]
JP11  PINHD-2X5  [2X05]
JP12  PINHD-2X10  [2X10]
JP13  PINHD-1X2  [1X02]
JP14  PINHD-2X3  [2X03]
JP16  PINHD-2X4  [2X04]
JP17  PINHD-1X3  [1X03]
JP18  PINHD-1X3  [1X03]
JP19  PINHD-2X10  [2X10]
JP20  PINHD-2X10  [2X10]
R23  1kΩ  RESISTOR-ARRAY-41206  [ARRAY-CONVEX-0603-4]
R24  1kΩ  RESISTOR-ARRAY-41206  [ARRAY-CONVEX-0603-4]

### Nets
3V3_UNMETERED: JP11.3 JP16.2 ; also sheet 2,3,5,6,7,8,9,13,16
5V_UNMETERED: JP11.1 JP16.1 ; also sheet 2,3,6,7,16
!BACKPLANE_RESET: JP14.2 ; also sheet 1,2,9,12
!SMBALERT: JP11.10 JP12.6 ; also sheet 1,3
!WATCHDOG: JP12.7 ; also sheet 1,2
CONT0_!RESET: JP9.1 ; also sheet 1,2,5
CONT0_DBG_GPIO1: JP9.5 ; also sheet 1,7
CONT0_DBG_GPIO2: JP9.2 ; also sheet 1,7
CONT0_DBG_RX: JP9.3 ; also sheet 1,7
CONT0_DBG_TX: JP9.4 ; also sheet 1,7
CONT1_!RESET: JP10.1 ; also sheet 1,2,5
CONT1_DBG_GPIO1: JP10.5 ; also sheet 1,7
CONT1_DBG_GPIO2: JP10.2 ; also sheet 1,7
CONT1_DBG_RX: JP10.3 ; also sheet 1,7
CONT1_DBG_TX: JP10.4 ; also sheet 1,7
CONT_DBG_PIN1: JP19.1 JP20.1
CONT_DBG_PIN2: JP19.2 JP20.2
CONT_DBG_PIN3: JP19.3 JP20.3
CONT_DBG_PIN4: JP19.4 JP20.4
CONT_DBG_PIN5: JP19.5 JP20.5
CONT_DBG_PIN6: JP19.6 JP20.6
CONT_DBG_PIN7: JP19.7 JP20.7
CONT_DBG_PIN8: JP19.8 JP20.8
CONT_DBG_PIN9: JP19.9 JP20.9
CONT_DBG_PIN10: JP19.10 JP20.10
CONT_DBG_PIN11: JP19.11 JP20.11
CONT_DBG_PIN12: JP19.12 JP20.12
CONT_DBG_PIN13: JP19.13 JP20.13
CONT_DBG_PIN14: JP19.14 JP20.14
CONT_DBG_PIN15: JP19.15 JP20.15
CONT_DBG_PIN16: JP19.16 JP20.16
CONT_DBG_PIN18: JP19.18 JP20.18
CONT_DBG_PIN20: JP19.20 JP20.20
CONT_HDR_BOT_RSV_PIN6: JP14.6
CONT_HDR_BOT_RSV_PIN9: JP13.1
CONT_HDR_BOT_RSV_PIN10: JP13.2
CONT_HDR_TOP_RSV_PIN8: JP12.8
CONT_MOD0_IN: JP12.9 ; also sheet 1,11
CONT_MOD0_OUT: JP12.10 ; also sheet 1,11
CONT_MOD1_IN: JP12.11 ; also sheet 1,11
CONT_MOD1_OUT: JP12.12 ; also sheet 1,11
CONT_MOD2_IN: JP12.13 ; also sheet 1,16
CONT_MOD2_OUT: JP12.14 ; also sheet 1,16
CONT_MOD5_IN: JP12.15 ; also sheet 1
CONT_MOD5_OUT: JP12.16 ; also sheet 1
CONT_MOD6_IN: JP12.17 ; also sheet 1
CONT_MOD6_OUT: JP12.18 ; also sheet 1
CONT_MOD7_IN: JP12.19 ; also sheet 1
CONT_MOD7_OUT: JP12.20 ; also sheet 1
GND: JP1.2 JP1.9 JP2.2 JP2.9 JP3.6 JP4.1 JP5.1 JP6.6 JP9.6 JP10.6 JP11.2 JP11.9 JP12.1 JP14.1 JP16.7 JP16.8 JP19.19 JP20.19 R23.A1 R23.B1 R23.C1 R24.A1 R24.B1 R24.C1 ; also sheet 1,2,3,4,5,6,7,8,9,10,11,12,13,14,15,16,17
HUB_!OVRCUR1: JP8.2 ; also sheet 12,15
HUB_!OVRCUR2: JP8.4 ; also sheet 12,15
HUB_!OVRCUR3: JP8.6 ; also sheet 12
HUB_!PWRON1: JP8.1 ; also sheet 12,15
HUB_!PWRON2: JP8.3 ; also sheet 12,15
HUB_!PWRON3: JP8.5 ; also sheet 12
HUB_CFG: JP7.1 ; also sheet 12
HUB_PORTDIS: JP7.4 ; also sheet 12
HUB_PORTPWR: JP7.2 ; also sheet 12
MOD0_5V: JP1.1 JP4.2 ; also sheet 4,10
MOD0_5V_METERED: JP16.5 ; also sheet 3,10,15
MOD0_DBG_!RESET: JP3.1 ; also sheet 2,4,5
MOD0_DBG_GPIO1: JP3.5 ; also sheet 4,6
MOD0_DBG_GPIO2: JP3.2 ; also sheet 4,6
MOD0_DBG_RX: JP3.3 ; also sheet 4,6
MOD0_DBG_TX: JP3.4 ; also sheet 4,6
MOD0_HDR_RSV_PIN3: JP4.3
MOD0_HDR_RSV_PIN9: JP4.9
MOD0_IN: JP1.7 JP4.10 ; also sheet 4,11
MOD0_ISO_I2C: D5.A(ANODE) JP17.2 ; also sheet 9,10
MOD0_ISO_POWER: D4.A(ANODE) JP17.3 ; also sheet 9,10
MOD0_ISO_USB: D6.A(ANODE) JP17.1 ; also sheet 9,15
MOD0_OUT: JP1.8 JP4.8 ; also sheet 4,11
MOD0_PPS: JP1.10 JP4.7 ; also sheet 4,11
MOD0_SCL: JP1.5 JP4.5 ; also sheet 4,10
MOD0_SDA: JP1.6 JP4.6 ; also sheet 4,10
MOD0_USB_VBUS: JP1.3 ; also sheet 4,15
MOD0_VCCIO: JP1.4 JP4.4 ; also sheet 4,5,6,10,11
MOD1_5V: JP2.1 JP5.2 ; also sheet 4,10
MOD1_5V_METERED: JP16.6 ; also sheet 3,10,15
MOD1_DBG_!RESET: JP6.1 ; also sheet 2,4,5
MOD1_DBG_GPIO1: JP6.5 ; also sheet 4,6
MOD1_DBG_GPIO2: JP6.2 ; also sheet 4,6
MOD1_DBG_RX: JP6.3 ; also sheet 4,6
MOD1_DBG_TX: JP6.4 ; also sheet 4,6
MOD1_HDR_RSV_PIN3: JP5.3
MOD1_HDR_RSV_PIN9: JP5.9
MOD1_IN: JP2.7 JP5.10 ; also sheet 4,11
MOD1_ISO_I2C: D8.A(ANODE) JP18.2 ; also sheet 9,10
MOD1_ISO_POWER: D7.A(ANODE) JP18.3 ; also sheet 9,10
MOD1_ISO_USB: D9.A(ANODE) JP18.1 ; also sheet 9,15
MOD1_OUT: JP2.8 JP5.8 ; also sheet 4,11
MOD1_PPS: JP2.10 JP5.7 ; also sheet 4,11
MOD1_SCL: JP2.5 JP5.5 ; also sheet 4,10
MOD1_SDA: JP2.6 JP5.6 ; also sheet 4,10
MOD1_USB_VBUS: JP2.3 ; also sheet 4,15
MOD1_VCCIO: JP2.4 JP5.4 ; also sheet 4,5,6,10,11
MOD_SCL: JP11.5 JP14.4 ; also sheet 1,10,16
MOD_SDA: JP11.6 JP14.3 ; also sheet 1,10,16
N$1: D4.C(CATHODE) R23.A2
N$2: D5.C(CATHODE) R23.B2
N$3: D6.C(CATHODE) R23.C2
N$10: D7.C(CATHODE) R24.C2
N$11: D9.C(CATHODE) R24.A2
N$13: D8.C(CATHODE) R24.B2
PPS: JP11.4 JP14.5 ; also sheet 1,11,16
SMBCLK: JP11.7 JP12.5 ; also sheet 1,3,9,12,17
SMBDATA: JP11.8 JP12.3 ; also sheet 1,3,9,12,17
USB_!RESET: JP7.5 ; also sheet 2,12
USB_SUSPEND_STATUS: JP7.3 ; also sheet 12
VCC_BACKPLANE: JP12.2 JP16.3 ; also sheet 1,3,7,9,10,11,12,14,15,17
VCC_LINUX: JP12.4 JP16.4 JP19.17 JP20.17 ; also sheet 1,3
Unconnected: JP7.6 R23.D1 R23.D2 R24.D1 R24.D2

### Notes on the sheet
- Debugging
- Controller Debugging
- MOD0 Debugging | MOD1 Debugging
- Header adjacent to module
- Header adjacent to module | Header adjacent to module
- Module header copy on top strip | Module header copy on top strip
- (no USB b/c can't put stubs on those traces) | (no USB b/c can't put stubs on those traces)
- Module Top Header copy on top strip
- Module debug header copy on top strip | Module debug header copy on top strip
- Module Bottom Header copy on top strip
- Controller Debug Header copy on top strip
- Storage Debug Header copy on top strip
- USB Debugging
- Power debugging
- Replicate Controller Debug Signals on top strip